# EAGLE schematic mainboard_10_1_Feb_2022,_200341 (EAGLE 9.6.2)
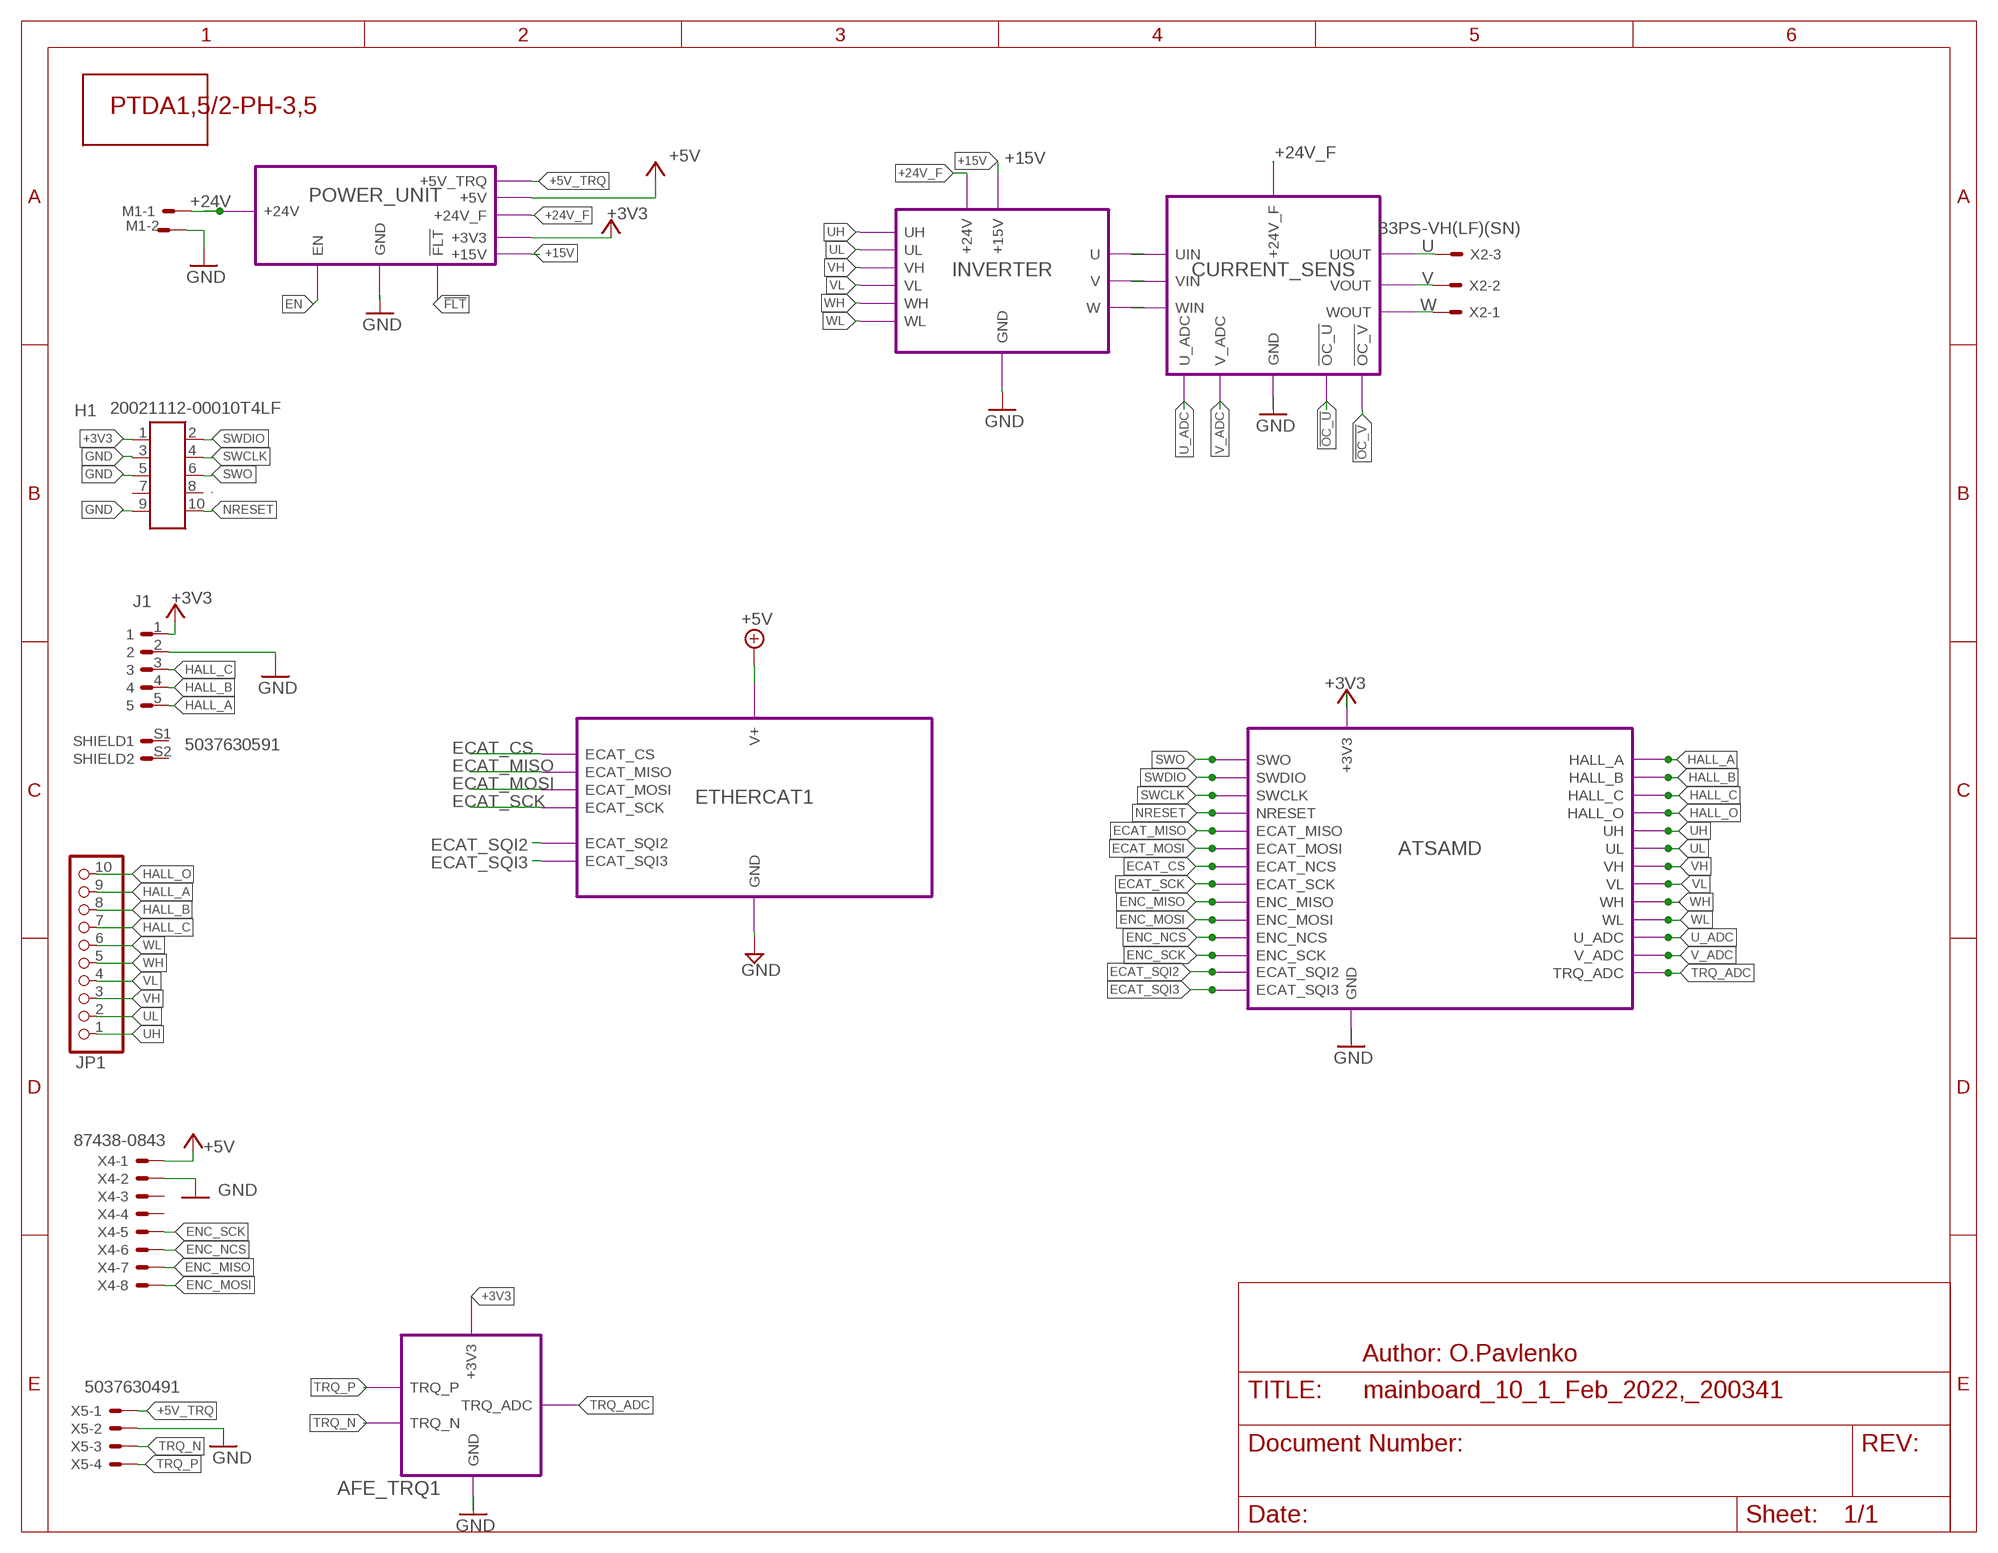
[diagram p0: schematic, sheet 1]

## Parts
H1  20021112-00010T4LF  [20021112-00010]
J1  5037630591  [MOLEX_5037630591]
JP1  PINHD-1X10  [1X10]
M1  PST1,3/2-3,5  [1945096]
U$1  PTDA1,5/2-PH-3,5  [1725107]
X2  B3PS-VH(LF)(SN)  [B3PS-VH(LF)(SN)]
X4  87438-0843  [87438-08]
X5  5037630491  [5037630491]

## Module instances
POWER_UNIT = POWERUNIT
INVERTER = INVERTER
CURRENT_SENS = CURRENT_MEAS
ATSAMD = ATSAME
AFE_TRQ1 = AFE_TRQ
ETHERCAT1 = ETHERCAT

## Nets
!FLT!: port POWER_UNIT.!FLT!
!OC_U!: port CURRENT_SENS.!OC_U!
!OC_V!: port CURRENT_SENS.!OC_V!
+3V3: H1.1 J1.1 ; port POWER_UNIT.+3V3 ATSAMD.+3V3 AFE_TRQ1.+3V3
+5V: X4.1 ; port POWER_UNIT.+5V ETHERCAT1.V+
+5V_TRQ: X5.1 ; port POWER_UNIT.+5V_TRQ
+15V: port INVERTER.+15V POWER_UNIT.+15V
+24V: M1.1 ; port POWER_UNIT.+24V
+24V_F: port POWER_UNIT.+24V_F INVERTER.+24V CURRENT_SENS.+24V_F
ECAT_CS: port ATSAMD.ECAT_NCS ETHERCAT1.ECAT_CS
ECAT_MISO: port ATSAMD.ECAT_MISO ETHERCAT1.ECAT_MISO
ECAT_MOSI: port ATSAMD.ECAT_MOSI ETHERCAT1.ECAT_MOSI
ECAT_SCK: port ATSAMD.ECAT_SCK ETHERCAT1.ECAT_SCK
ECAT_SQI2: port ATSAMD.ECAT_SQI2 ETHERCAT1.ECAT_SQI2
ECAT_SQI3: port ATSAMD.ECAT_SQI3 ETHERCAT1.ECAT_SQI3
EN: port POWER_UNIT.EN
ENC_MISO: X4.7 ; port ATSAMD.ENC_MISO
ENC_MOSI: X4.8 ; port ATSAMD.ENC_MOSI
ENC_NCS: X4.6 ; port ATSAMD.ENC_NCS
ENC_SCK: X4.5 ; port ATSAMD.ENC_SCK
GND: H1.3 H1.5 H1.9 J1.2 M1.2 X4.2 X5.2 ; port POWER_UNIT.GND INVERTER.GND CURRENT_SENS.GND AFE_TRQ1.GND ATSAMD.GND ETHERCAT1.GND
HALL_A: J1.5 JP1.9 ; port ATSAMD.HALL_A
HALL_B: J1.4 JP1.8 ; port ATSAMD.HALL_B
HALL_C: J1.3 JP1.7 ; port ATSAMD.HALL_C
HALL_O: JP1.10 ; port ATSAMD.HALL_O
N$1: port INVERTER.U CURRENT_SENS.UIN
N$2: port INVERTER.V CURRENT_SENS.VIN
N$3: port INVERTER.W CURRENT_SENS.WIN
NRESET: H1.10 ; port ATSAMD.NRESET
SWCLK: H1.4 ; port ATSAMD.SWCLK
SWDIO: H1.2 ; port ATSAMD.SWDIO
SWO: H1.6 ; port ATSAMD.SWO
TRQ_ADC: port AFE_TRQ1.TRQ_ADC ATSAMD.TRQ_ADC
TRQ_N: X5.3 ; port AFE_TRQ1.TRQ_N
TRQ_P: X5.4 ; port AFE_TRQ1.TRQ_P
U: X2.1 ; port CURRENT_SENS.UOUT
U_ADC: port CURRENT_SENS.U_ADC ATSAMD.U_ADC
UH: JP1.1 ; port INVERTER.UH ATSAMD.UH
UL: JP1.2 ; port INVERTER.UL ATSAMD.UL
V: X2.2 ; port CURRENT_SENS.VOUT
V_ADC: port CURRENT_SENS.V_ADC ATSAMD.V_ADC
VH: JP1.3 ; port INVERTER.VH ATSAMD.VH
VL: JP1.4 ; port INVERTER.VL ATSAMD.VL
W: X2.3 ; port CURRENT_SENS.WOUT
WH: JP1.5 ; port INVERTER.WH ATSAMD.WH
WL: JP1.6 ; port INVERTER.WL ATSAMD.WL
Unconnected: H1.7 H1.8 J1.S1(SHIELD1) J1.S2(SHIELD2) X4.3 X4.4

## Notes on the sheet
- Author: O.Pavlenko

## Library data of the parts
H1 = msrm:20021?10*LF: Connector Header Surface Mount 10 position 0.050" (1.27mm) Variant: 111-000 609-5923-ND ___ Source: Digikey <https://www.digikey.de/products/de?keywords=609-5923-ND> ; Datasheet <https://cdn.amphenol-icc.com/media/wysiwyg/files/drawing/20021111.pdf> 609-3712-ND ___ Source: Digikey <https://www.digikey.de/products/de?keywords=609-3712-ND> ; Datasheet <https://media.digikey.com/pdf/Data%20Sheets/FCI%20PDFs/Minitek%20127_Catalog.pdf> Variant: 112-000 609-5926-ND ___ Source: Digikey <https://www.digikey.de/products/de?keywords=609-5926-ND> ; Datasheet <https://cdn.amphenol-icc.com/media/wysiwyg/files/drawing/20021112.pdf> Variant: 121-000 609-3695-1-ND ___ Source: Digikey <https://www.digikey.de/products/de?keywords=609-3695-1-ND> ; Datasheet <https://cdn.amphenol-icc.com/media/wysiwyg/files/drawing/20021121.pdf> 609-6529-ND ___ Source: Digikey <https://www.digikey.de/products/de?keywords=609-6529-ND> ; Datasheet <https://cdn.amphenol-icc.com/media/wysiwyg/files/drawing/20021121.pdf> 609-3729-ND ___ Source: Digikey <https://www.digikey.de/products/de?keywords=609-3729-ND> ; Datasheet <https://cdn.amphenol-icc.com/media/wysiwyg/files/drawing/20021121.pdf> Variant: 311-000 609-3754-ND ___ Source: Digikey <https://www.digikey.de/products/de?keywords=609-3754-ND> ; Datasheet <https://cdn.amphenol-icc.com/media/wysiwyg/files/drawing/20021311.pdf>; DIGIKEY: 609-5926-ND; PINS: 10
J1 = IMDL_lib:5037630591: Check availability <https://pricing.snapeda.com/parts/5037630591/Molex/view-part?ref=eda>; AVAILABILITY: In Stock; DESCRIPTION: Connector Header Surface Mount, Right Angle 5 position 0.039 (1.00mm); MF: Molex; MP: 5037630591; PACKAGE: None; PRICE: None; PURCHASE-URL: https://pricing.snapeda.com/search/part/5037630591/?ref=eda
JP1 = pinhead:PINHD-1X10: PIN HEADER
M1 = msrm:PST*/2-?: 2 Position Terminal Block Header, Male Pins, Unshrouded 0.138" (3.50mm) Vertical Through Hole 277-1749-ND ___ Source: Digikey <https://www.digikey.de/products/en?keywords=277-1749-ND> ; Datasheet <https://media.digikey.com/pdf/Data%20Sheets/Phoenix%20Contact%20PDFs/Combicon%20Compact%20Series.pdf>; DIGIKEY: 277-1749-ND; PITCH: 3,5
U$1 = msrm:PTDA*/2-PH: 2 Position Terminal Block Plug for Unshrouded Header 0.138" (3.50mm) 45° Free Hanging (In-Line) 277-17182-ND ___ Source: Digikey <https://www.digikey.de/products/en?keywords=277-17182-ND> ; Datasheet <https://media.digikey.com/PDF/Data%20Sheets/Phoenix%20Contact%20PDFs/1725107.pdf>; DIGIKEY: 277-17182-ND
X2 = msrm:B3PS-VH(LF)(SN): Connector Header Through Hole, Right Angle 3 position 0.156" (3.96mm) 455-1649 ___ Source: Digikey <https://www.digikey.de/product-detail/en/jst-sales-america-inc/B3PS-VH-LF-SN/455-1649-ND/926556> ; Datasheet <http://www.jst-mfg.com/product/pdf/eng/eVH.pdf>; DIGIKEY: 455-1649-ND
X4 = msrm:8743?-08*3: Wire-to-Board 1.50mm (.059") Pitch Header - SMT, Shrouded Source: http://www.molex.com/product/micro/87437.html; DIGIKEY: WM7652CT-ND
X5 = msrm:5037630491: Pico-Lock 503763 Connector Header Surface Mount, Right Angle 4 position 0.039" (1.00mm); DIGIKEY: WM10655CT-ND

## Module POWERUNIT
Ports: +24V(pwr) GND(pwr) +5V(pwr) +3V3(pwr) EN(out) !FLT!(out) +24V_F(pwr) +15V(pwr) +5V_TRQ(pwr)
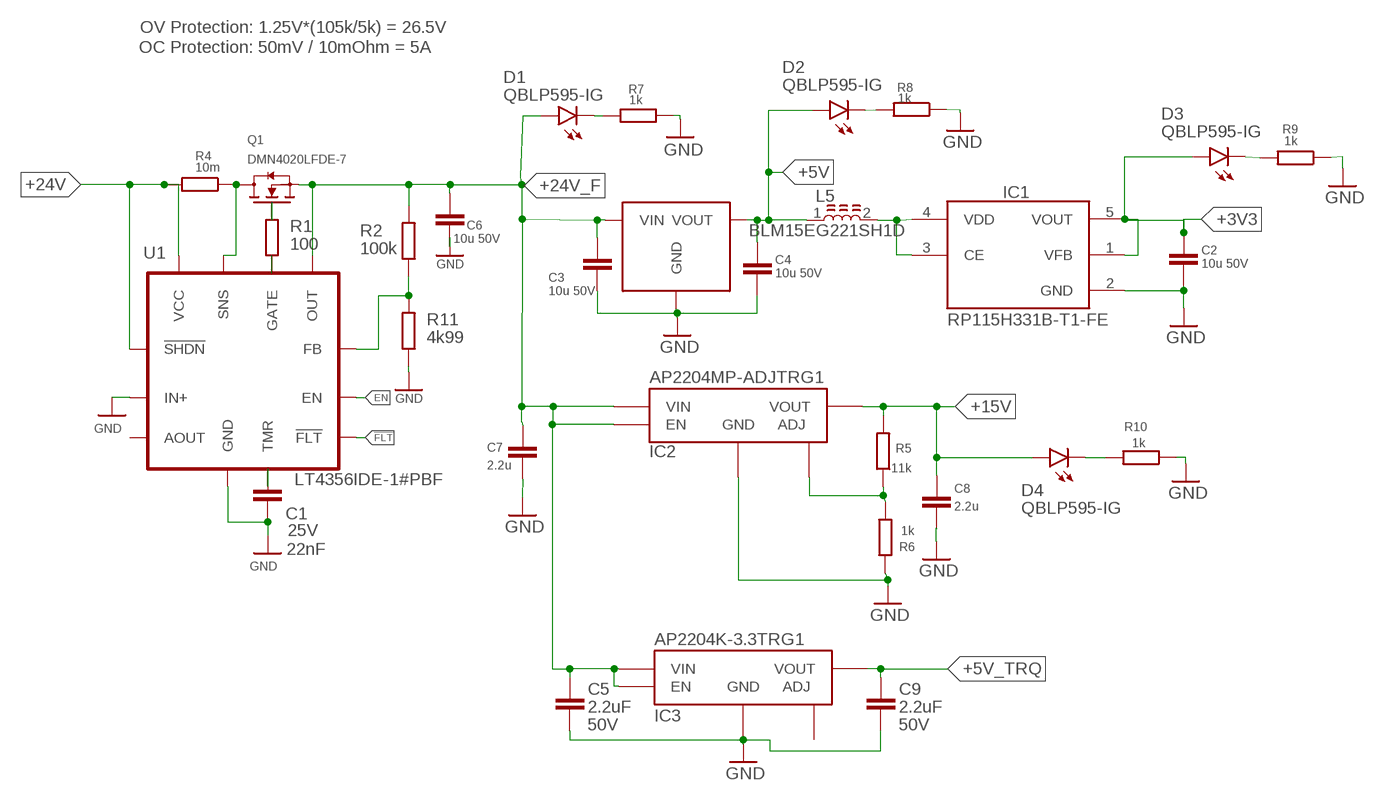
[diagram p1: schematic, module POWERUNIT, sheet 1]

### Parts
C1  GCM155R71E223KA55  [C0402]
C2  10u 50V  C_CHIP-1206(3216-METRIC)  [CAPC3216X135]
C3  10u 50V  C_CHIP-1206(3216-METRIC)  [CAPC3216X135]
C4  10u 50V  C_CHIP-1206(3216-METRIC)  [CAPC3216X135]
C5  GCM31CR71H225KA55  [C1206]
C6  10u 50V  C_CHIP-1206(3216-METRIC)  [CAPC3216X135]
C7  2.2u  C_CHIP-0805(2012-METRIC)  [CAPC2012X110]
C8  2.2u  C_CHIP-0805(2012-METRIC)  [CAPC2012X110]
C9  GCM31CR71H225KA55  [C1206]
D1  QBLP595-IG  [LED0402]
D2  QBLP595-IG  [LED0402]
D3  QBLP595-IG  [LED0402]
D4  QBLP595-IG  [LED0402]
IC1  RP115H331B-T1-FE  [SOT-89-5]
IC2  AP2204MP-ADJTRG1  [SOIC127P600X170-9T271X340N]
IC3  AP2204K-3.3TRG1  [SOT-23-5]
L5  BLM15EG221SH1D  [BEAD0402]
PS2  R78E-1.0-5V  [R78E-1.0]
Q1  DMN4020LFDE-7  [TRANS_DMN4020LFDE-7]
R1  RT0402FRE07100RL  [R0402]
R2  RT0402FRE07100KL  [R0402]
R4  10m  R-EU_R1210  [R1210]
R5  11k  RT0402BRD0712KL  [R0402]
R6  1k  RT0402BRD071KL  [R0402]
R7  1k  RT0402BRD071KL  [R0402]
R8  1k  RT0402BRD071KL  [R0402]
R9  1k  RT0402BRD071KL  [R0402]
R10  1k  RT0402BRD071KL  [R0402]
R11  RT0402BRD074K99L  [R0402]
U1  LT4356-1LINEAR_TECHNOLOGY_LT4356IDE-1#PBF_0_0  [LINEAR_TECHNOLOGY_LT4356IDE-1#PBF_0]

### Nets
!FLT!: U1.8(!FLT!)
+3V3 [power]: C2.1 D3.2(A) IC1.1(VFB) IC1.5(VOUT)
+5V [power]: C4.1 D2.2(A) L5.1 PS2.3(VOUT)
+5V_TRQ: C9.1 IC3.5(VOUT)
+15V: C8.1 D4.2(A) IC2.1(VOUT) R5.2
+24V [power]: R4.2 U1.6(VCC) U1.7(!SHDN!)
+24V_F: C3.1 C5.1 C6.1 C7.1 D1.2(A) IC2.5(EN) IC2.8(VIN) IC3.1(VIN) IC3.3(EN) PS2.1(VIN) Q1.4_1(S) Q1.4_2(S) R2.2 U1.3(OUT)
EN: U1.9(EN)
GND [power]: C1.2 C2.2 C3.2 C4.2 C5.2 C6.2 C7.2 C8.2 C9.2 IC1.2(GND) IC2.7(GND) IC2.9(GND) IC3.2(GND) PS2.2(GND) R6.1 R7.1 R8.1 R9.1 R10.1 R11.1 U1.10(GND) U1.12(IN+)
N$1: Q1.3(G) R1.2
N$2: R1.1 U1.4(GATE)
N$3: Q1.1(D) Q1.2(D) Q1.5(D) Q1.6(D) R4.1 U1.5(SNS)
N$4: R2.1 R11.2 U1.2(FB)
N$6: D1.1(C) R7.2
N$7: IC2.4(ADJ) R5.1 R6.2
N$8: C1.1 U1.1(TMR)
N$9: D2.1(C) R8.2
N$10: D3.1(C) R9.2
N$11: D4.1(C) R10.2
N$12 [power]: IC1.3(CE) IC1.4(VDD) L5.2
Unconnected: IC3.4(ADJ) U1.11(AOUT) U1.13(PA)

### Notes on the sheet
- OV Protection: 1.25V*(105k/5k) = 26.5V
- OC Protection: 50mV / 10mOhm = 5A

### Library data of the parts
C1 = msrm:GCM?R7*: Multilayer Ceramic Capacitors Chip Multilayer Ceramic Capacitors for Automotive –55 to 125°C Sources: Catalogue <https://www.murata.com/~/media/webrenewal/support/library/catalog/products/capacitor/mlcc/c03e.ashx?la=en-us> Part Numbering <https://search.murata.co.jp/Ceramy/image/img/A01X/partnumbering_e_02.pdf> package: C0201 : 470pF ___ Source: Digikey <https://www.digikey.de/products/en?keywords=490-17744-1-ND> ; Datasheet <https://search.murata.co.jp/Ceramy/image/img/A01X/G101/ENG/GCM033R71E471KA03-01.pdf> package: C0402 : 100nF ___ Source: Digikey <https://www.digikey.de/products/en?keywords=490-16433-1-ND> ; Datasheet <https://search.murata.co.jp/Ceramy/image/img/A01X/G101/ENG/GCM155R71C104JA55-01.pdf> 220nF ___ Source: Digikey <https://www.digikey.de/products/en?keywords=490-10671-1-ND> ; Datasheet <https://www.murata.com/-/media/webrenewal/support/library/catalog/products/capacitor/ceramiccapacitor/c03e.ashx?la=en-us&cvid=20200707014404000000> 6.8nF ___ Source: Digikey <https://www.digikey.de/products/en?keywords=490-12655-1-ND> ; Datasheet <https://search.murata.co.jp/Ceramy/image/img/A01X/G101/ENG/GCM155R71C683KA55-01.pdf> 10nF ___ Source: Digikey <https://www.digikey.de/products/en?keywords=490-6043-1-ND> ; Datasheet <https://search.murata.co.jp/Ceramy/image/img/A01X/G101/ENG/GCM155R71E103KA37-01.pdf> 22nF ___ Source: Digikey <https://www.digikey.de/products/en?keywords=490-6044-1-ND> ; Datasheet <https://search.murata.co.jp/Ceramy/image/img/A01X/G101/ENG/GCM155R71E223KA55-01.pdf> 470pF ___ Source: Digikey <https://www.digikey.de/products/en?keywords=490-4913-1-ND> ; Datasheet <https://search.murata.co.jp/Ceramy/image/img/A01X/G101/ENG/GCM155R71H471KA37-01.pdf> package: C0603 : 1µF ___ Source: Digikey <https://www.digikey.de/products/en?keywords=490-5241-1-ND> ; Datasheet <https://www.murata.com/-/media/webrenewal/support/library/catalog/products/capacitor/ceramiccapacitor/c03e.ashx?la=en-us&cvid=20200707014404000000> 470nF ___ Source: Digikey <https://www.digikey.de/products/en?keywords=490-12589-1-ND> ; Datasheet <https://search.murata.co.jp/Ceramy/image/img/A01X/G101/ENG/GCM188R71C474KA55-01.pdf> 10nF ___ Source: Digikey <https://www.digikey.de/products/en?keywords=490-4781-1-ND> ; Datasheet <https://search.murata.co.jp/Ceramy/image/img/A01X/G101/ENG/GCM188R72A103KA37-01.pdf> 22nF ___ Source: Digikey <https://www.digikey.de/products/en?keywords=490-4782-1-ND> ; Datasheet <https://www.murata.com/-/media/webrenewal/support/library/catalog/products/capacitor/ceramiccapacitor/c03e.ashx?la=en-us&cvid=20200707014404000000> package: C0805 : 10µF ___ Source: Digikey <https://www.digikey.de/products/en?keywords=490-14361-1-ND> ; Datasheet <https://search.murata.co.jp/Ceramy/image/img/A01X/G101/ENG/GCM21BR70J106KE22-01.pdf> 2.2µF ___ Source: Digikey <https://www.digikey.de/products/en?keywords=490-4786-1-ND> ; Datasheet <https://search.murata.co.jp/Ceramy/image/img/A01X/G101/ENG/GCM21BR71C225KA64-01.pdf> 470nF ___ Source: Digikey <https://www.digikey.de/products/en?keywords=490-4788-1-ND> ; Datasheet <https://search.murata.co.jp/Ceramy/image/img/A01X/G101/ENG/GCM21BR71H474KA55-01.pdf> 100nF ___ Source: Digikey <https://www.digikey.de/products/en?keywords=490-8051-1-ND> ; Datasheet <https://search.murata.co.jp/Ceramy/image/img/A01X/G101/ENG/GCM21BR72A104KA37-01.pdf> package: C0805K : 220nF ___ Source: Digikey <https://www.digikey.de/products/en?keywords=490-8306-1-ND> ; Datasheet <https://search.murata.co.jp/Ceramy/image/img/A01X/G101/ENG/GRM21AR72A224KAC5-01.pdf> package: C1206 : 10µF ___ Source: Digikey <https://www.digikey.de/products/en?keywords=490-14746-1-ND> ; Datasheet <https://search.murata.co.jp/Ceramy/image/img/A01X/G101/ENG/GCM31CR71C106KA64-01.pdf> 2.2µF ___ Source: Digikey <https://www.digikey.de/products/en?keywords=490-11169-1-ND> ; Datasheet <https://search.murata.co.jp/Ceramy/image/img/A01X/G101/ENG/GCM31CR71H225KA55-01.pdf> package: C1206 : 2220nF ___ Source: Digikey <https://www.digikey.de/products/en?keywords=490-4975-1-ND> ; Datasheet <https://search.murata.co.jp/Ceramy/image/img/A01X/G101/ENG/GCM31MR72A224KA37-01.pdf>; CAPACITANCE: 22nF; DIGIKEY: 490-6044-1-ND; TOLERANCE: ±10%; VOLTAGE: 25V
C2-C4 = IMDL_lib:C: Capacitor - Generic; CATEGORY: Capacitor
C5 C9 = msrm:GCM?R7*: Multilayer Ceramic Capacitors Chip Multilayer Ceramic Capacitors for Automotive –55 to 125°C Sources: Catalogue <https://www.murata.com/~/media/webrenewal/support/library/catalog/products/capacitor/mlcc/c03e.ashx?la=en-us> Part Numbering <https://search.murata.co.jp/Ceramy/image/img/A01X/partnumbering_e_02.pdf> package: C0201 : 470pF ___ Source: Digikey <https://www.digikey.de/products/en?keywords=490-17744-1-ND> ; Datasheet <https://search.murata.co.jp/Ceramy/image/img/A01X/G101/ENG/GCM033R71E471KA03-01.pdf> package: C0402 : 100nF ___ Source: Digikey <https://www.digikey.de/products/en?keywords=490-16433-1-ND> ; Datasheet <https://search.murata.co.jp/Ceramy/image/img/A01X/G101/ENG/GCM155R71C104JA55-01.pdf> 220nF ___ Source: Digikey <https://www.digikey.de/products/en?keywords=490-10671-1-ND> ; Datasheet <https://www.murata.com/-/media/webrenewal/support/library/catalog/products/capacitor/ceramiccapacitor/c03e.ashx?la=en-us&cvid=20200707014404000000> 6.8nF ___ Source: Digikey <https://www.digikey.de/products/en?keywords=490-12655-1-ND> ; Datasheet <https://search.murata.co.jp/Ceramy/image/img/A01X/G101/ENG/GCM155R71C683KA55-01.pdf> 10nF ___ Source: Digikey <https://www.digikey.de/products/en?keywords=490-6043-1-ND> ; Datasheet <https://search.murata.co.jp/Ceramy/image/img/A01X/G101/ENG/GCM155R71E103KA37-01.pdf> 22nF ___ Source: Digikey <https://www.digikey.de/products/en?keywords=490-6044-1-ND> ; Datasheet <https://search.murata.co.jp/Ceramy/image/img/A01X/G101/ENG/GCM155R71E223KA55-01.pdf> 470pF ___ Source: Digikey <https://www.digikey.de/products/en?keywords=490-4913-1-ND> ; Datasheet <https://search.murata.co.jp/Ceramy/image/img/A01X/G101/ENG/GCM155R71H471KA37-01.pdf> package: C0603 : 1µF ___ Source: Digikey <https://www.digikey.de/products/en?keywords=490-5241-1-ND> ; Datasheet <https://www.murata.com/-/media/webrenewal/support/library/catalog/products/capacitor/ceramiccapacitor/c03e.ashx?la=en-us&cvid=20200707014404000000> 470nF ___ Source: Digikey <https://www.digikey.de/products/en?keywords=490-12589-1-ND> ; Datasheet <https://search.murata.co.jp/Ceramy/image/img/A01X/G101/ENG/GCM188R71C474KA55-01.pdf> 10nF ___ Source: Digikey <https://www.digikey.de/products/en?keywords=490-4781-1-ND> ; Datasheet <https://search.murata.co.jp/Ceramy/image/img/A01X/G101/ENG/GCM188R72A103KA37-01.pdf> 22nF ___ Source: Digikey <https://www.digikey.de/products/en?keywords=490-4782-1-ND> ; Datasheet <https://www.murata.com/-/media/webrenewal/support/library/catalog/products/capacitor/ceramiccapacitor/c03e.ashx?la=en-us&cvid=20200707014404000000> package: C0805 : 10µF ___ Source: Digikey <https://www.digikey.de/products/en?keywords=490-14361-1-ND> ; Datasheet <https://search.murata.co.jp/Ceramy/image/img/A01X/G101/ENG/GCM21BR70J106KE22-01.pdf> 2.2µF ___ Source: Digikey <https://www.digikey.de/products/en?keywords=490-4786-1-ND> ; Datasheet <https://search.murata.co.jp/Ceramy/image/img/A01X/G101/ENG/GCM21BR71C225KA64-01.pdf> 470nF ___ Source: Digikey <https://www.digikey.de/products/en?keywords=490-4788-1-ND> ; Datasheet <https://search.murata.co.jp/Ceramy/image/img/A01X/G101/ENG/GCM21BR71H474KA55-01.pdf> 100nF ___ Source: Digikey <https://www.digikey.de/products/en?keywords=490-8051-1-ND> ; Datasheet <https://search.murata.co.jp/Ceramy/image/img/A01X/G101/ENG/GCM21BR72A104KA37-01.pdf> package: C0805K : 220nF ___ Source: Digikey <https://www.digikey.de/products/en?keywords=490-8306-1-ND> ; Datasheet <https://search.murata.co.jp/Ceramy/image/img/A01X/G101/ENG/GRM21AR72A224KAC5-01.pdf> package: C1206 : 10µF ___ Source: Digikey <https://www.digikey.de/products/en?keywords=490-14746-1-ND> ; Datasheet <https://search.murata.co.jp/Ceramy/image/img/A01X/G101/ENG/GCM31CR71C106KA64-01.pdf> 2.2µF ___ Source: Digikey <https://www.digikey.de/products/en?keywords=490-11169-1-ND> ; Datasheet <https://search.murata.co.jp/Ceramy/image/img/A01X/G101/ENG/GCM31CR71H225KA55-01.pdf> package: C1206 : 2220nF ___ Source: Digikey <https://www.digikey.de/products/en?keywords=490-4975-1-ND> ; Datasheet <https://search.murata.co.jp/Ceramy/image/img/A01X/G101/ENG/GCM31MR72A224KA37-01.pdf>; CAPACITANCE: 2.2uF; DIGIKEY: 490-11169-1-ND; TOLERANCE: ±10%; VOLTAGE: 50V
C6-C8 = Capacitor:C: Capacitor - Generic; CATEGORY: Capacitor
D1-D4 = msrm:QBLP595-: LED 0402 SMD, 2V package: 0402 : Yellow-Green ___ Source: Digikey <https://www.digikey.de/product-detail/en/qt-brightek-qtb/QBLP595-AG/1516-1218-1-ND/6201915> ; Datasheet <http://www.qt-brightek.com/datasheet/QBLP595%20Series.pdf> Blue ___ Source: Digikey <https://www.digikey.de/product-detail/en/qt-brightek-qtb/QBLP595-IB/1516-1215-1-ND/6201912> ; Datasheet <http://www.qt-brightek.com/datasheet/QBLP595%20Series.pdf> Green ___ Source: Digikey <https://www.digikey.de/product-detail/en/qt-brightek-qtb/QBLP595-IG/1516-1216-1-ND/6201913> ; Datasheet <http://www.qt-brightek.com/datasheet/QBLP595%20Series.pdf> Orange ___ Source: Digikey <https://www.digikey.de/product-detail/en/qt-brightek-qtb/QBLP595-O/1516-1220-1-ND/6201917> ; Datasheet <http://www.qt-brightek.com/datasheet/QBLP595%20Series.pdf> Red ___ Source: Digikey <https://www.digikey.de/product-detail/en/qt-brightek-qtb/QBLP595-R/1516-1217-1-ND/6201914> ; Datasheet <http://www.qt-brightek.com/datasheet/QBLP595%20Series.pdf> Yellow ___ Source: Digikey <https://www.digikey.de/product-detail/en/qt-brightek-qtb/QBLP595-Y/1516-1219-1-ND/6201916> ; Datasheet <http://www.qt-brightek.com/datasheet/QBLP595%20Series.pdf>; COLOR: Green; DIGIKEY: 1516-1216-1-ND
IC1 = msrm:RP115H*-T1-FE: Linear Voltage Regulator IC 1 Output 1A SOT-89-5 package: SOT-89-5 : H331B ___ Source: Digikey <https://www.digikey.de/products/en?keywords=RP115H331B-T1-FE> ; Datasheet <https://www.n-redc.co.jp/en/pdf/datasheet/rp115-ea.pdf> H331D ___ Source: Digikey <https://www.digikey.de/product-detail/en/ricoh-electronic-devices-co-ltd/RP115H331D-T1-FE/2129-RP115H331D-T1-FECT-ND/11569386> ; Datasheet <https://www.n-redc.co.jp/en/pdf/datasheet/rp115-ea.pdf>; DIGIKEY: RP115H331B-T1-FE-ND; VOLTAGE: 3.3V
IC2 = msrm:AP2204?-*TRG1: Linear Voltage Regulator IC 1 Output 150mA SOT-23-5 package: SOIC : APM2204MP-ADJTRG1DICT-ND ___ Source: Digikey <https://www.digikey.de/products/de?keywords=AP2204MP-ADJTRG1DICT-ND> ; Datasheet <https://media.digikey.com/pdf/Data%20Sheets/Diodes%20PDFs/AP2204_Jan2020.pdf> package: SOT-23-5 : 1.5TRG1 ___ Source: Digikey <https://www.digikey.de/product-detail/en/diodes-incorporated/AP2204K-1-5TRG1/AP2204K-1-5TRG1-ND/5305710?cur=EUR&lang=en> ; Datasheet <https://media.digikey.com/pdf/Data%20Sheets/Diodes%20PDFs/AP2204_Jan2020.pdf> 1.8TRG1 ___ Source: Digikey <https://www.digikey.de/product-detail/en/diodes-incorporated/AP2204K-1-5TRG1/AP2204K-1-5TRG1-ND/5305710?cur=EUR&lang=en> ; Datasheet <https://media.digikey.com/pdf/Data%20Sheets/Diodes%20PDFs/AP2204_Jan2020.pdf> 2.5TRG1 ___ Source: / 2.8TRG1 ___ Source: / 3.0TRG1 ___ Source: Digikey <https://www.digikey.de/products/de?keywords=AP2204K-3.0TRG1DICT-ND> ; Datasheet <https://media.digikey.com/pdf/Data%20Sheets/Diodes%20PDFs/AP2204_Jan2020.pdf> 3.3TRG1 ___ Source: Digikey <https://www.digikey.de/products/de?keywords=AP2204K-3.3TRG1DICT-ND> ; Datasheet <https://media.digikey.com/pdf/Data%20Sheets/Diodes%20PDFs/AP2204_Jan2020.pdf> 5.0RG1 ___ Source: Digikey <https://www.digikey.de/products/de?keywords=AP2204K-5.0TRG1DICT-ND> ; Datasheet <https://media.digikey.com/pdf/Data%20Sheets/Diodes%20PDFs/AP2204_Jan2020.pdf> ADJTRG1 ___ Source: Digikey <https://www.digikey.de/products/de?keywords=AP2204K-ADJTRG1DICT-ND> ; Datasheet <https://media.digikey.com/pdf/Data%20Sheets/Diodes%20PDFs/AP2204_Jan2020.pdf>; DIGIKEY: AP2204MP-ADJTRG1DICT-ND
IC3 = msrm:AP2204?-*TRG1: Linear Voltage Regulator IC 1 Output 150mA SOT-23-5 package: SOIC : APM2204MP-ADJTRG1DICT-ND ___ Source: Digikey <https://www.digikey.de/products/de?keywords=AP2204MP-ADJTRG1DICT-ND> ; Datasheet <https://media.digikey.com/pdf/Data%20Sheets/Diodes%20PDFs/AP2204_Jan2020.pdf> package: SOT-23-5 : 1.5TRG1 ___ Source: Digikey <https://www.digikey.de/product-detail/en/diodes-incorporated/AP2204K-1-5TRG1/AP2204K-1-5TRG1-ND/5305710?cur=EUR&lang=en> ; Datasheet <https://media.digikey.com/pdf/Data%20Sheets/Diodes%20PDFs/AP2204_Jan2020.pdf> 1.8TRG1 ___ Source: Digikey <https://www.digikey.de/product-detail/en/diodes-incorporated/AP2204K-1-5TRG1/AP2204K-1-5TRG1-ND/5305710?cur=EUR&lang=en> ; Datasheet <https://media.digikey.com/pdf/Data%20Sheets/Diodes%20PDFs/AP2204_Jan2020.pdf> 2.5TRG1 ___ Source: / 2.8TRG1 ___ Source: / 3.0TRG1 ___ Source: Digikey <https://www.digikey.de/products/de?keywords=AP2204K-3.0TRG1DICT-ND> ; Datasheet <https://media.digikey.com/pdf/Data%20Sheets/Diodes%20PDFs/AP2204_Jan2020.pdf> 3.3TRG1 ___ Source: Digikey <https://www.digikey.de/products/de?keywords=AP2204K-3.3TRG1DICT-ND> ; Datasheet <https://media.digikey.com/pdf/Data%20Sheets/Diodes%20PDFs/AP2204_Jan2020.pdf> 5.0RG1 ___ Source: Digikey <https://www.digikey.de/products/de?keywords=AP2204K-5.0TRG1DICT-ND> ; Datasheet <https://media.digikey.com/pdf/Data%20Sheets/Diodes%20PDFs/AP2204_Jan2020.pdf> ADJTRG1 ___ Source: Digikey <https://www.digikey.de/products/de?keywords=AP2204K-ADJTRG1DICT-ND> ; Datasheet <https://media.digikey.com/pdf/Data%20Sheets/Diodes%20PDFs/AP2204_Jan2020.pdf>; DIGIKEY: AP2204K-3.3TRG1DICT-ND
L5 = msrm:BLM?EG*1D: Murata's SMD Ferrite Bead BLM18EG Series Productdata: Part Numbering <https://www.murata.com/en-us/products/productdata/8796733767710/S0580E.pdf> package: 0402 : 220 Ohms @ 100MHz ___ Source: Digikey <https://www.digikey.de/products/en?keywords=490-17345-1-ND> ; Datasheet <https://www.murata.com/en-us/products/productdata/8799741607966/QNFA9136.pdf> package: 0603 : 100 Ohms @ 100MHz ___ Source: Digikey <https://www.digikey.de/products/en?keywords=490-5978-1-ND> ; Datasheet <https://www.murata.com/en-us/products/productdata/8796747366430/ENFA0021.pdf> 120 Ohms @ 100MHz___ Source: Digikey <https://www.digikey.de/products/en?keywords=490-3991-1-ND> ; Datasheet <https://www.murata.com/en-us/products/productdata/8796747366430/ENFA0021.pdf> 220 Ohms @ 100MHz ___ Source: Digikey <https://www.digikey.de/products/en?keywords=490-3992-6-ND> ; Datasheet <https://www.murata.com/en-us/products/productdata/8796747366430/ENFA0021.pdf> 220 Ohms @ 100MHz ___ Source: Digikey <https://www.digikey.de/products/en?keywords=490-5979-1-ND> ; Datasheet <https://www.murata.com/en-us/products/productdata/8796747366430/ENFA0021.pdf> 330 Ohms @ 100MHz ___ Source: Digikey <https://www.digikey.de/products/en?keywords=490-5913-1-ND> ; Datasheet <https://www.murata.com/en-us/products/productdata/8796747366430/ENFA0021.pdf> 390 Ohms @ 100MHz ___ Source: Digikey <https://www.digikey.de/products/en?keywords=490-5980-2-ND> ; Datasheet <https://www.murata.com/en-us/products/productdata/8796747366430/ENFA0021.pdf> 470 Ohms @ 100MHz ___ Source: Digikey <https://www.digikey.de/products/en?keywords=490-3993-1-ND> ; Datasheet <https://www.murata.com/en-us/products/productdata/8796747366430/ENFA0021.pdf> 600 Ohms @ 100MHz ___ Source: Digikey <https://www.digikey.de/products/en?keywords=490-3994-1-ND> ; Datasheet <https://www.murata.com/en-us/products/productdata/8796747366430/ENFA0021.pdf>; DC_RES: 280mOhm; DIGIKEY: 490-17345-1-ND; IMPEDANCE-FREQUENCY: 220 Ohms @ 100MHz
PS2 = IMDL_lib:R78E-1.0
Q1 = TRANS_DMN4020LFDE:DMN4020LFDE-7
R1 = msrm:RT?FRE07*L: SMD RESISTOR ± 1% Tol, Paper/PE taping reel, 50 ppm/°C, 7 inch dia. Reel Datasheet <http://www.yageo.com/documents/recent/PYu-RT_1-to-0.01_RoHS_L_11.pdf> package: 0201 : 0R ___ Source: Digikey <https://www.digikey.de/products/en?keywords=311-0.0MCT-ND> 1k ___ Source: Digikey <https://www.digikey.de/products/en?keywords=RT0201FRE071KL-ND> 10k ___ Source: Digikey <https://www.digikey.de/products/en?keywords=RT0201FRE0710KL-ND> 100 ___ Source: Digikey <https://www.digikey.de/products/en?keywords=RT0201FRE07100RL-ND> 330 ___ Source: Digikey <https://www.digikey.de/products/en?keywords=RT0201FRE07330RL-ND> package: 0402 : 0R ___ Source: Digikey <https://www.digikey.de/products/en?keywords=311-0.0LRCT-ND> 1k ___ Source: Digikey <https://www.digikey.de/products/en?keywords=%20YAG1234CT-ND> 2k2 ___ Source: Digikey <https://www.digikey.de/products/en?keywords=RT0402FRE072K2L-ND> 2k ___ Source: Digikey <https://www.digikey.de/products/en?keywords=YAG3345CT-ND> 4k7 ___ Source: Digikey <https://www.digikey.de/products/en?keywords=YAG3347CT-ND%20> 10k ___ Source: Digikey <https://www.digikey.de/products/en?keywords=YAG1233CT-ND> 12k1 ___ Source: Digikey <https://www.digikey.de/products/en?keywords=RT0402FRE0712K1L-ND> 49R9 ___ Source: Digikey <https://www.digikey.de/products/en?keywords=YAG3346CT-ND> 56k ___ Source: Digikey <https://www.digikey.de/products/en?keywords=RT0402FRE0756K2L-ND> 100k ___ Source: Digikey <https://www.digikey.de/products/en?keywords=YAG2307CT-ND> 100 ___ Source: Digikey <https://www.digikey.de/products/en?keywords=YAG3342CT-ND> 150 ___ Source: Digikey <https://www.digikey.de/product-detail/en/yageo/RT0402FRE07150RL/13-RT0402FRE07150RLCT-ND/12705162> 300 ___ Source: Digikey <https://www.digikey.de/products/en?keywords=RT0402FRE07300RL-ND> package: 0603 : 0R ___ Source: Digikey <https://www.digikey.de/products/en?keywords=311-0.0HRCT-ND> 1k ___ Source: Digikey <https://www.digikey.de/products/en?keywords=YAG2323CT-ND> 10k ___ Source: Digikey <https://www.digikey.de/products/en?keywords=YAG2321CT-ND> 100k ___ Source: Digikey <https://www.digikey.de/products/en?keywords=YAG2319CT-ND> 100 ___ Source: Digikey <https://www.digikey.de/products/en?keywords=YAG2320CT-ND> 300 ___ Source: Digikey <https://www.digikey.de/products/en?keywords=RT0603FRE07300RL-ND> 330 ___ Source: Digikey <https://www.digikey.de/products/en?keywords=YAG5957CT-ND>; DIGIKEY: YAG3342CT-ND; RVALUE: 100; SPICEPREFIX: R
R2 = msrm:RT?FRE07*L: SMD RESISTOR ± 1% Tol, Paper/PE taping reel, 50 ppm/°C, 7 inch dia. Reel Datasheet <http://www.yageo.com/documents/recent/PYu-RT_1-to-0.01_RoHS_L_11.pdf> package: 0201 : 0R ___ Source: Digikey <https://www.digikey.de/products/en?keywords=311-0.0MCT-ND> 1k ___ Source: Digikey <https://www.digikey.de/products/en?keywords=RT0201FRE071KL-ND> 10k ___ Source: Digikey <https://www.digikey.de/products/en?keywords=RT0201FRE0710KL-ND> 100 ___ Source: Digikey <https://www.digikey.de/products/en?keywords=RT0201FRE07100RL-ND> 330 ___ Source: Digikey <https://www.digikey.de/products/en?keywords=RT0201FRE07330RL-ND> package: 0402 : 0R ___ Source: Digikey <https://www.digikey.de/products/en?keywords=311-0.0LRCT-ND> 1k ___ Source: Digikey <https://www.digikey.de/products/en?keywords=%20YAG1234CT-ND> 2k2 ___ Source: Digikey <https://www.digikey.de/products/en?keywords=RT0402FRE072K2L-ND> 2k ___ Source: Digikey <https://www.digikey.de/products/en?keywords=YAG3345CT-ND> 4k7 ___ Source: Digikey <https://www.digikey.de/products/en?keywords=YAG3347CT-ND%20> 10k ___ Source: Digikey <https://www.digikey.de/products/en?keywords=YAG1233CT-ND> 12k1 ___ Source: Digikey <https://www.digikey.de/products/en?keywords=RT0402FRE0712K1L-ND> 49R9 ___ Source: Digikey <https://www.digikey.de/products/en?keywords=YAG3346CT-ND> 56k ___ Source: Digikey <https://www.digikey.de/products/en?keywords=RT0402FRE0756K2L-ND> 100k ___ Source: Digikey <https://www.digikey.de/products/en?keywords=YAG2307CT-ND> 100 ___ Source: Digikey <https://www.digikey.de/products/en?keywords=YAG3342CT-ND> 150 ___ Source: Digikey <https://www.digikey.de/product-detail/en/yageo/RT0402FRE07150RL/13-RT0402FRE07150RLCT-ND/12705162> 300 ___ Source: Digikey <https://www.digikey.de/products/en?keywords=RT0402FRE07300RL-ND> package: 0603 : 0R ___ Source: Digikey <https://www.digikey.de/products/en?keywords=311-0.0HRCT-ND> 1k ___ Source: Digikey <https://www.digikey.de/products/en?keywords=YAG2323CT-ND> 10k ___ Source: Digikey <https://www.digikey.de/products/en?keywords=YAG2321CT-ND> 100k ___ Source: Digikey <https://www.digikey.de/products/en?keywords=YAG2319CT-ND> 100 ___ Source: Digikey <https://www.digikey.de/products/en?keywords=YAG2320CT-ND> 300 ___ Source: Digikey <https://www.digikey.de/products/en?keywords=RT0603FRE07300RL-ND> 330 ___ Source: Digikey <https://www.digikey.de/products/en?keywords=YAG5957CT-ND>; DIGIKEY: YAG2307CT-ND; RVALUE: 100k; SPICEPREFIX: R
R4 = resistor:R-EU_: RESISTOR, European symbol
R5 = msrm:RT?BRD07*L: SMD-Resistor ±0.1% 0.063W, 1/16W Chip Resistor 0402 (1005 Metric) Thin Film package: R0402 : 1k ___ Source: Digikey <https://www.digikey.de/products/en?keywords=%20YAG1386CT-ND> ; Datasheet <https://www.yageo.com/upload/media/product/productsearch/datasheet/rchip/PYu-RT_1-to-0.01_RoHS_L_12.pdf> 2k05 ___ Source: Digikey <https://www.digikey.de/products/en?keywords=YAG1400CT-ND> ; Datasheet <https://www.yageo.com/upload/media/product/productsearch/datasheet/rchip/PYu-RT_1-to-0.01_RoHS_L_12.pdf> 3k2 ___ Source: Digikey <YAG4255CT-ND> ; Datasheet <https://www.yageo.com/upload/media/product/productsearch/datasheet/rchip/PYu-RT_1-to-0.01_RoHS_L_12.pdf> 4k99 ___ Source: Digikey <https://www.digikey.de/products/en?keywords=YAG1447CT-ND> ; Datasheet <https://www.yageo.com/upload/media/product/productsearch/datasheet/rchip/PYu-RT_1-to-0.01_RoHS_L_12.pdf> 10k ___ Source: Digikey <https://www.digikey.de/products/en?keywords=%E2%80%8EA119918CT-ND%E2%80%8E> ; Datasheet <https://www.yageo.com/upload/media/product/productsearch/datasheet/rchip/PYu-RT_1-to-0.01_RoHS_L_12.pdf> 12k ___ Source: Digikey <https://www.digikey.de/products/en?keywords=YAG1354CT-ND> ; Datasheet <https://www.yageo.com/upload/media/product/productsearch/datasheet/rchip/PYu-RT_1-to-0.01_RoHS_L_12.pdf> 22k ___ Source: Digikey <https://www.digikey.de/products/en?keywords=YAG4210CT-ND> ; Datasheet <https://www.yageo.com/upload/media/product/productsearch/datasheet/rchip/PYu-RT_1-to-0.01_RoHS_L_12.pdf> 56k ___ Source: Digikey <https://www.digikey.de/products/en?keywords=YAG1454CT-ND%20> ; Datasheet <https://www.yageo.com/upload/media/product/productsearch/datasheet/rchip/PYu-RT_1-to-0.01_RoHS_L_12.pdf> 60k4 ___ Source: Digikey <https://www.digikey.de/products/en?keywords=YAG1461CT-ND> ; Datasheet <https://www.yageo.com/upload/media/product/productsearch/datasheet/rchip/PYu-RT_1-to-0.01_RoHS_L_12.pdf> 270R ___ Source: Digikey <https://www.digikey.de/products/en?keywords=YAG1396CT-ND> ; Datasheet <https://www.yageo.com/upload/media/product/productsearch/datasheet/rchip/PYu-RT_1-to-0.01_RoHS_L_12.pdf>; DIGIKEY: YAG1354CT-ND; RVALUE: 12k; SPICEPREFIX: R
R6-R10 = msrm:RT?BRD07*L: SMD-Resistor ±0.1% 0.063W, 1/16W Chip Resistor 0402 (1005 Metric) Thin Film package: R0402 : 1k ___ Source: Digikey <https://www.digikey.de/products/en?keywords=%20YAG1386CT-ND> ; Datasheet <https://www.yageo.com/upload/media/product/productsearch/datasheet/rchip/PYu-RT_1-to-0.01_RoHS_L_12.pdf> 2k05 ___ Source: Digikey <https://www.digikey.de/products/en?keywords=YAG1400CT-ND> ; Datasheet <https://www.yageo.com/upload/media/product/productsearch/datasheet/rchip/PYu-RT_1-to-0.01_RoHS_L_12.pdf> 3k2 ___ Source: Digikey <YAG4255CT-ND> ; Datasheet <https://www.yageo.com/upload/media/product/productsearch/datasheet/rchip/PYu-RT_1-to-0.01_RoHS_L_12.pdf> 4k99 ___ Source: Digikey <https://www.digikey.de/products/en?keywords=YAG1447CT-ND> ; Datasheet <https://www.yageo.com/upload/media/product/productsearch/datasheet/rchip/PYu-RT_1-to-0.01_RoHS_L_12.pdf> 10k ___ Source: Digikey <https://www.digikey.de/products/en?keywords=%E2%80%8EA119918CT-ND%E2%80%8E> ; Datasheet <https://www.yageo.com/upload/media/product/productsearch/datasheet/rchip/PYu-RT_1-to-0.01_RoHS_L_12.pdf> 12k ___ Source: Digikey <https://www.digikey.de/products/en?keywords=YAG1354CT-ND> ; Datasheet <https://www.yageo.com/upload/media/product/productsearch/datasheet/rchip/PYu-RT_1-to-0.01_RoHS_L_12.pdf> 22k ___ Source: Digikey <https://www.digikey.de/products/en?keywords=YAG4210CT-ND> ; Datasheet <https://www.yageo.com/upload/media/product/productsearch/datasheet/rchip/PYu-RT_1-to-0.01_RoHS_L_12.pdf> 56k ___ Source: Digikey <https://www.digikey.de/products/en?keywords=YAG1454CT-ND%20> ; Datasheet <https://www.yageo.com/upload/media/product/productsearch/datasheet/rchip/PYu-RT_1-to-0.01_RoHS_L_12.pdf> 60k4 ___ Source: Digikey <https://www.digikey.de/products/en?keywords=YAG1461CT-ND> ; Datasheet <https://www.yageo.com/upload/media/product/productsearch/datasheet/rchip/PYu-RT_1-to-0.01_RoHS_L_12.pdf> 270R ___ Source: Digikey <https://www.digikey.de/products/en?keywords=YAG1396CT-ND> ; Datasheet <https://www.yageo.com/upload/media/product/productsearch/datasheet/rchip/PYu-RT_1-to-0.01_RoHS_L_12.pdf>; DIGIKEY: YAG1386CT-ND; RVALUE: 1k; SPICEPREFIX: R
R11 = msrm:RT?BRD07*L: SMD-Resistor ±0.1% 0.063W, 1/16W Chip Resistor 0402 (1005 Metric) Thin Film package: R0402 : 1k ___ Source: Digikey <https://www.digikey.de/products/en?keywords=%20YAG1386CT-ND> ; Datasheet <https://www.yageo.com/upload/media/product/productsearch/datasheet/rchip/PYu-RT_1-to-0.01_RoHS_L_12.pdf> 2k05 ___ Source: Digikey <https://www.digikey.de/products/en?keywords=YAG1400CT-ND> ; Datasheet <https://www.yageo.com/upload/media/product/productsearch/datasheet/rchip/PYu-RT_1-to-0.01_RoHS_L_12.pdf> 3k2 ___ Source: Digikey <YAG4255CT-ND> ; Datasheet <https://www.yageo.com/upload/media/product/productsearch/datasheet/rchip/PYu-RT_1-to-0.01_RoHS_L_12.pdf> 4k99 ___ Source: Digikey <https://www.digikey.de/products/en?keywords=YAG1447CT-ND> ; Datasheet <https://www.yageo.com/upload/media/product/productsearch/datasheet/rchip/PYu-RT_1-to-0.01_RoHS_L_12.pdf> 10k ___ Source: Digikey <https://www.digikey.de/products/en?keywords=%E2%80%8EA119918CT-ND%E2%80%8E> ; Datasheet <https://www.yageo.com/upload/media/product/productsearch/datasheet/rchip/PYu-RT_1-to-0.01_RoHS_L_12.pdf> 12k ___ Source: Digikey <https://www.digikey.de/products/en?keywords=YAG1354CT-ND> ; Datasheet <https://www.yageo.com/upload/media/product/productsearch/datasheet/rchip/PYu-RT_1-to-0.01_RoHS_L_12.pdf> 22k ___ Source: Digikey <https://www.digikey.de/products/en?keywords=YAG4210CT-ND> ; Datasheet <https://www.yageo.com/upload/media/product/productsearch/datasheet/rchip/PYu-RT_1-to-0.01_RoHS_L_12.pdf> 56k ___ Source: Digikey <https://www.digikey.de/products/en?keywords=YAG1454CT-ND%20> ; Datasheet <https://www.yageo.com/upload/media/product/productsearch/datasheet/rchip/PYu-RT_1-to-0.01_RoHS_L_12.pdf> 60k4 ___ Source: Digikey <https://www.digikey.de/products/en?keywords=YAG1461CT-ND> ; Datasheet <https://www.yageo.com/upload/media/product/productsearch/datasheet/rchip/PYu-RT_1-to-0.01_RoHS_L_12.pdf> 270R ___ Source: Digikey <https://www.digikey.de/products/en?keywords=YAG1396CT-ND> ; Datasheet <https://www.yageo.com/upload/media/product/productsearch/datasheet/rchip/PYu-RT_1-to-0.01_RoHS_L_12.pdf>; DIGIKEY: YAG1447CT-ND; RVALUE: 4k99; SPICEPREFIX: R
U1 = IMDL_lib:LT4356-1: LT-LT4356-X-DE-UE-12; ACTIVE_LIMITING: yes; CIIVA_IDS: 280364; CIRCUIT_BREAKERS: 1; CIRCUIT_BREAKER_ACCURACY: 10; CIRCUIT_BREAKER_THRESHOLD: 50 mV; CODE__JEDEC: MO-229; COMPONENT_LINK_1_DESCRIPTION: Manufacturer URL; COMPONENT_LINK_1_URL: http://www.linear.com/; COMPONENT_LINK_3_DESCRIPTION: Package Specification; COMPONENT_LINK_3_URL: http://cds.linear.com/docs/en/packaging/DFN_12_05-08-1695.pdf; DATASHEET: http://cds.linear.com/docs/en/datasheet/4356fa.pdf; DATASHEET_VERSION: Rev. A; EXTENDED_TEMP: C, I, H; FAST_COMPARATOR: no; FAULT: no; FOLDBACK: yes; FOOTPRINT_VARIANT_NAME_0: Manufacturer Recommended; IMPORTED: yes; IMPORTED_FROM: vault; IMPORT_TS: 1521855815; IN_RUSH_CURRENT: Ramp; MF: Linear Technology; MOUNTING_TECHNOLOGY: Surface Mount; MPN: LT4356IDE-1#PBF; PACKAGE: DE-UE-12; PACKAGE_DESCRIPTION: 12-Pin Plastic DFN, Body 4 x 3 mm, Pitch 0.5 mm; PACKAGE_VERSION: Rev. D, 06/2010; POWER_GOOD: no; PREFIX: U; RELEASE_DATE: 1377783053; RESET: no; ROHS: Yes; VAULT_GUID: 8B93637D-5FE0-477F-B341-97109F4E71FC; VAULT_REVISION: E0CC90F7-5B63-48A8-B828-07365940982B; VIN_RANGE: 4 to 80 V

## Module INVERTER
Ports: UH(in) UL(in) VH(in) VL(in) WH(in) WL(in) +15V(pwr) +24V(pwr) GND(pwr) U(out) V(out) W(out)
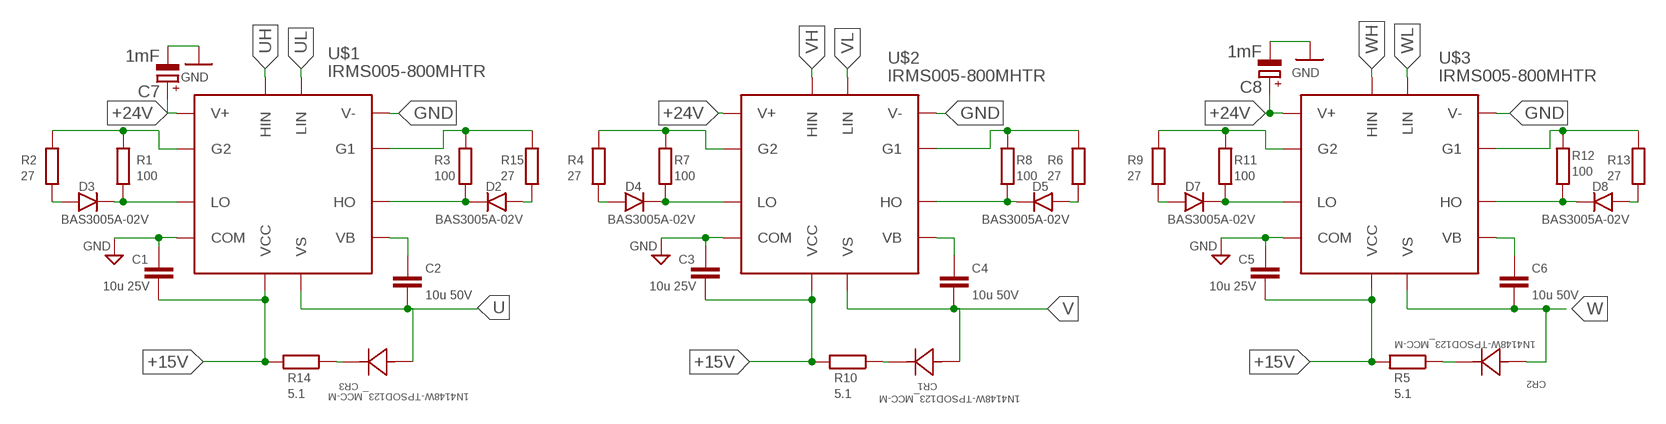
[diagram p2: schematic, module INVERTER, sheet 1]

### Parts
C1  10u 25V  C_CHIP-0805(2012-METRIC)  [CAPC2012X110]
C2  10u 50V  C_CHIP-1206(3216-METRIC)  [CAPC3216X135]
C3  10u 25V  C_CHIP-0805(2012-METRIC)  [CAPC2012X110]
C4  10u 50V  C_CHIP-1206(3216-METRIC)  [CAPC3216X135]
C5  10u 25V  C_CHIP-0805(2012-METRIC)  [CAPC2012X110]
C6  10u 50V  C_CHIP-1206(3216-METRIC)  [CAPC3216X135]
C7  1mF  CPOL-EUE7.5-16  [E7,5-16]
C8  1mF  CPOL-EUE7.5-16  [E7,5-16]
CR1  1N4148W-TPSOD123_MCC-M  [SOD123_MCC-M]
CR2  1N4148W-TPSOD123_MCC-M  [SOD123_MCC-M]
CR3  1N4148W-TPSOD123_MCC-M  [SOD123_MCC-M]
D2  BAS3005A-02V_0  [INFINEON_BAS3005A-02V_0]
D3  BAS3005A-02V_0  [INFINEON_BAS3005A-02V_0]
D4  BAS3005A-02V_0  [INFINEON_BAS3005A-02V_0]
D5  BAS3005A-02V_0  [INFINEON_BAS3005A-02V_0]
D7  BAS3005A-02V_0  [INFINEON_BAS3005A-02V_0]
D8  BAS3005A-02V_0  [INFINEON_BAS3005A-02V_0]
R1  100  RT0402FRE07100RL  [R0402]
R2  27  R-EU_R0402  [R0402]
R3  100  RT0402FRE07100RL  [R0402]
R4  27  R-EU_R0402  [R0402]
R5  5.1  R-EU_R0402  [R0402]
R6  27  R-EU_R0402  [R0402]
R7  100  RT0402FRE07100RL  [R0402]
R8  100  RT0402FRE07100RL  [R0402]
R9  27  R-EU_R0402  [R0402]
R10  5.1  R-EU_R0402  [R0402]
R11  100  RT0402FRE07100RL  [R0402]
R12  100  RT0402FRE07100RL  [R0402]
R13  27  R-EU_R0402  [R0402]
R14  5.1  R-EU_R0402  [R0402]
R15  27  R-EU_R0402  [R0402]
U$1  IRMS005-800MHTR  [INFINEON_IRSM005-800MH_0]
U$2  IRMS005-800MHTR  [INFINEON_IRSM005-800MH_0]
U$3  IRMS005-800MHTR  [INFINEON_IRSM005-800MH_0]

### Nets
+15V: C1.2 C3.2 C5.2 R5.2 R10.2 R14.2 U$1.2(VCC) U$2.2(VCC) U$3.2(VCC)
+24V: C7.+ C8.+ U$1.18-19-20-21-22-23(V+) U$2.18-19-20-21-22-23(V+) U$3.18-19-20-21-22-23(V+)
GND: C1.1 C3.1 C5.1 C7.- C8.- U$1.3(COM) U$1.6(COM) U$1.8(COM) U$1.11-12-13-14-15(V-) U$1.28(COM) U$2.3(COM) U$2.6(COM) U$2.8(COM) U$2.11-12-13-14-15(V-) U$2.28(COM) U$3.3(COM) U$3.6(COM) U$3.8(COM) U$3.11-12-13-14-15(V-) U$3.28(COM)
N$1: R3.2 R15.2 U$1.24(G1)
N$2: CR2.1 R5.1
N$3: D2.2(A) R15.1
N$4: C2.1 U$1.1(VB)
N$5: D3.1(K) R1.1 U$1.7(LO)
N$6: R1.2 R2.2 U$1.9(G2)
N$7: CR1.1 R10.1
N$8: D3.2(A) R2.1
N$9: CR3.1 R14.1
N$11: R6.2 R8.2 U$2.24(G1)
N$13: D2.1(K) R3.1 U$1.25(HO)
N$14: D4.1(K) R7.1 U$2.7(LO)
N$15: R4.2 R7.2 U$2.9(G2)
N$16: D4.2(A) R4.1
N$18: D5.1(K) R8.1 U$2.25(HO)
N$19: C4.1 U$2.1(VB)
N$21: D5.2(A) R6.1
N$25: R12.2 R13.2 U$3.24(G1)
N$26: D7.1(K) R11.1 U$3.7(LO)
N$27: R9.2 R11.2 U$3.9(G2)
N$28: D7.2(A) R9.1
N$30: D8.1(K) R12.1 U$3.25(HO)
N$31: C6.1 U$3.1(VB)
N$33: D8.2(A) R13.1
U: C2.2 CR3.2 U$1.10(VS) U$1.16-17(VS) U$1.26(VS) U$1.27(VS)
UH: U$1.4(HIN)
UL: U$1.5(LIN)
V: C4.2 CR1.2 U$2.10(VS) U$2.16-17(VS) U$2.26(VS) U$2.27(VS)
VH: U$2.4(HIN)
VL: U$2.5(LIN)
W: C6.2 CR2.2 U$3.10(VS) U$3.16-17(VS) U$3.26(VS) U$3.27(VS)
WH: U$3.4(HIN)
WL: U$3.5(LIN)

### Library data of the parts
C1-C6 = Capacitor:C: Capacitor - Generic; CATEGORY: Capacitor
C7 C8 = rcl:CPOL-EU: POLARIZED CAPACITOR, European symbol; SPICEPREFIX: C
CR1-CR3 = msrm:1N4148W-TP: High SpeedSwitching Diode400mW Source: Datasheet <https://www.mccsemi.com/pdf/Products/1N4148W(SOD123).pdf>; CURRENT: 150mA; DIGIKEY: 1N4148WTPMSCT-ND; VOLTAGE: 100V
D2-D5 D7 D8 = IMDL_lib:BAS3005A-02V: INF-D_K1A2-2; CIIVA_IDS: 21182063; COMPONENT_LINK_1_DESCRIPTION: Manufacturer URL; COMPONENT_LINK_1_URL: http://www.infineon.com/; COMPONENT_LINK_3_DESCRIPTION: Package Specification; COMPONENT_LINK_3_URL: http://www.infineon.com/dgdl/SC79-Package_Overview.pdf?folderId=db3a30431936bc4b011951fbddb03b15&fileId=db3a30431936bc4b01195226fe583b41; CONFIGURATION: single; CT_MAX: 15Â pF; DATASHEET: http://www.infineon.com/dgdl/bas3005aseries.pdf?folderId=db3a30431f848401011fcbf2ab4c04c4&fileId=db3a30432d9b3066012db872f12d0bb7; FOOTPRINT_VARIANT_NAME_0: Manufacturer Recommended; GREEN: true; HALOGEN_FREE: true; IF_MAX: 500Â mA; IMPORTED: yes; IMPORTED_FROM: vault; IMPORT_TS: 1521842213; MF: Infineon; MOUNTING_TECHNOLOGY: Surface Mount; MPN: BAS3005A-02V; PACKAGE: SC79; PACKAGE_DESCRIPTION: 2-Pin Semiconductor Package, 0.8 x 1.2 mm Body; PACKING: Reel; PREFIX: D; RELEASE_DATE: 1409237543; VAULT_GUID: EDAD54E0-67A3-4491-B804-28965AC47742; VAULT_REVISION: E1FDBEC9-D20E-4450-8851-E2B6A9887AF8; VF_MAX: 500Â V; VR_MAX: 30Â V
R1 R3 R7 R8 R11 R12 = msrm:RT?FRE07*L: SMD RESISTOR ± 1% Tol, Paper/PE taping reel, 50 ppm/°C, 7 inch dia. Reel Datasheet <http://www.yageo.com/documents/recent/PYu-RT_1-to-0.01_RoHS_L_11.pdf> package: 0201 : 0R ___ Source: Digikey <https://www.digikey.de/products/en?keywords=311-0.0MCT-ND> 1k ___ Source: Digikey <https://www.digikey.de/products/en?keywords=RT0201FRE071KL-ND> 10k ___ Source: Digikey <https://www.digikey.de/products/en?keywords=RT0201FRE0710KL-ND> 100 ___ Source: Digikey <https://www.digikey.de/products/en?keywords=RT0201FRE07100RL-ND> 330 ___ Source: Digikey <https://www.digikey.de/products/en?keywords=RT0201FRE07330RL-ND> package: 0402 : 0R ___ Source: Digikey <https://www.digikey.de/products/en?keywords=311-0.0LRCT-ND> 1k ___ Source: Digikey <https://www.digikey.de/products/en?keywords=%20YAG1234CT-ND> 2k2 ___ Source: Digikey <https://www.digikey.de/products/en?keywords=RT0402FRE072K2L-ND> 2k ___ Source: Digikey <https://www.digikey.de/products/en?keywords=YAG3345CT-ND> 4k7 ___ Source: Digikey <https://www.digikey.de/products/en?keywords=YAG3347CT-ND%20> 10k ___ Source: Digikey <https://www.digikey.de/products/en?keywords=YAG1233CT-ND> 12k1 ___ Source: Digikey <https://www.digikey.de/products/en?keywords=RT0402FRE0712K1L-ND> 49R9 ___ Source: Digikey <https://www.digikey.de/products/en?keywords=YAG3346CT-ND> 56k ___ Source: Digikey <https://www.digikey.de/products/en?keywords=RT0402FRE0756K2L-ND> 100k ___ Source: Digikey <https://www.digikey.de/products/en?keywords=YAG2307CT-ND> 100 ___ Source: Digikey <https://www.digikey.de/products/en?keywords=YAG3342CT-ND> 150 ___ Source: Digikey <https://www.digikey.de/product-detail/en/yageo/RT0402FRE07150RL/13-RT0402FRE07150RLCT-ND/12705162> 300 ___ Source: Digikey <https://www.digikey.de/products/en?keywords=RT0402FRE07300RL-ND> package: 0603 : 0R ___ Source: Digikey <https://www.digikey.de/products/en?keywords=311-0.0HRCT-ND> 1k ___ Source: Digikey <https://www.digikey.de/products/en?keywords=YAG2323CT-ND> 10k ___ Source: Digikey <https://www.digikey.de/products/en?keywords=YAG2321CT-ND> 100k ___ Source: Digikey <https://www.digikey.de/products/en?keywords=YAG2319CT-ND> 100 ___ Source: Digikey <https://www.digikey.de/products/en?keywords=YAG2320CT-ND> 300 ___ Source: Digikey <https://www.digikey.de/products/en?keywords=RT0603FRE07300RL-ND> 330 ___ Source: Digikey <https://www.digikey.de/products/en?keywords=YAG5957CT-ND>; DIGIKEY: YAG3342CT-ND; RVALUE: 100; SPICEPREFIX: R
R2 R4-R6 R9 R10 R13-R15 = resistor:R-EU_: RESISTOR, European symbol
U$1-U$3 = IMDL_lib:IRMS005-800MH

## Module CURRENT_MEAS
Ports: UIN(in) VIN(in) WIN(in) +24V_F(pwr) GND(pwr) UOUT(out) VOUT(out) WOUT(out) U_ADC(out) V_ADC(out) !OC_U!(out) !OC_V!(out)
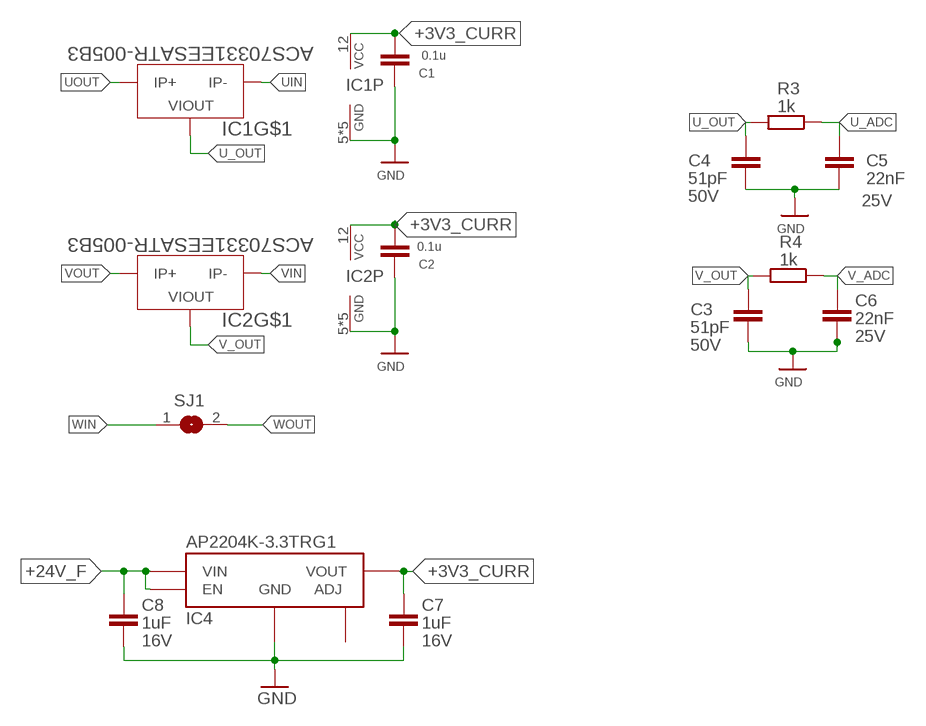
[diagram p3: schematic, module CURRENT_MEAS, sheet 1]

### Parts
C1  0.1u  C_CHIP-0402(1005-METRIC)  [CAPC1005X60]
C2  0.1u  C_CHIP-0402(1005-METRIC)  [CAPC1005X60]
C3  GCM1555C1H510JA01  [C0402]
C4  GCM1555C1H510JA01  [C0402]
C5  GCM155R71E223KA55  [C0402]
C6  GCM155R71E223KA55  [C0402]
C7  GCM188R71C105KA64  [C0603]
C8  GCM188R71C105KA64  [C0603]
IC1  ACS70331EESATR-005B3  [QFN12-ES]
IC2  ACS70331EESATR-005B3  [QFN12-ES]
IC4  AP2204K-3.3TRG1  [SOT-23-5]
R3  RT0402BRD071KL  [R0402]
R4  RT0402BRD071KL  [R0402]
SJ1  SJW  [SJW]

### Nets
+3V3_CURR: C1.2 C2.2 C7.1 IC1.12(P:VCC) IC2.12(P:VCC) IC4.5(VOUT)
+24V_F: C8.1 IC4.1(VIN) IC4.3(EN)
GND: C1.1 C2.1 C3.2 C4.2 C5.2 C6.2 C7.2 C8.2 IC1.5(P:GND) IC1.6(P:GND) IC1.8(P:GND) IC1.9(P:GND) IC1.11(P:GND) IC2.5(P:GND) IC2.6(P:GND) IC2.8(P:GND) IC2.9(P:GND) IC2.11(P:GND) IC4.2(GND)
U_ADC: C5.1 R3.1
U_OUT: C4.1 IC1.10(VIOUT) R3.2
UIN: IC1.3,4(IP-)
UOUT: IC1.1,2(IP+)
V_ADC: C6.1 R4.1
V_OUT: C3.1 IC2.10(VIOUT) R4.2
VIN: IC2.3,4(IP-)
VOUT: IC2.1,2(IP+)
WIN: SJ1.1
WOUT: SJ1.2
Unconnected: IC4.4(ADJ)

### Library data of the parts
C1 C2 = Capacitor:C: Capacitor - Generic; CATEGORY: Capacitor
C3 C4 = msrm:GCM?5C*: Multilayer Ceramic Capacitors Chip Multilayer Ceramic Capacitors for Automotive -55°C to 125°C Part Numbering <https://search.murata.co.jp/Ceramy/image/img/A01X/partnumbering_e_02.pdf> package: C0402 : 8.2pF ___ Source: Digikey <https://www.digikey.de/products/en?keywords=490-14426-6-ND> ; Datasheet <https://search.murata.co.jp/Ceramy/image/img/A01X/G101/ENG/GCM1555C1H8R2BA16-01.pdf> 10pF ___ Source: Digikey <https://www.digikey.de/products/en?keywords=490-10668-1-ND> ; Datasheet <https://www.murata.com/-/media/webrenewal/support/library/catalog/products/capacitor/ceramiccapacitor/c03e.ashx?la=en-us&cvid=20200707014404000000> 100pF___ Source: Digikey <https://www.digikey.de/products/en?keywords=490-10669-1-ND> ; Datasheet <https://www.murata.com/-/media/webrenewal/support/library/catalog/products/capacitor/ceramiccapacitor/c03e.ashx?la=en-us&cvid=20200707014404000000> 1000pF ___ Source: Digikey <https://www.digikey.de/products/en?keywords=490-16461-1-ND> ; Datasheet <https://search.murata.co.jp/Ceramy/image/img/A01X/G101/ENG/GCM1555C1H102FA16-01.pdf> 15pF_1% ___ Source: Digikey <https://www.digikey.de/products/en?keywords=490-14350-1-ND> ; Datasheet <https://search.murata.co.jp/Ceramy/image/img/A01X/G101/ENG/GCM1555C1H150FA16-01.pdf> 15pF_5% ___ Source: Digikey <https://www.digikey.de/products/en?keywords=490-11147-1-ND> ; Datasheet <https://www.murata.com/-/media/webrenewal/support/library/catalog/products/capacitor/ceramiccapacitor/c03e.ashx?la=en-us&cvid=20200707014404000000> 18pF ___ Source: Digikey <https://www.digikey.de/products/en?keywords=490-12650-1-ND> ; Datasheet <https://www.murata.com/-/media/webrenewal/support/library/catalog/products/capacitor/ceramiccapacitor/c03e.ashx?la=en-us&cvid=20200707014404000000> 22pF ___ Source: Digikey <https://www.digikey.de/products/en?keywords=490-9648-1-ND> ; Datasheet <https://search.murata.co.jp/Ceramy/image/img/A01X/G101/ENG/GCM1555C1H220JA16-01.pdf> 51pF ___ Source: Digikey <https://www.digikey.de/products/en?keywords=490-5944-1-ND> ; Datasheet <https://search.murata.co.jp/Ceramy/image/img/A01X/G101/ENG/GRM1555C1H510JA01-01.pdf> 680pF ___ Source: Digikey <https://www.digikey.de/products/en?keywords=490-16439-1-ND> ; Datasheet <https://search.murata.co.jp/Ceramy/image/img/A01X/G101/ENG/GCM1555C1H681FA16-01.pdf>; CAPACITANCE: 51pF; DIGIKEY: 490-5944-1-ND; TOLERANCE: ±5%; VOLTAGE: 50V
C5 C6 = msrm:GCM?R7*: Multilayer Ceramic Capacitors Chip Multilayer Ceramic Capacitors for Automotive –55 to 125°C Sources: Catalogue <https://www.murata.com/~/media/webrenewal/support/library/catalog/products/capacitor/mlcc/c03e.ashx?la=en-us> Part Numbering <https://search.murata.co.jp/Ceramy/image/img/A01X/partnumbering_e_02.pdf> package: C0201 : 470pF ___ Source: Digikey <https://www.digikey.de/products/en?keywords=490-17744-1-ND> ; Datasheet <https://search.murata.co.jp/Ceramy/image/img/A01X/G101/ENG/GCM033R71E471KA03-01.pdf> package: C0402 : 100nF ___ Source: Digikey <https://www.digikey.de/products/en?keywords=490-16433-1-ND> ; Datasheet <https://search.murata.co.jp/Ceramy/image/img/A01X/G101/ENG/GCM155R71C104JA55-01.pdf> 220nF ___ Source: Digikey <https://www.digikey.de/products/en?keywords=490-10671-1-ND> ; Datasheet <https://www.murata.com/-/media/webrenewal/support/library/catalog/products/capacitor/ceramiccapacitor/c03e.ashx?la=en-us&cvid=20200707014404000000> 6.8nF ___ Source: Digikey <https://www.digikey.de/products/en?keywords=490-12655-1-ND> ; Datasheet <https://search.murata.co.jp/Ceramy/image/img/A01X/G101/ENG/GCM155R71C683KA55-01.pdf> 10nF ___ Source: Digikey <https://www.digikey.de/products/en?keywords=490-6043-1-ND> ; Datasheet <https://search.murata.co.jp/Ceramy/image/img/A01X/G101/ENG/GCM155R71E103KA37-01.pdf> 22nF ___ Source: Digikey <https://www.digikey.de/products/en?keywords=490-6044-1-ND> ; Datasheet <https://search.murata.co.jp/Ceramy/image/img/A01X/G101/ENG/GCM155R71E223KA55-01.pdf> 470pF ___ Source: Digikey <https://www.digikey.de/products/en?keywords=490-4913-1-ND> ; Datasheet <https://search.murata.co.jp/Ceramy/image/img/A01X/G101/ENG/GCM155R71H471KA37-01.pdf> package: C0603 : 1µF ___ Source: Digikey <https://www.digikey.de/products/en?keywords=490-5241-1-ND> ; Datasheet <https://www.murata.com/-/media/webrenewal/support/library/catalog/products/capacitor/ceramiccapacitor/c03e.ashx?la=en-us&cvid=20200707014404000000> 470nF ___ Source: Digikey <https://www.digikey.de/products/en?keywords=490-12589-1-ND> ; Datasheet <https://search.murata.co.jp/Ceramy/image/img/A01X/G101/ENG/GCM188R71C474KA55-01.pdf> 10nF ___ Source: Digikey <https://www.digikey.de/products/en?keywords=490-4781-1-ND> ; Datasheet <https://search.murata.co.jp/Ceramy/image/img/A01X/G101/ENG/GCM188R72A103KA37-01.pdf> 22nF ___ Source: Digikey <https://www.digikey.de/products/en?keywords=490-4782-1-ND> ; Datasheet <https://www.murata.com/-/media/webrenewal/support/library/catalog/products/capacitor/ceramiccapacitor/c03e.ashx?la=en-us&cvid=20200707014404000000> package: C0805 : 10µF ___ Source: Digikey <https://www.digikey.de/products/en?keywords=490-14361-1-ND> ; Datasheet <https://search.murata.co.jp/Ceramy/image/img/A01X/G101/ENG/GCM21BR70J106KE22-01.pdf> 2.2µF ___ Source: Digikey <https://www.digikey.de/products/en?keywords=490-4786-1-ND> ; Datasheet <https://search.murata.co.jp/Ceramy/image/img/A01X/G101/ENG/GCM21BR71C225KA64-01.pdf> 470nF ___ Source: Digikey <https://www.digikey.de/products/en?keywords=490-4788-1-ND> ; Datasheet <https://search.murata.co.jp/Ceramy/image/img/A01X/G101/ENG/GCM21BR71H474KA55-01.pdf> 100nF ___ Source: Digikey <https://www.digikey.de/products/en?keywords=490-8051-1-ND> ; Datasheet <https://search.murata.co.jp/Ceramy/image/img/A01X/G101/ENG/GCM21BR72A104KA37-01.pdf> package: C0805K : 220nF ___ Source: Digikey <https://www.digikey.de/products/en?keywords=490-8306-1-ND> ; Datasheet <https://search.murata.co.jp/Ceramy/image/img/A01X/G101/ENG/GRM21AR72A224KAC5-01.pdf> package: C1206 : 10µF ___ Source: Digikey <https://www.digikey.de/products/en?keywords=490-14746-1-ND> ; Datasheet <https://search.murata.co.jp/Ceramy/image/img/A01X/G101/ENG/GCM31CR71C106KA64-01.pdf> 2.2µF ___ Source: Digikey <https://www.digikey.de/products/en?keywords=490-11169-1-ND> ; Datasheet <https://search.murata.co.jp/Ceramy/image/img/A01X/G101/ENG/GCM31CR71H225KA55-01.pdf> package: C1206 : 2220nF ___ Source: Digikey <https://www.digikey.de/products/en?keywords=490-4975-1-ND> ; Datasheet <https://search.murata.co.jp/Ceramy/image/img/A01X/G101/ENG/GCM31MR72A224KA37-01.pdf>; CAPACITANCE: 22nF; DIGIKEY: 490-6044-1-ND; TOLERANCE: ±10%; VOLTAGE: 25V
C7 C8 = msrm:GCM?R7*: Multilayer Ceramic Capacitors Chip Multilayer Ceramic Capacitors for Automotive –55 to 125°C Sources: Catalogue <https://www.murata.com/~/media/webrenewal/support/library/catalog/products/capacitor/mlcc/c03e.ashx?la=en-us> Part Numbering <https://search.murata.co.jp/Ceramy/image/img/A01X/partnumbering_e_02.pdf> package: C0201 : 470pF ___ Source: Digikey <https://www.digikey.de/products/en?keywords=490-17744-1-ND> ; Datasheet <https://search.murata.co.jp/Ceramy/image/img/A01X/G101/ENG/GCM033R71E471KA03-01.pdf> package: C0402 : 100nF ___ Source: Digikey <https://www.digikey.de/products/en?keywords=490-16433-1-ND> ; Datasheet <https://search.murata.co.jp/Ceramy/image/img/A01X/G101/ENG/GCM155R71C104JA55-01.pdf> 220nF ___ Source: Digikey <https://www.digikey.de/products/en?keywords=490-10671-1-ND> ; Datasheet <https://www.murata.com/-/media/webrenewal/support/library/catalog/products/capacitor/ceramiccapacitor/c03e.ashx?la=en-us&cvid=20200707014404000000> 6.8nF ___ Source: Digikey <https://www.digikey.de/products/en?keywords=490-12655-1-ND> ; Datasheet <https://search.murata.co.jp/Ceramy/image/img/A01X/G101/ENG/GCM155R71C683KA55-01.pdf> 10nF ___ Source: Digikey <https://www.digikey.de/products/en?keywords=490-6043-1-ND> ; Datasheet <https://search.murata.co.jp/Ceramy/image/img/A01X/G101/ENG/GCM155R71E103KA37-01.pdf> 22nF ___ Source: Digikey <https://www.digikey.de/products/en?keywords=490-6044-1-ND> ; Datasheet <https://search.murata.co.jp/Ceramy/image/img/A01X/G101/ENG/GCM155R71E223KA55-01.pdf> 470pF ___ Source: Digikey <https://www.digikey.de/products/en?keywords=490-4913-1-ND> ; Datasheet <https://search.murata.co.jp/Ceramy/image/img/A01X/G101/ENG/GCM155R71H471KA37-01.pdf> package: C0603 : 1µF ___ Source: Digikey <https://www.digikey.de/products/en?keywords=490-5241-1-ND> ; Datasheet <https://www.murata.com/-/media/webrenewal/support/library/catalog/products/capacitor/ceramiccapacitor/c03e.ashx?la=en-us&cvid=20200707014404000000> 470nF ___ Source: Digikey <https://www.digikey.de/products/en?keywords=490-12589-1-ND> ; Datasheet <https://search.murata.co.jp/Ceramy/image/img/A01X/G101/ENG/GCM188R71C474KA55-01.pdf> 10nF ___ Source: Digikey <https://www.digikey.de/products/en?keywords=490-4781-1-ND> ; Datasheet <https://search.murata.co.jp/Ceramy/image/img/A01X/G101/ENG/GCM188R72A103KA37-01.pdf> 22nF ___ Source: Digikey <https://www.digikey.de/products/en?keywords=490-4782-1-ND> ; Datasheet <https://www.murata.com/-/media/webrenewal/support/library/catalog/products/capacitor/ceramiccapacitor/c03e.ashx?la=en-us&cvid=20200707014404000000> package: C0805 : 10µF ___ Source: Digikey <https://www.digikey.de/products/en?keywords=490-14361-1-ND> ; Datasheet <https://search.murata.co.jp/Ceramy/image/img/A01X/G101/ENG/GCM21BR70J106KE22-01.pdf> 2.2µF ___ Source: Digikey <https://www.digikey.de/products/en?keywords=490-4786-1-ND> ; Datasheet <https://search.murata.co.jp/Ceramy/image/img/A01X/G101/ENG/GCM21BR71C225KA64-01.pdf> 470nF ___ Source: Digikey <https://www.digikey.de/products/en?keywords=490-4788-1-ND> ; Datasheet <https://search.murata.co.jp/Ceramy/image/img/A01X/G101/ENG/GCM21BR71H474KA55-01.pdf> 100nF ___ Source: Digikey <https://www.digikey.de/products/en?keywords=490-8051-1-ND> ; Datasheet <https://search.murata.co.jp/Ceramy/image/img/A01X/G101/ENG/GCM21BR72A104KA37-01.pdf> package: C0805K : 220nF ___ Source: Digikey <https://www.digikey.de/products/en?keywords=490-8306-1-ND> ; Datasheet <https://search.murata.co.jp/Ceramy/image/img/A01X/G101/ENG/GRM21AR72A224KAC5-01.pdf> package: C1206 : 10µF ___ Source: Digikey <https://www.digikey.de/products/en?keywords=490-14746-1-ND> ; Datasheet <https://search.murata.co.jp/Ceramy/image/img/A01X/G101/ENG/GCM31CR71C106KA64-01.pdf> 2.2µF ___ Source: Digikey <https://www.digikey.de/products/en?keywords=490-11169-1-ND> ; Datasheet <https://search.murata.co.jp/Ceramy/image/img/A01X/G101/ENG/GCM31CR71H225KA55-01.pdf> package: C1206 : 2220nF ___ Source: Digikey <https://www.digikey.de/products/en?keywords=490-4975-1-ND> ; Datasheet <https://search.murata.co.jp/Ceramy/image/img/A01X/G101/ENG/GCM31MR72A224KA37-01.pdf>; CAPACITANCE: 1uF; DIGIKEY: 490-5241-1-ND; TOLERANCE: ±10%; VOLTAGE: 16V
IC1 IC2 = msrm:ACS70331E?: ACS70331 current sensor small package, Package:12-contact QFN with fused current loop. Temperature(°C): –40 to 85. Packing: 1500 pieces per reel. package: QFN12-ES 620-1889-1-ND___Source: Digikey <https://www.digikey.de/products/en?keywords=620-1889-1-ND> ; Datasheet <https://www.allegromicro.com/~/media/Files/Datasheets/ACS70331-Datasheet.ashx> 620-1890-1-ND___Source: Digikey <https://www.digikey.de/products/en?keywords=620-1890-1-ND> ; Datasheet <https://www.allegromicro.com/~/media/Files/Datasheets/ACS70331-Datasheet.ashx> 620-1887-1-ND___Source: Digikey <https://www.digikey.de/products/en?keywords=620-1887-1-ND> ; Datasheet <https://www.allegromicro.com/~/media/Files/Datasheets/ACS70331-Datasheet.ashx> 620-1888-1-ND___Source: Digikey <https://www.digikey.de/products/en?keywords=620-1888-1-ND> ; Datasheet <https://www.allegromicro.com/~/media/Files/Datasheets/ACS70331-Datasheet.ashx> package: SOIC8 ACS70331EOLCTR-2P5B3-ND___Source: Digikey <https://www.digikey.de/products/en?keywords=ACS70331EOLCTR-2P5B3> ; Datasheet <https://www.allegromicro.com/~/media/Files/Datasheets/ACS70331-Datasheet.ashx> ACS70331EOLCTR-2P5U3-ND ___Source: Digikey <https://www.digikey.de/products/en?keywords=ACS70331EOLCTR-2P5U3> ; Datasheet <https://www.allegromicro.com/~/media/Files/Datasheets/ACS70331-Datasheet.ashx> ACS70331EOLCTR-005B3-ND___Source: Digikey <https://www.digikey.de/products/en?keywords=ACS70331EOLCTR-005B3> ; Datasheet <https://www.allegromicro.com/~/media/Files/Datasheets/ACS70331-Datasheet.ashx> ACS70331EOLCTR-005U3-ND___Source: Digikey <https://www.digikey.de/products/en?keywords=ACS70331EOLCTR-005U3> ; Datasheet <https://www.allegromicro.com/~/media/Files/Datasheets/ACS70331-Datasheet.ashx>; CURRENT_RANGE: -5~5A; DIGIKEY: 620-1887-1-ND; DISPLAY: ACS70331; SENSITIVITY: 200mV/A
IC4 = msrm:AP2204?-*TRG1: Linear Voltage Regulator IC 1 Output 150mA SOT-23-5 package: SOIC : APM2204MP-ADJTRG1DICT-ND ___ Source: Digikey <https://www.digikey.de/products/de?keywords=AP2204MP-ADJTRG1DICT-ND> ; Datasheet <https://media.digikey.com/pdf/Data%20Sheets/Diodes%20PDFs/AP2204_Jan2020.pdf> package: SOT-23-5 : 1.5TRG1 ___ Source: Digikey <https://www.digikey.de/product-detail/en/diodes-incorporated/AP2204K-1-5TRG1/AP2204K-1-5TRG1-ND/5305710?cur=EUR&lang=en> ; Datasheet <https://media.digikey.com/pdf/Data%20Sheets/Diodes%20PDFs/AP2204_Jan2020.pdf> 1.8TRG1 ___ Source: Digikey <https://www.digikey.de/product-detail/en/diodes-incorporated/AP2204K-1-5TRG1/AP2204K-1-5TRG1-ND/5305710?cur=EUR&lang=en> ; Datasheet <https://media.digikey.com/pdf/Data%20Sheets/Diodes%20PDFs/AP2204_Jan2020.pdf> 2.5TRG1 ___ Source: / 2.8TRG1 ___ Source: / 3.0TRG1 ___ Source: Digikey <https://www.digikey.de/products/de?keywords=AP2204K-3.0TRG1DICT-ND> ; Datasheet <https://media.digikey.com/pdf/Data%20Sheets/Diodes%20PDFs/AP2204_Jan2020.pdf> 3.3TRG1 ___ Source: Digikey <https://www.digikey.de/products/de?keywords=AP2204K-3.3TRG1DICT-ND> ; Datasheet <https://media.digikey.com/pdf/Data%20Sheets/Diodes%20PDFs/AP2204_Jan2020.pdf> 5.0RG1 ___ Source: Digikey <https://www.digikey.de/products/de?keywords=AP2204K-5.0TRG1DICT-ND> ; Datasheet <https://media.digikey.com/pdf/Data%20Sheets/Diodes%20PDFs/AP2204_Jan2020.pdf> ADJTRG1 ___ Source: Digikey <https://www.digikey.de/products/de?keywords=AP2204K-ADJTRG1DICT-ND> ; Datasheet <https://media.digikey.com/pdf/Data%20Sheets/Diodes%20PDFs/AP2204_Jan2020.pdf>; DIGIKEY: AP2204K-3.3TRG1DICT-ND
R3 R4 = msrm:RT?BRD07*L: SMD-Resistor ±0.1% 0.063W, 1/16W Chip Resistor 0402 (1005 Metric) Thin Film package: R0402 : 1k ___ Source: Digikey <https://www.digikey.de/products/en?keywords=%20YAG1386CT-ND> ; Datasheet <https://www.yageo.com/upload/media/product/productsearch/datasheet/rchip/PYu-RT_1-to-0.01_RoHS_L_12.pdf> 2k05 ___ Source: Digikey <https://www.digikey.de/products/en?keywords=YAG1400CT-ND> ; Datasheet <https://www.yageo.com/upload/media/product/productsearch/datasheet/rchip/PYu-RT_1-to-0.01_RoHS_L_12.pdf> 3k2 ___ Source: Digikey <YAG4255CT-ND> ; Datasheet <https://www.yageo.com/upload/media/product/productsearch/datasheet/rchip/PYu-RT_1-to-0.01_RoHS_L_12.pdf> 4k99 ___ Source: Digikey <https://www.digikey.de/products/en?keywords=YAG1447CT-ND> ; Datasheet <https://www.yageo.com/upload/media/product/productsearch/datasheet/rchip/PYu-RT_1-to-0.01_RoHS_L_12.pdf> 10k ___ Source: Digikey <https://www.digikey.de/products/en?keywords=%E2%80%8EA119918CT-ND%E2%80%8E> ; Datasheet <https://www.yageo.com/upload/media/product/productsearch/datasheet/rchip/PYu-RT_1-to-0.01_RoHS_L_12.pdf> 12k ___ Source: Digikey <https://www.digikey.de/products/en?keywords=YAG1354CT-ND> ; Datasheet <https://www.yageo.com/upload/media/product/productsearch/datasheet/rchip/PYu-RT_1-to-0.01_RoHS_L_12.pdf> 22k ___ Source: Digikey <https://www.digikey.de/products/en?keywords=YAG4210CT-ND> ; Datasheet <https://www.yageo.com/upload/media/product/productsearch/datasheet/rchip/PYu-RT_1-to-0.01_RoHS_L_12.pdf> 56k ___ Source: Digikey <https://www.digikey.de/products/en?keywords=YAG1454CT-ND%20> ; Datasheet <https://www.yageo.com/upload/media/product/productsearch/datasheet/rchip/PYu-RT_1-to-0.01_RoHS_L_12.pdf> 60k4 ___ Source: Digikey <https://www.digikey.de/products/en?keywords=YAG1461CT-ND> ; Datasheet <https://www.yageo.com/upload/media/product/productsearch/datasheet/rchip/PYu-RT_1-to-0.01_RoHS_L_12.pdf> 270R ___ Source: Digikey <https://www.digikey.de/products/en?keywords=YAG1396CT-ND> ; Datasheet <https://www.yageo.com/upload/media/product/productsearch/datasheet/rchip/PYu-RT_1-to-0.01_RoHS_L_12.pdf>; DIGIKEY: YAG1386CT-ND; RVALUE: 1k; SPICEPREFIX: R
SJ1 = jumper:SJ: SMD solder JUMPER

## Module ATSAME
Ports: +3V3(pwr) GND(pwr) SWO(io) SWDIO(io) SWCLK(io) NRESET(io) ECAT_MISO(io) ECAT_MOSI(io) ECAT_NCS(io) ECAT_SCK(io) ENC_MISO(io) ENC_MOSI(io) ENC_NCS(io) ENC_SCK(io) HALL_A(io) HALL_B(io) HALL_C(io) HALL_O(io) UH(io) UL(io) VH(io) VL(io) WH(io) WL(io) U_ADC(io) V_ADC(io) TRQ_ADC(io) ECAT_SQI2(io) ECAT_SQI3(io)
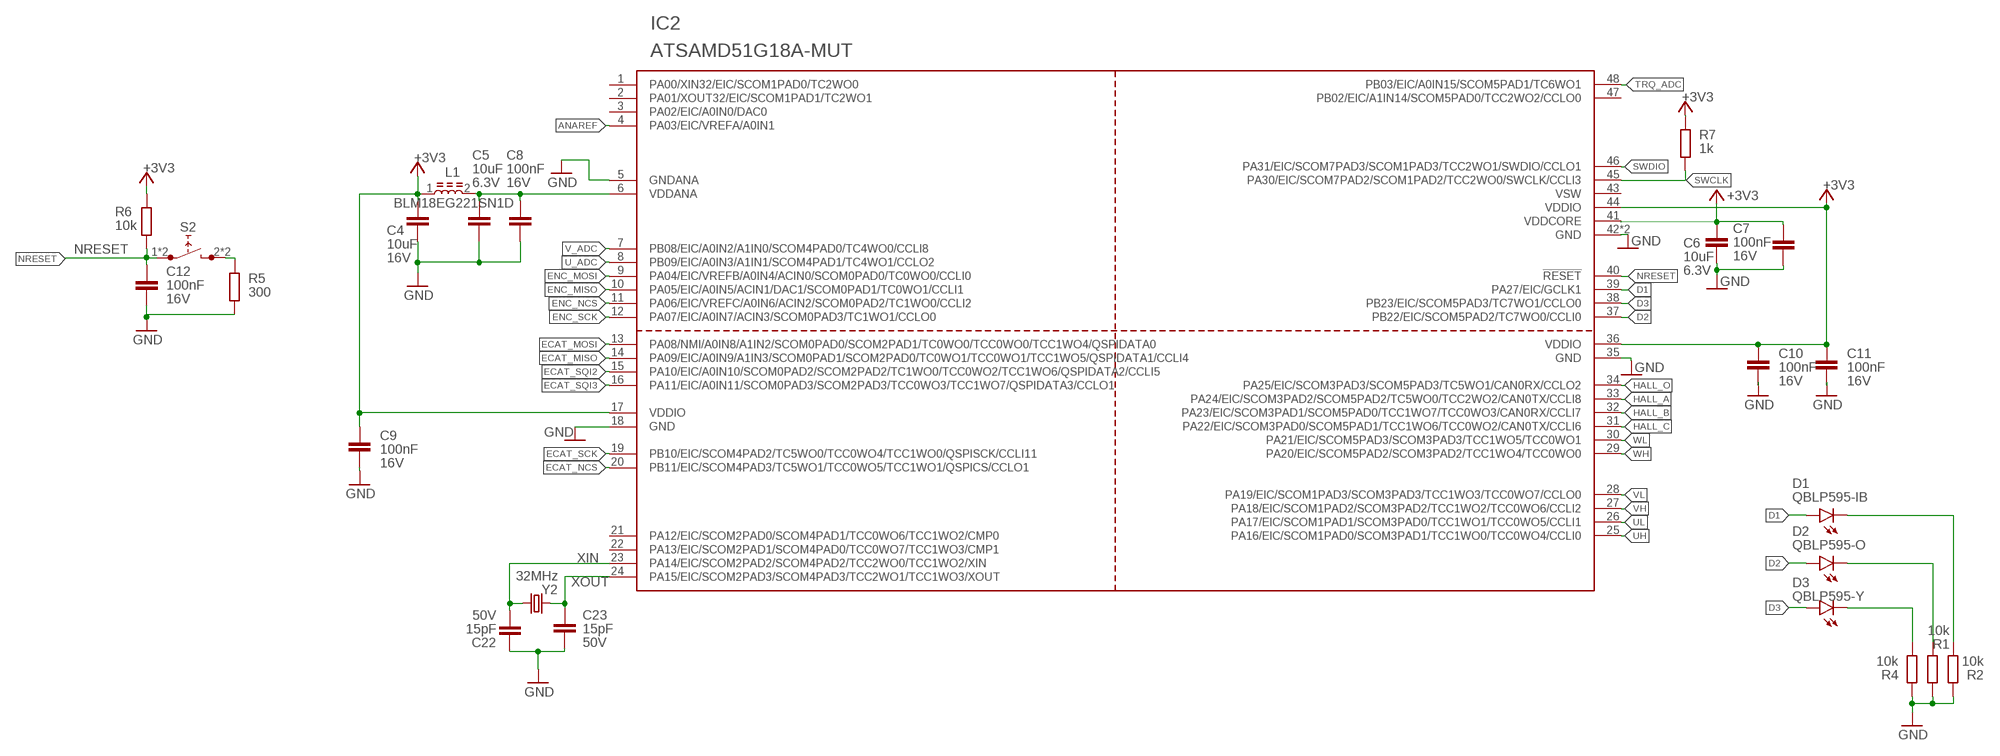
[diagram p4: schematic, module ATSAME, sheet 1]

### Parts
C4  GCM31CR71C106KA64  [C1206]
C5  GCM21BR70J106KE22K  [C0805]
C6  GCM21BR70J106KE22K  [C0805]
C7  GCM155R71C104JA55  [C0402]
C8  GCM155R71C104JA55  [C0402]
C9  GCM155R71C104JA55  [C0402]
C10  GCM155R71C104JA55  [C0402]
C11  GCM155R71C104JA55  [C0402]
C12  GCM155R71C104JA55  [C0402]
C22  GCM1555C1H150FA16  [C0402]
C23  GCM1555C1H150FA16  [C0402]
D1  QBLP595-IB  [LED0402]
D2  QBLP595-O  [LED0402]
D3  QBLP595-Y  [LED0402]
IC2  ATSAMD51G18A-MUT  [QFN48]
L1  BLM18EG221SN1D  [BEADC1608X80]
R1  RT0402BRD0710KL  [R0402]
R2  RT0402BRD0710KL  [R0402]
R4  RT0402BRD0710KL  [R0402]
R5  RT0402FRE07300RL  [R0402]
R6  RT0402FRE0710KL  [R0402]
R7  RT0402FRE071KL  [R0402]
S2  USLPT2616CT2TR  [USLPT2616CT]
Y2  ECS-320-12-36B-CKY-TR  [ECX-2236]

### Nets
+3V3: C4.1 C6.1 C7.1 C9.1 C10.1 C11.1 IC2.17(VDDIO) IC2.36(VDDIO) IC2.41(VDDCORE) IC2.44(VDDIO) L1.1 R6.2 R7.2
ANAREF: IC2.4(PA03/EIC/VREFA/A0IN1)
D1: D1.2(A) IC2.39(PA27/EIC/GCLK1)
D2: D2.2(A) IC2.37(PB22/EIC/SCOM5PAD2/TC7WO0/CCLI0)
D3: D3.2(A) IC2.38(PB23/EIC/SCOM5PAD3/TC7WO1/CCLO0)
ECAT_MISO: IC2.14(PA09/EIC/A0IN9/A1IN3/SCOM0PAD1/SCOM2PAD0/TC0WO1/TCC0WO1/TCC1WO5/QSPIDATA1/CCLI4)
ECAT_MOSI: IC2.13(PA08/NMI/A0IN8/A1IN2/SCOM0PAD0/SCOM2PAD1/TC0WO0/TCC0WO0/TCC1WO4/QSPIDATA0)
ECAT_NCS: IC2.20(PB11/EIC/SCOM4PAD3/TC5WO1/TCC0WO5/TCC1WO1/QSPICS/CCLO1)
ECAT_SCK: IC2.19(PB10/EIC/SCOM4PAD2/TC5WO0/TCC0WO4/TCC1WO0/QSPISCK/CCLI11)
ECAT_SQI2: IC2.15(PA10/EIC/A0IN10/SCOM0PAD2/SCOM2PAD2/TC1WO0/TCC0WO2/TCC1WO6/QSPIDATA2/CCLI5)
ECAT_SQI3: IC2.16(PA11/EIC/A0IN11/SCOM0PAD3/SCOM2PAD3/TCC0WO3/TCC1WO7/QSPIDATA3/CCLO1)
ENC_MISO: IC2.10(PA05/EIC/A0IN5/ACIN1/DAC1/SCOM0PAD1/TC0WO1/CCLI1)
ENC_MOSI: IC2.9(PA04/EIC/VREFB/A0IN4/ACIN0/SCOM0PAD0/TC0WO0/CCLI0)
ENC_NCS: IC2.11(PA06/EIC/VREFC/A0IN6/ACIN2/SCOM0PAD2/TC1WO0/CCLI2)
ENC_SCK: IC2.12(PA07/EIC/A0IN7/ACIN3/SCOM0PAD3/TC1WO1/CCLO0)
GND: C4.2 C5.2 C6.2 C7.2 C8.2 C9.2 C10.2 C11.2 C12.2 C22.1 C23.1 IC2.5(GNDANA) IC2.18(GND) IC2.35(GND) IC2.42(GND) IC2.EXP(GND) R1.2 R2.2 R4.2 R5.1
HALL_A: IC2.33(PA24/EIC/SCOM3PAD2/SCOM5PAD2/TC5WO0/TCC2WO2/CAN0TX/CCLI8)
HALL_B: IC2.32(PA23/EIC/SCOM3PAD1/SCOM5PAD0/TCC1WO7/TCC0WO3/CAN0RX/CCLI7)
HALL_C: IC2.31(PA22/EIC/SCOM3PAD0/SCOM5PAD1/TCC1WO6/TCC0WO2/CAN0TX/CCLI6)
HALL_O: IC2.34(PA25/EIC/SCOM3PAD3/SCOM5PAD3/TC5WO1/CAN0RX/CCLO2)
N$1: D3.1(C) R4.1
N$2: D2.1(C) R1.1
N$12: C5.1 C8.1 IC2.6(VDDANA) L1.2
N$13: R5.2 S2.2 S2.4
N$16: D1.1(C) R2.1
NRESET: C12.1 IC2.40(!RESET) R6.1 S2.1 S2.3
SWCLK: IC2.45(PA30/EIC/SCOM7PAD2/SCOM1PAD2/TCC2WO0/SWCLK/CCLI3) R7.1
SWDIO: IC2.46(PA31/EIC/SCOM7PAD3/SCOM1PAD3/TCC2WO1/SWDIO/CCLO1)
TRQ_ADC: IC2.48(PB03/EIC/A0IN15/SCOM5PAD1/TC6WO1)
U_ADC: IC2.8(PB09/EIC/A0IN3/A1IN1/SCOM4PAD1/TC4WO1/CCLO2)
UH: IC2.25(PA16/EIC/SCOM1PAD0/SCOM3PAD1/TCC1WO0/TCC0WO4/CCLI0)
UL: IC2.26(PA17/EIC/SCOM1PAD1/SCOM3PAD0/TCC1WO1/TCC0WO5/CCLI1)
V_ADC: IC2.7(PB08/EIC/A0IN2/A1IN0/SCOM4PAD0/TC4WO0/CCLI8)
VH: IC2.27(PA18/EIC/SCOM1PAD2/SCOM3PAD2/TCC1WO2/TCC0WO6/CCLI2)
VL: IC2.28(PA19/EIC/SCOM1PAD3/SCOM3PAD3/TCC1WO3/TCC0WO7/CCLO0)
WH: IC2.29(PA20/EIC/SCOM5PAD2/SCOM3PAD2/TCC1WO4/TCC0WO0)
WL: IC2.30(PA21/EIC/SCOM5PAD3/SCOM3PAD3/TCC1WO5/TCC0WO1)
XIN: C22.2 IC2.23(PA14/EIC/SCOM2PAD2/SCOM4PAD2/TCC2WO0/TCC1WO2/XIN) Y2.3
XOUT: C23.2 IC2.24(PA15/EIC/SCOM2PAD3/SCOM4PAD3/TCC2WO1/TCC1WO3/XOUT) Y2.1
Unconnected: IC2.1(PA00/XIN32/EIC/SCOM1PAD0/TC2WO0) IC2.2(PA01/XOUT32/EIC/SCOM1PAD1/TC2WO1) IC2.3(PA02/EIC/A0IN0/DAC0) IC2.21(PA12/EIC/SCOM2PAD0/SCOM4PAD1/TCC0WO6/TCC1WO2/CMP0) IC2.22(PA13/EIC/SCOM2PAD1/SCOM4PAD0/TCC0WO7/TCC1WO3/CMP1) IC2.43(VSW) IC2.47(PB02/EIC/A1IN14/SCOM5PAD0/TCC2WO2/CCLO0) Y2.2(S) Y2.4(S)

### Library data of the parts
C4 = msrm:GCM?R7*: Multilayer Ceramic Capacitors Chip Multilayer Ceramic Capacitors for Automotive –55 to 125°C Sources: Catalogue <https://www.murata.com/~/media/webrenewal/support/library/catalog/products/capacitor/mlcc/c03e.ashx?la=en-us> Part Numbering <https://search.murata.co.jp/Ceramy/image/img/A01X/partnumbering_e_02.pdf> package: C0201 : 470pF ___ Source: Digikey <https://www.digikey.de/products/en?keywords=490-17744-1-ND> ; Datasheet <https://search.murata.co.jp/Ceramy/image/img/A01X/G101/ENG/GCM033R71E471KA03-01.pdf> package: C0402 : 100nF ___ Source: Digikey <https://www.digikey.de/products/en?keywords=490-16433-1-ND> ; Datasheet <https://search.murata.co.jp/Ceramy/image/img/A01X/G101/ENG/GCM155R71C104JA55-01.pdf> 220nF ___ Source: Digikey <https://www.digikey.de/products/en?keywords=490-10671-1-ND> ; Datasheet <https://www.murata.com/-/media/webrenewal/support/library/catalog/products/capacitor/ceramiccapacitor/c03e.ashx?la=en-us&cvid=20200707014404000000> 6.8nF ___ Source: Digikey <https://www.digikey.de/products/en?keywords=490-12655-1-ND> ; Datasheet <https://search.murata.co.jp/Ceramy/image/img/A01X/G101/ENG/GCM155R71C683KA55-01.pdf> 10nF ___ Source: Digikey <https://www.digikey.de/products/en?keywords=490-6043-1-ND> ; Datasheet <https://search.murata.co.jp/Ceramy/image/img/A01X/G101/ENG/GCM155R71E103KA37-01.pdf> 22nF ___ Source: Digikey <https://www.digikey.de/products/en?keywords=490-6044-1-ND> ; Datasheet <https://search.murata.co.jp/Ceramy/image/img/A01X/G101/ENG/GCM155R71E223KA55-01.pdf> 470pF ___ Source: Digikey <https://www.digikey.de/products/en?keywords=490-4913-1-ND> ; Datasheet <https://search.murata.co.jp/Ceramy/image/img/A01X/G101/ENG/GCM155R71H471KA37-01.pdf> package: C0603 : 1µF ___ Source: Digikey <https://www.digikey.de/products/en?keywords=490-5241-1-ND> ; Datasheet <https://www.murata.com/-/media/webrenewal/support/library/catalog/products/capacitor/ceramiccapacitor/c03e.ashx?la=en-us&cvid=20200707014404000000> 470nF ___ Source: Digikey <https://www.digikey.de/products/en?keywords=490-12589-1-ND> ; Datasheet <https://search.murata.co.jp/Ceramy/image/img/A01X/G101/ENG/GCM188R71C474KA55-01.pdf> 10nF ___ Source: Digikey <https://www.digikey.de/products/en?keywords=490-4781-1-ND> ; Datasheet <https://search.murata.co.jp/Ceramy/image/img/A01X/G101/ENG/GCM188R72A103KA37-01.pdf> 22nF ___ Source: Digikey <https://www.digikey.de/products/en?keywords=490-4782-1-ND> ; Datasheet <https://www.murata.com/-/media/webrenewal/support/library/catalog/products/capacitor/ceramiccapacitor/c03e.ashx?la=en-us&cvid=20200707014404000000> package: C0805 : 10µF ___ Source: Digikey <https://www.digikey.de/products/en?keywords=490-14361-1-ND> ; Datasheet <https://search.murata.co.jp/Ceramy/image/img/A01X/G101/ENG/GCM21BR70J106KE22-01.pdf> 2.2µF ___ Source: Digikey <https://www.digikey.de/products/en?keywords=490-4786-1-ND> ; Datasheet <https://search.murata.co.jp/Ceramy/image/img/A01X/G101/ENG/GCM21BR71C225KA64-01.pdf> 470nF ___ Source: Digikey <https://www.digikey.de/products/en?keywords=490-4788-1-ND> ; Datasheet <https://search.murata.co.jp/Ceramy/image/img/A01X/G101/ENG/GCM21BR71H474KA55-01.pdf> 100nF ___ Source: Digikey <https://www.digikey.de/products/en?keywords=490-8051-1-ND> ; Datasheet <https://search.murata.co.jp/Ceramy/image/img/A01X/G101/ENG/GCM21BR72A104KA37-01.pdf> package: C0805K : 220nF ___ Source: Digikey <https://www.digikey.de/products/en?keywords=490-8306-1-ND> ; Datasheet <https://search.murata.co.jp/Ceramy/image/img/A01X/G101/ENG/GRM21AR72A224KAC5-01.pdf> package: C1206 : 10µF ___ Source: Digikey <https://www.digikey.de/products/en?keywords=490-14746-1-ND> ; Datasheet <https://search.murata.co.jp/Ceramy/image/img/A01X/G101/ENG/GCM31CR71C106KA64-01.pdf> 2.2µF ___ Source: Digikey <https://www.digikey.de/products/en?keywords=490-11169-1-ND> ; Datasheet <https://search.murata.co.jp/Ceramy/image/img/A01X/G101/ENG/GCM31CR71H225KA55-01.pdf> package: C1206 : 2220nF ___ Source: Digikey <https://www.digikey.de/products/en?keywords=490-4975-1-ND> ; Datasheet <https://search.murata.co.jp/Ceramy/image/img/A01X/G101/ENG/GCM31MR72A224KA37-01.pdf>; CAPACITANCE: 10uF; DIGIKEY: 490-14746-1-ND; TOLERANCE: ±10%; VOLTAGE: 16V
C5 C6 = msrm:GCM?R7*: Multilayer Ceramic Capacitors Chip Multilayer Ceramic Capacitors for Automotive –55 to 125°C Sources: Catalogue <https://www.murata.com/~/media/webrenewal/support/library/catalog/products/capacitor/mlcc/c03e.ashx?la=en-us> Part Numbering <https://search.murata.co.jp/Ceramy/image/img/A01X/partnumbering_e_02.pdf> package: C0201 : 470pF ___ Source: Digikey <https://www.digikey.de/products/en?keywords=490-17744-1-ND> ; Datasheet <https://search.murata.co.jp/Ceramy/image/img/A01X/G101/ENG/GCM033R71E471KA03-01.pdf> package: C0402 : 100nF ___ Source: Digikey <https://www.digikey.de/products/en?keywords=490-16433-1-ND> ; Datasheet <https://search.murata.co.jp/Ceramy/image/img/A01X/G101/ENG/GCM155R71C104JA55-01.pdf> 220nF ___ Source: Digikey <https://www.digikey.de/products/en?keywords=490-10671-1-ND> ; Datasheet <https://www.murata.com/-/media/webrenewal/support/library/catalog/products/capacitor/ceramiccapacitor/c03e.ashx?la=en-us&cvid=20200707014404000000> 6.8nF ___ Source: Digikey <https://www.digikey.de/products/en?keywords=490-12655-1-ND> ; Datasheet <https://search.murata.co.jp/Ceramy/image/img/A01X/G101/ENG/GCM155R71C683KA55-01.pdf> 10nF ___ Source: Digikey <https://www.digikey.de/products/en?keywords=490-6043-1-ND> ; Datasheet <https://search.murata.co.jp/Ceramy/image/img/A01X/G101/ENG/GCM155R71E103KA37-01.pdf> 22nF ___ Source: Digikey <https://www.digikey.de/products/en?keywords=490-6044-1-ND> ; Datasheet <https://search.murata.co.jp/Ceramy/image/img/A01X/G101/ENG/GCM155R71E223KA55-01.pdf> 470pF ___ Source: Digikey <https://www.digikey.de/products/en?keywords=490-4913-1-ND> ; Datasheet <https://search.murata.co.jp/Ceramy/image/img/A01X/G101/ENG/GCM155R71H471KA37-01.pdf> package: C0603 : 1µF ___ Source: Digikey <https://www.digikey.de/products/en?keywords=490-5241-1-ND> ; Datasheet <https://www.murata.com/-/media/webrenewal/support/library/catalog/products/capacitor/ceramiccapacitor/c03e.ashx?la=en-us&cvid=20200707014404000000> 470nF ___ Source: Digikey <https://www.digikey.de/products/en?keywords=490-12589-1-ND> ; Datasheet <https://search.murata.co.jp/Ceramy/image/img/A01X/G101/ENG/GCM188R71C474KA55-01.pdf> 10nF ___ Source: Digikey <https://www.digikey.de/products/en?keywords=490-4781-1-ND> ; Datasheet <https://search.murata.co.jp/Ceramy/image/img/A01X/G101/ENG/GCM188R72A103KA37-01.pdf> 22nF ___ Source: Digikey <https://www.digikey.de/products/en?keywords=490-4782-1-ND> ; Datasheet <https://www.murata.com/-/media/webrenewal/support/library/catalog/products/capacitor/ceramiccapacitor/c03e.ashx?la=en-us&cvid=20200707014404000000> package: C0805 : 10µF ___ Source: Digikey <https://www.digikey.de/products/en?keywords=490-14361-1-ND> ; Datasheet <https://search.murata.co.jp/Ceramy/image/img/A01X/G101/ENG/GCM21BR70J106KE22-01.pdf> 2.2µF ___ Source: Digikey <https://www.digikey.de/products/en?keywords=490-4786-1-ND> ; Datasheet <https://search.murata.co.jp/Ceramy/image/img/A01X/G101/ENG/GCM21BR71C225KA64-01.pdf> 470nF ___ Source: Digikey <https://www.digikey.de/products/en?keywords=490-4788-1-ND> ; Datasheet <https://search.murata.co.jp/Ceramy/image/img/A01X/G101/ENG/GCM21BR71H474KA55-01.pdf> 100nF ___ Source: Digikey <https://www.digikey.de/products/en?keywords=490-8051-1-ND> ; Datasheet <https://search.murata.co.jp/Ceramy/image/img/A01X/G101/ENG/GCM21BR72A104KA37-01.pdf> package: C0805K : 220nF ___ Source: Digikey <https://www.digikey.de/products/en?keywords=490-8306-1-ND> ; Datasheet <https://search.murata.co.jp/Ceramy/image/img/A01X/G101/ENG/GRM21AR72A224KAC5-01.pdf> package: C1206 : 10µF ___ Source: Digikey <https://www.digikey.de/products/en?keywords=490-14746-1-ND> ; Datasheet <https://search.murata.co.jp/Ceramy/image/img/A01X/G101/ENG/GCM31CR71C106KA64-01.pdf> 2.2µF ___ Source: Digikey <https://www.digikey.de/products/en?keywords=490-11169-1-ND> ; Datasheet <https://search.murata.co.jp/Ceramy/image/img/A01X/G101/ENG/GCM31CR71H225KA55-01.pdf> package: C1206 : 2220nF ___ Source: Digikey <https://www.digikey.de/products/en?keywords=490-4975-1-ND> ; Datasheet <https://search.murata.co.jp/Ceramy/image/img/A01X/G101/ENG/GCM31MR72A224KA37-01.pdf>; CAPACITANCE: 10uF; DIGIKEY: 490-14361-1-ND; TOLERANCE: ±10%; VOLTAGE: 6.3V
C7-C12 = msrm:GCM?R7*: Multilayer Ceramic Capacitors Chip Multilayer Ceramic Capacitors for Automotive –55 to 125°C Sources: Catalogue <https://www.murata.com/~/media/webrenewal/support/library/catalog/products/capacitor/mlcc/c03e.ashx?la=en-us> Part Numbering <https://search.murata.co.jp/Ceramy/image/img/A01X/partnumbering_e_02.pdf> package: C0201 : 470pF ___ Source: Digikey <https://www.digikey.de/products/en?keywords=490-17744-1-ND> ; Datasheet <https://search.murata.co.jp/Ceramy/image/img/A01X/G101/ENG/GCM033R71E471KA03-01.pdf> package: C0402 : 100nF ___ Source: Digikey <https://www.digikey.de/products/en?keywords=490-16433-1-ND> ; Datasheet <https://search.murata.co.jp/Ceramy/image/img/A01X/G101/ENG/GCM155R71C104JA55-01.pdf> 220nF ___ Source: Digikey <https://www.digikey.de/products/en?keywords=490-10671-1-ND> ; Datasheet <https://www.murata.com/-/media/webrenewal/support/library/catalog/products/capacitor/ceramiccapacitor/c03e.ashx?la=en-us&cvid=20200707014404000000> 6.8nF ___ Source: Digikey <https://www.digikey.de/products/en?keywords=490-12655-1-ND> ; Datasheet <https://search.murata.co.jp/Ceramy/image/img/A01X/G101/ENG/GCM155R71C683KA55-01.pdf> 10nF ___ Source: Digikey <https://www.digikey.de/products/en?keywords=490-6043-1-ND> ; Datasheet <https://search.murata.co.jp/Ceramy/image/img/A01X/G101/ENG/GCM155R71E103KA37-01.pdf> 22nF ___ Source: Digikey <https://www.digikey.de/products/en?keywords=490-6044-1-ND> ; Datasheet <https://search.murata.co.jp/Ceramy/image/img/A01X/G101/ENG/GCM155R71E223KA55-01.pdf> 470pF ___ Source: Digikey <https://www.digikey.de/products/en?keywords=490-4913-1-ND> ; Datasheet <https://search.murata.co.jp/Ceramy/image/img/A01X/G101/ENG/GCM155R71H471KA37-01.pdf> package: C0603 : 1µF ___ Source: Digikey <https://www.digikey.de/products/en?keywords=490-5241-1-ND> ; Datasheet <https://www.murata.com/-/media/webrenewal/support/library/catalog/products/capacitor/ceramiccapacitor/c03e.ashx?la=en-us&cvid=20200707014404000000> 470nF ___ Source: Digikey <https://www.digikey.de/products/en?keywords=490-12589-1-ND> ; Datasheet <https://search.murata.co.jp/Ceramy/image/img/A01X/G101/ENG/GCM188R71C474KA55-01.pdf> 10nF ___ Source: Digikey <https://www.digikey.de/products/en?keywords=490-4781-1-ND> ; Datasheet <https://search.murata.co.jp/Ceramy/image/img/A01X/G101/ENG/GCM188R72A103KA37-01.pdf> 22nF ___ Source: Digikey <https://www.digikey.de/products/en?keywords=490-4782-1-ND> ; Datasheet <https://www.murata.com/-/media/webrenewal/support/library/catalog/products/capacitor/ceramiccapacitor/c03e.ashx?la=en-us&cvid=20200707014404000000> package: C0805 : 10µF ___ Source: Digikey <https://www.digikey.de/products/en?keywords=490-14361-1-ND> ; Datasheet <https://search.murata.co.jp/Ceramy/image/img/A01X/G101/ENG/GCM21BR70J106KE22-01.pdf> 2.2µF ___ Source: Digikey <https://www.digikey.de/products/en?keywords=490-4786-1-ND> ; Datasheet <https://search.murata.co.jp/Ceramy/image/img/A01X/G101/ENG/GCM21BR71C225KA64-01.pdf> 470nF ___ Source: Digikey <https://www.digikey.de/products/en?keywords=490-4788-1-ND> ; Datasheet <https://search.murata.co.jp/Ceramy/image/img/A01X/G101/ENG/GCM21BR71H474KA55-01.pdf> 100nF ___ Source: Digikey <https://www.digikey.de/products/en?keywords=490-8051-1-ND> ; Datasheet <https://search.murata.co.jp/Ceramy/image/img/A01X/G101/ENG/GCM21BR72A104KA37-01.pdf> package: C0805K : 220nF ___ Source: Digikey <https://www.digikey.de/products/en?keywords=490-8306-1-ND> ; Datasheet <https://search.murata.co.jp/Ceramy/image/img/A01X/G101/ENG/GRM21AR72A224KAC5-01.pdf> package: C1206 : 10µF ___ Source: Digikey <https://www.digikey.de/products/en?keywords=490-14746-1-ND> ; Datasheet <https://search.murata.co.jp/Ceramy/image/img/A01X/G101/ENG/GCM31CR71C106KA64-01.pdf> 2.2µF ___ Source: Digikey <https://www.digikey.de/products/en?keywords=490-11169-1-ND> ; Datasheet <https://search.murata.co.jp/Ceramy/image/img/A01X/G101/ENG/GCM31CR71H225KA55-01.pdf> package: C1206 : 2220nF ___ Source: Digikey <https://www.digikey.de/products/en?keywords=490-4975-1-ND> ; Datasheet <https://search.murata.co.jp/Ceramy/image/img/A01X/G101/ENG/GCM31MR72A224KA37-01.pdf>; CAPACITANCE: 100nF; DIGIKEY: 490-16433-1-ND; TOLERANCE: ±5%; VOLTAGE: 16V
C22 C23 = msrm:GCM?5C*: Multilayer Ceramic Capacitors Chip Multilayer Ceramic Capacitors for Automotive -55°C to 125°C Part Numbering <https://search.murata.co.jp/Ceramy/image/img/A01X/partnumbering_e_02.pdf> package: C0402 : 8.2pF ___ Source: Digikey <https://www.digikey.de/products/en?keywords=490-14426-6-ND> ; Datasheet <https://search.murata.co.jp/Ceramy/image/img/A01X/G101/ENG/GCM1555C1H8R2BA16-01.pdf> 10pF ___ Source: Digikey <https://www.digikey.de/products/en?keywords=490-10668-1-ND> ; Datasheet <https://www.murata.com/-/media/webrenewal/support/library/catalog/products/capacitor/ceramiccapacitor/c03e.ashx?la=en-us&cvid=20200707014404000000> 100pF___ Source: Digikey <https://www.digikey.de/products/en?keywords=490-10669-1-ND> ; Datasheet <https://www.murata.com/-/media/webrenewal/support/library/catalog/products/capacitor/ceramiccapacitor/c03e.ashx?la=en-us&cvid=20200707014404000000> 1000pF ___ Source: Digikey <https://www.digikey.de/products/en?keywords=490-16461-1-ND> ; Datasheet <https://search.murata.co.jp/Ceramy/image/img/A01X/G101/ENG/GCM1555C1H102FA16-01.pdf> 15pF_1% ___ Source: Digikey <https://www.digikey.de/products/en?keywords=490-14350-1-ND> ; Datasheet <https://search.murata.co.jp/Ceramy/image/img/A01X/G101/ENG/GCM1555C1H150FA16-01.pdf> 15pF_5% ___ Source: Digikey <https://www.digikey.de/products/en?keywords=490-11147-1-ND> ; Datasheet <https://www.murata.com/-/media/webrenewal/support/library/catalog/products/capacitor/ceramiccapacitor/c03e.ashx?la=en-us&cvid=20200707014404000000> 18pF ___ Source: Digikey <https://www.digikey.de/products/en?keywords=490-12650-1-ND> ; Datasheet <https://www.murata.com/-/media/webrenewal/support/library/catalog/products/capacitor/ceramiccapacitor/c03e.ashx?la=en-us&cvid=20200707014404000000> 22pF ___ Source: Digikey <https://www.digikey.de/products/en?keywords=490-9648-1-ND> ; Datasheet <https://search.murata.co.jp/Ceramy/image/img/A01X/G101/ENG/GCM1555C1H220JA16-01.pdf> 51pF ___ Source: Digikey <https://www.digikey.de/products/en?keywords=490-5944-1-ND> ; Datasheet <https://search.murata.co.jp/Ceramy/image/img/A01X/G101/ENG/GRM1555C1H510JA01-01.pdf> 680pF ___ Source: Digikey <https://www.digikey.de/products/en?keywords=490-16439-1-ND> ; Datasheet <https://search.murata.co.jp/Ceramy/image/img/A01X/G101/ENG/GCM1555C1H681FA16-01.pdf>; CAPACITANCE: 15pF; DIGIKEY: 490-14350-1-ND; TOLERANCE: ±1%; VOLTAGE: 50V
D1 = msrm:QBLP595-: LED 0402 SMD, 2V package: 0402 : Yellow-Green ___ Source: Digikey <https://www.digikey.de/product-detail/en/qt-brightek-qtb/QBLP595-AG/1516-1218-1-ND/6201915> ; Datasheet <http://www.qt-brightek.com/datasheet/QBLP595%20Series.pdf> Blue ___ Source: Digikey <https://www.digikey.de/product-detail/en/qt-brightek-qtb/QBLP595-IB/1516-1215-1-ND/6201912> ; Datasheet <http://www.qt-brightek.com/datasheet/QBLP595%20Series.pdf> Green ___ Source: Digikey <https://www.digikey.de/product-detail/en/qt-brightek-qtb/QBLP595-IG/1516-1216-1-ND/6201913> ; Datasheet <http://www.qt-brightek.com/datasheet/QBLP595%20Series.pdf> Orange ___ Source: Digikey <https://www.digikey.de/product-detail/en/qt-brightek-qtb/QBLP595-O/1516-1220-1-ND/6201917> ; Datasheet <http://www.qt-brightek.com/datasheet/QBLP595%20Series.pdf> Red ___ Source: Digikey <https://www.digikey.de/product-detail/en/qt-brightek-qtb/QBLP595-R/1516-1217-1-ND/6201914> ; Datasheet <http://www.qt-brightek.com/datasheet/QBLP595%20Series.pdf> Yellow ___ Source: Digikey <https://www.digikey.de/product-detail/en/qt-brightek-qtb/QBLP595-Y/1516-1219-1-ND/6201916> ; Datasheet <http://www.qt-brightek.com/datasheet/QBLP595%20Series.pdf>; COLOR: Blue; DIGIKEY: 1516-1215-1-ND
D2 = msrm:QBLP595-: LED 0402 SMD, 2V package: 0402 : Yellow-Green ___ Source: Digikey <https://www.digikey.de/product-detail/en/qt-brightek-qtb/QBLP595-AG/1516-1218-1-ND/6201915> ; Datasheet <http://www.qt-brightek.com/datasheet/QBLP595%20Series.pdf> Blue ___ Source: Digikey <https://www.digikey.de/product-detail/en/qt-brightek-qtb/QBLP595-IB/1516-1215-1-ND/6201912> ; Datasheet <http://www.qt-brightek.com/datasheet/QBLP595%20Series.pdf> Green ___ Source: Digikey <https://www.digikey.de/product-detail/en/qt-brightek-qtb/QBLP595-IG/1516-1216-1-ND/6201913> ; Datasheet <http://www.qt-brightek.com/datasheet/QBLP595%20Series.pdf> Orange ___ Source: Digikey <https://www.digikey.de/product-detail/en/qt-brightek-qtb/QBLP595-O/1516-1220-1-ND/6201917> ; Datasheet <http://www.qt-brightek.com/datasheet/QBLP595%20Series.pdf> Red ___ Source: Digikey <https://www.digikey.de/product-detail/en/qt-brightek-qtb/QBLP595-R/1516-1217-1-ND/6201914> ; Datasheet <http://www.qt-brightek.com/datasheet/QBLP595%20Series.pdf> Yellow ___ Source: Digikey <https://www.digikey.de/product-detail/en/qt-brightek-qtb/QBLP595-Y/1516-1219-1-ND/6201916> ; Datasheet <http://www.qt-brightek.com/datasheet/QBLP595%20Series.pdf>; COLOR: Orange; DIGIKEY: 1516-1220-1-ND
D3 = msrm:QBLP595-: LED 0402 SMD, 2V package: 0402 : Yellow-Green ___ Source: Digikey <https://www.digikey.de/product-detail/en/qt-brightek-qtb/QBLP595-AG/1516-1218-1-ND/6201915> ; Datasheet <http://www.qt-brightek.com/datasheet/QBLP595%20Series.pdf> Blue ___ Source: Digikey <https://www.digikey.de/product-detail/en/qt-brightek-qtb/QBLP595-IB/1516-1215-1-ND/6201912> ; Datasheet <http://www.qt-brightek.com/datasheet/QBLP595%20Series.pdf> Green ___ Source: Digikey <https://www.digikey.de/product-detail/en/qt-brightek-qtb/QBLP595-IG/1516-1216-1-ND/6201913> ; Datasheet <http://www.qt-brightek.com/datasheet/QBLP595%20Series.pdf> Orange ___ Source: Digikey <https://www.digikey.de/product-detail/en/qt-brightek-qtb/QBLP595-O/1516-1220-1-ND/6201917> ; Datasheet <http://www.qt-brightek.com/datasheet/QBLP595%20Series.pdf> Red ___ Source: Digikey <https://www.digikey.de/product-detail/en/qt-brightek-qtb/QBLP595-R/1516-1217-1-ND/6201914> ; Datasheet <http://www.qt-brightek.com/datasheet/QBLP595%20Series.pdf> Yellow ___ Source: Digikey <https://www.digikey.de/product-detail/en/qt-brightek-qtb/QBLP595-Y/1516-1219-1-ND/6201916> ; Datasheet <http://www.qt-brightek.com/datasheet/QBLP595%20Series.pdf>; COLOR: Yellow; DIGIKEY: 1516-1219-1-ND
IC2 = msrm:ATSAMD51G: Atmel C21 32bit ARM Cortex-M0 microcontroller. Pins 64 GPIO 52 TC 5 TCC 3 DMA 12 USB No CAN 2 CCL 4 SERCOM 6 I2S 0 DIVAS Yes ADCch 20 ADC 2 ADCSDch 3 AC 4 DAC 1 TSENS 1 RTC 1 EIC 16 PTC 32 FREQM Yes MAX_F 48MHz EVENTS 12 WDT Yes SWDI Yes package: QFN48 : D51G18A-MUTCT ___ Source: Digikey <https://www.digikey.de/products/de?keywords=ATSAMD51G18A-MUTCT-ND> ; Datasheet <http://www.microchip.com/mymicrochip/filehandler.aspx?ddocname=en599585> D51G19A-MU ______ Source: Digikey <https://www.digikey.de/products/de?keywords=ATSAMD51G19A-MU-ND> ; Datasheet <http://www.microchip.com/mymicrochip/filehandler.aspx?ddocname=en599585>; DIGIKEY: ATSAMD51G18A-MUTCT-ND; FLASH: 256KB; SRAM: 128KB
L1 = msrm:BLM?EG*1D: Murata's SMD Ferrite Bead BLM18EG Series Productdata: Part Numbering <https://www.murata.com/en-us/products/productdata/8796733767710/S0580E.pdf> package: 0402 : 220 Ohms @ 100MHz ___ Source: Digikey <https://www.digikey.de/products/en?keywords=490-17345-1-ND> ; Datasheet <https://www.murata.com/en-us/products/productdata/8799741607966/QNFA9136.pdf> package: 0603 : 100 Ohms @ 100MHz ___ Source: Digikey <https://www.digikey.de/products/en?keywords=490-5978-1-ND> ; Datasheet <https://www.murata.com/en-us/products/productdata/8796747366430/ENFA0021.pdf> 120 Ohms @ 100MHz___ Source: Digikey <https://www.digikey.de/products/en?keywords=490-3991-1-ND> ; Datasheet <https://www.murata.com/en-us/products/productdata/8796747366430/ENFA0021.pdf> 220 Ohms @ 100MHz ___ Source: Digikey <https://www.digikey.de/products/en?keywords=490-3992-6-ND> ; Datasheet <https://www.murata.com/en-us/products/productdata/8796747366430/ENFA0021.pdf> 220 Ohms @ 100MHz ___ Source: Digikey <https://www.digikey.de/products/en?keywords=490-5979-1-ND> ; Datasheet <https://www.murata.com/en-us/products/productdata/8796747366430/ENFA0021.pdf> 330 Ohms @ 100MHz ___ Source: Digikey <https://www.digikey.de/products/en?keywords=490-5913-1-ND> ; Datasheet <https://www.murata.com/en-us/products/productdata/8796747366430/ENFA0021.pdf> 390 Ohms @ 100MHz ___ Source: Digikey <https://www.digikey.de/products/en?keywords=490-5980-2-ND> ; Datasheet <https://www.murata.com/en-us/products/productdata/8796747366430/ENFA0021.pdf> 470 Ohms @ 100MHz ___ Source: Digikey <https://www.digikey.de/products/en?keywords=490-3993-1-ND> ; Datasheet <https://www.murata.com/en-us/products/productdata/8796747366430/ENFA0021.pdf> 600 Ohms @ 100MHz ___ Source: Digikey <https://www.digikey.de/products/en?keywords=490-3994-1-ND> ; Datasheet <https://www.murata.com/en-us/products/productdata/8796747366430/ENFA0021.pdf>; DC_RES: 50mOhm; DIGIKEY: 490-3992-6-ND; IMPEDANCE-FREQUENCY: 220 Ohms @ 100MHz
R1 R2 R4 = msrm:RT?BRD07*L: SMD-Resistor ±0.1% 0.063W, 1/16W Chip Resistor 0402 (1005 Metric) Thin Film package: R0402 : 1k ___ Source: Digikey <https://www.digikey.de/products/en?keywords=%20YAG1386CT-ND> ; Datasheet <https://www.yageo.com/upload/media/product/productsearch/datasheet/rchip/PYu-RT_1-to-0.01_RoHS_L_12.pdf> 2k05 ___ Source: Digikey <https://www.digikey.de/products/en?keywords=YAG1400CT-ND> ; Datasheet <https://www.yageo.com/upload/media/product/productsearch/datasheet/rchip/PYu-RT_1-to-0.01_RoHS_L_12.pdf> 3k2 ___ Source: Digikey <YAG4255CT-ND> ; Datasheet <https://www.yageo.com/upload/media/product/productsearch/datasheet/rchip/PYu-RT_1-to-0.01_RoHS_L_12.pdf> 4k99 ___ Source: Digikey <https://www.digikey.de/products/en?keywords=YAG1447CT-ND> ; Datasheet <https://www.yageo.com/upload/media/product/productsearch/datasheet/rchip/PYu-RT_1-to-0.01_RoHS_L_12.pdf> 10k ___ Source: Digikey <https://www.digikey.de/products/en?keywords=%E2%80%8EA119918CT-ND%E2%80%8E> ; Datasheet <https://www.yageo.com/upload/media/product/productsearch/datasheet/rchip/PYu-RT_1-to-0.01_RoHS_L_12.pdf> 12k ___ Source: Digikey <https://www.digikey.de/products/en?keywords=YAG1354CT-ND> ; Datasheet <https://www.yageo.com/upload/media/product/productsearch/datasheet/rchip/PYu-RT_1-to-0.01_RoHS_L_12.pdf> 22k ___ Source: Digikey <https://www.digikey.de/products/en?keywords=YAG4210CT-ND> ; Datasheet <https://www.yageo.com/upload/media/product/productsearch/datasheet/rchip/PYu-RT_1-to-0.01_RoHS_L_12.pdf> 56k ___ Source: Digikey <https://www.digikey.de/products/en?keywords=YAG1454CT-ND%20> ; Datasheet <https://www.yageo.com/upload/media/product/productsearch/datasheet/rchip/PYu-RT_1-to-0.01_RoHS_L_12.pdf> 60k4 ___ Source: Digikey <https://www.digikey.de/products/en?keywords=YAG1461CT-ND> ; Datasheet <https://www.yageo.com/upload/media/product/productsearch/datasheet/rchip/PYu-RT_1-to-0.01_RoHS_L_12.pdf> 270R ___ Source: Digikey <https://www.digikey.de/products/en?keywords=YAG1396CT-ND> ; Datasheet <https://www.yageo.com/upload/media/product/productsearch/datasheet/rchip/PYu-RT_1-to-0.01_RoHS_L_12.pdf>; DIGIKEY: ‎A119918CT-ND‎; RVALUE: 10k; SPICEPREFIX: R
R5 = msrm:RT?FRE07*L: SMD RESISTOR ± 1% Tol, Paper/PE taping reel, 50 ppm/°C, 7 inch dia. Reel Datasheet <http://www.yageo.com/documents/recent/PYu-RT_1-to-0.01_RoHS_L_11.pdf> package: 0201 : 0R ___ Source: Digikey <https://www.digikey.de/products/en?keywords=311-0.0MCT-ND> 1k ___ Source: Digikey <https://www.digikey.de/products/en?keywords=RT0201FRE071KL-ND> 10k ___ Source: Digikey <https://www.digikey.de/products/en?keywords=RT0201FRE0710KL-ND> 100 ___ Source: Digikey <https://www.digikey.de/products/en?keywords=RT0201FRE07100RL-ND> 330 ___ Source: Digikey <https://www.digikey.de/products/en?keywords=RT0201FRE07330RL-ND> package: 0402 : 0R ___ Source: Digikey <https://www.digikey.de/products/en?keywords=311-0.0LRCT-ND> 1k ___ Source: Digikey <https://www.digikey.de/products/en?keywords=%20YAG1234CT-ND> 2k2 ___ Source: Digikey <https://www.digikey.de/products/en?keywords=RT0402FRE072K2L-ND> 2k ___ Source: Digikey <https://www.digikey.de/products/en?keywords=YAG3345CT-ND> 4k7 ___ Source: Digikey <https://www.digikey.de/products/en?keywords=YAG3347CT-ND%20> 10k ___ Source: Digikey <https://www.digikey.de/products/en?keywords=YAG1233CT-ND> 12k1 ___ Source: Digikey <https://www.digikey.de/products/en?keywords=RT0402FRE0712K1L-ND> 49R9 ___ Source: Digikey <https://www.digikey.de/products/en?keywords=YAG3346CT-ND> 56k ___ Source: Digikey <https://www.digikey.de/products/en?keywords=RT0402FRE0756K2L-ND> 100k ___ Source: Digikey <https://www.digikey.de/products/en?keywords=YAG2307CT-ND> 100 ___ Source: Digikey <https://www.digikey.de/products/en?keywords=YAG3342CT-ND> 150 ___ Source: Digikey <https://www.digikey.de/product-detail/en/yageo/RT0402FRE07150RL/13-RT0402FRE07150RLCT-ND/12705162> 300 ___ Source: Digikey <https://www.digikey.de/products/en?keywords=RT0402FRE07300RL-ND> package: 0603 : 0R ___ Source: Digikey <https://www.digikey.de/products/en?keywords=311-0.0HRCT-ND> 1k ___ Source: Digikey <https://www.digikey.de/products/en?keywords=YAG2323CT-ND> 10k ___ Source: Digikey <https://www.digikey.de/products/en?keywords=YAG2321CT-ND> 100k ___ Source: Digikey <https://www.digikey.de/products/en?keywords=YAG2319CT-ND> 100 ___ Source: Digikey <https://www.digikey.de/products/en?keywords=YAG2320CT-ND> 300 ___ Source: Digikey <https://www.digikey.de/products/en?keywords=RT0603FRE07300RL-ND> 330 ___ Source: Digikey <https://www.digikey.de/products/en?keywords=YAG5957CT-ND>; DIGIKEY: RT0402FRE07300RL-ND; RVALUE: 300; SPICEPREFIX: R
R6 = msrm:RT?FRE07*L: SMD RESISTOR ± 1% Tol, Paper/PE taping reel, 50 ppm/°C, 7 inch dia. Reel Datasheet <http://www.yageo.com/documents/recent/PYu-RT_1-to-0.01_RoHS_L_11.pdf> package: 0201 : 0R ___ Source: Digikey <https://www.digikey.de/products/en?keywords=311-0.0MCT-ND> 1k ___ Source: Digikey <https://www.digikey.de/products/en?keywords=RT0201FRE071KL-ND> 10k ___ Source: Digikey <https://www.digikey.de/products/en?keywords=RT0201FRE0710KL-ND> 100 ___ Source: Digikey <https://www.digikey.de/products/en?keywords=RT0201FRE07100RL-ND> 330 ___ Source: Digikey <https://www.digikey.de/products/en?keywords=RT0201FRE07330RL-ND> package: 0402 : 0R ___ Source: Digikey <https://www.digikey.de/products/en?keywords=311-0.0LRCT-ND> 1k ___ Source: Digikey <https://www.digikey.de/products/en?keywords=%20YAG1234CT-ND> 2k2 ___ Source: Digikey <https://www.digikey.de/products/en?keywords=RT0402FRE072K2L-ND> 2k ___ Source: Digikey <https://www.digikey.de/products/en?keywords=YAG3345CT-ND> 4k7 ___ Source: Digikey <https://www.digikey.de/products/en?keywords=YAG3347CT-ND%20> 10k ___ Source: Digikey <https://www.digikey.de/products/en?keywords=YAG1233CT-ND> 12k1 ___ Source: Digikey <https://www.digikey.de/products/en?keywords=RT0402FRE0712K1L-ND> 49R9 ___ Source: Digikey <https://www.digikey.de/products/en?keywords=YAG3346CT-ND> 56k ___ Source: Digikey <https://www.digikey.de/products/en?keywords=RT0402FRE0756K2L-ND> 100k ___ Source: Digikey <https://www.digikey.de/products/en?keywords=YAG2307CT-ND> 100 ___ Source: Digikey <https://www.digikey.de/products/en?keywords=YAG3342CT-ND> 150 ___ Source: Digikey <https://www.digikey.de/product-detail/en/yageo/RT0402FRE07150RL/13-RT0402FRE07150RLCT-ND/12705162> 300 ___ Source: Digikey <https://www.digikey.de/products/en?keywords=RT0402FRE07300RL-ND> package: 0603 : 0R ___ Source: Digikey <https://www.digikey.de/products/en?keywords=311-0.0HRCT-ND> 1k ___ Source: Digikey <https://www.digikey.de/products/en?keywords=YAG2323CT-ND> 10k ___ Source: Digikey <https://www.digikey.de/products/en?keywords=YAG2321CT-ND> 100k ___ Source: Digikey <https://www.digikey.de/products/en?keywords=YAG2319CT-ND> 100 ___ Source: Digikey <https://www.digikey.de/products/en?keywords=YAG2320CT-ND> 300 ___ Source: Digikey <https://www.digikey.de/products/en?keywords=RT0603FRE07300RL-ND> 330 ___ Source: Digikey <https://www.digikey.de/products/en?keywords=YAG5957CT-ND>; DIGIKEY: YAG1233CT-ND; RVALUE: 10k; SPICEPREFIX: R
R7 = msrm:RT?FRE07*L: SMD RESISTOR ± 1% Tol, Paper/PE taping reel, 50 ppm/°C, 7 inch dia. Reel Datasheet <http://www.yageo.com/documents/recent/PYu-RT_1-to-0.01_RoHS_L_11.pdf> package: 0201 : 0R ___ Source: Digikey <https://www.digikey.de/products/en?keywords=311-0.0MCT-ND> 1k ___ Source: Digikey <https://www.digikey.de/products/en?keywords=RT0201FRE071KL-ND> 10k ___ Source: Digikey <https://www.digikey.de/products/en?keywords=RT0201FRE0710KL-ND> 100 ___ Source: Digikey <https://www.digikey.de/products/en?keywords=RT0201FRE07100RL-ND> 330 ___ Source: Digikey <https://www.digikey.de/products/en?keywords=RT0201FRE07330RL-ND> package: 0402 : 0R ___ Source: Digikey <https://www.digikey.de/products/en?keywords=311-0.0LRCT-ND> 1k ___ Source: Digikey <https://www.digikey.de/products/en?keywords=%20YAG1234CT-ND> 2k2 ___ Source: Digikey <https://www.digikey.de/products/en?keywords=RT0402FRE072K2L-ND> 2k ___ Source: Digikey <https://www.digikey.de/products/en?keywords=YAG3345CT-ND> 4k7 ___ Source: Digikey <https://www.digikey.de/products/en?keywords=YAG3347CT-ND%20> 10k ___ Source: Digikey <https://www.digikey.de/products/en?keywords=YAG1233CT-ND> 12k1 ___ Source: Digikey <https://www.digikey.de/products/en?keywords=RT0402FRE0712K1L-ND> 49R9 ___ Source: Digikey <https://www.digikey.de/products/en?keywords=YAG3346CT-ND> 56k ___ Source: Digikey <https://www.digikey.de/products/en?keywords=RT0402FRE0756K2L-ND> 100k ___ Source: Digikey <https://www.digikey.de/products/en?keywords=YAG2307CT-ND> 100 ___ Source: Digikey <https://www.digikey.de/products/en?keywords=YAG3342CT-ND> 150 ___ Source: Digikey <https://www.digikey.de/product-detail/en/yageo/RT0402FRE07150RL/13-RT0402FRE07150RLCT-ND/12705162> 300 ___ Source: Digikey <https://www.digikey.de/products/en?keywords=RT0402FRE07300RL-ND> package: 0603 : 0R ___ Source: Digikey <https://www.digikey.de/products/en?keywords=311-0.0HRCT-ND> 1k ___ Source: Digikey <https://www.digikey.de/products/en?keywords=YAG2323CT-ND> 10k ___ Source: Digikey <https://www.digikey.de/products/en?keywords=YAG2321CT-ND> 100k ___ Source: Digikey <https://www.digikey.de/products/en?keywords=YAG2319CT-ND> 100 ___ Source: Digikey <https://www.digikey.de/products/en?keywords=YAG2320CT-ND> 300 ___ Source: Digikey <https://www.digikey.de/products/en?keywords=RT0603FRE07300RL-ND> 330 ___ Source: Digikey <https://www.digikey.de/products/en?keywords=YAG5957CT-ND>; DIGIKEY: YAG1234CT-ND; RVALUE: 1k; SPICEPREFIX: R
S2 = msrm:USLPT?*TR: Tactile Switch SPST-NO Top Actuated Surface Mount 450-3357-1 ___ Source: Digikey <https://www.digikey.de/products/en?keywords=450-3357-1-ND> ; Datasheet <https://media.digikey.com/pdf/Data%20Sheets/Tyco%20Electronics%20Alcoswitch%20PDFs/USLPT2616_DS.pdf>; DIGIKEY: 450-3357-1-ND; FORCE: 160gf; HEIGHT: 0.55mm; MANUFACTURER_NAME: TE Connectivity; MANUFACTURER_PART_NUMBER: USLPT2616CT2TR; MOUSER_PART_NUMBER: 506-USLPT2616CT2TR
Y2 = msrm:ECS-*?-TR: SMD CRYSTAL Various frequencies, with GND pins Part Numbering <http://www.ecsxtal.com/store/pdf/partnumber4.pdf> package: ECS-33B : XC2845 ___ Source: Digikey <https://www.digikey.de/products/en?keywords=%20XC2845CT-ND> ; Datasheet <https://ecsxtal.com/store/pdf/ECS-33B.pdf> XC2439 ___ Source: Digikey <https://www.digikey.de/products/en?keywords=XC2439CT-ND> ; Datasheet <https://ecsxtal.com/store/pdf/ECS-33B.pdf> XC2458 ___ Source: Digikey <https://www.digikey.de/products/en?keywords=XC2458CT-ND> ; Datasheet <https://ecsxtal.com/store/pdf/ECS-33B.pdf> XC2479 ___ Source: Digikey <https://www.digikey.de/products/en?keywords=XC2479CT-ND> ; Datasheet <https://ecsxtal.com/store/pdf/ECS-33B.pdf> XC2547 ___ Source: Digikey <https://www.digikey.de/products/en?keywords=XC2547CT-ND> ; Datasheet <https://ecsxtal.com/store/pdf/ECS-33B.pdf> package: ECX2236 : XC3046 ___ Source: Digikey <https://www.digikey.de/products/en?keywords=XC3046CT-ND> ; Datasheet <https://ecsxtal.com/store/pdf/ECX-2236B.pdf> XC3048 ___ Source: Digikey <https://www.digikey.de/products/en?keywords=XC3048CT-ND> ; Datasheet <https://ecsxtal.com/store/pdf/ECX-2236B.pdf> XC3051 ___ Source: Digikey <https://www.digikey.de/products/en?keywords=XC3051CT-ND> ; Datasheet <https://ecsxtal.com/store/pdf/ECX-2236B.pdf> XC3093 ___ Source: Digikey <https://www.digikey.de/products/en?keywords=XC3093CT-ND> ; Datasheet <https://ecsxtal.com/store/pdf/ECX-2236B.pdf> XC3053 ___ Source: Digikey <https://www.digikey.de/products/en?keywords=XC3053CT-ND> ; Datasheet <https://ecsxtal.com/store/pdf/ECX-2236B.pdf> XC3052 ___ Source: Digikey <https://www.digikey.de/products/en?keywords=XC3052CT-ND> ; Datasheet <https://ecsxtal.com/store/pdf/ECX-2236B.pdf> XC3054 ___ Source: Digikey <https://www.digikey.de/products/en?keywords=XC3054CT-ND> ; Datasheet <https://ecsxtal.com/store/pdf/ECX-2236B.pdf> XC3057 ___ Source: Digikey <https://www.digikey.de/products/en?keywords=XC3057CT-ND> ; Datasheet <https://ecsxtal.com/store/pdf/ECX-2236B.pdf> XC3058 ___ Source: Digikey <https://www.digikey.de/products/en?keywords=XC3058CT-ND> ; Datasheet <https://ecsxtal.com/store/pdf/ECX-2236B.pdf> XC3060 ___ Source: Digikey <https://www.digikey.de/products/en?keywords=XC3060CT-ND> ; Datasheet <https://ecsxtal.com/store/pdf/ECX-2236B.pdf> XC3059 ___ Source: Digikey <https://www.digikey.de/products/en?keywords=XC3059CT-ND> ; Datasheet <https://ecsxtal.com/store/pdf/ECX-2236B.pdf>; DIGIKEY: XC3057CT-ND; ESR: 40 Ohm; F: 32MHz; F_TOLERANCE: ±10ppm; L_CAPACITANCE: 12pF

## Module AFE_TRQ
Ports: TRQ_P(io) TRQ_N(io) TRQ_ADC(io) +3V3(pwr) GND(pwr)
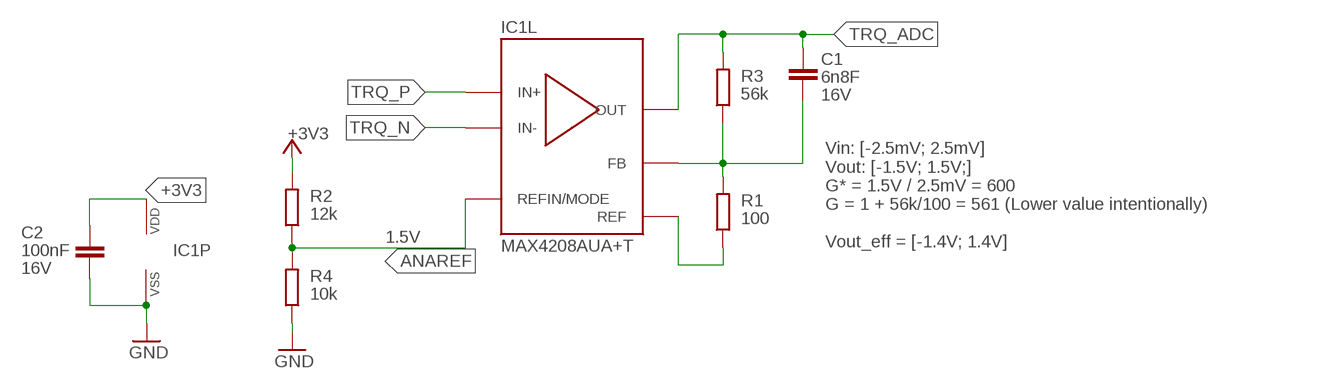
[diagram p5: schematic, module AFE_TRQ, sheet 1]

### Parts
C1  GCM155R71C683KA55  [C0402]
C2  GCM155R71C104JA55  [C0402]
IC1  MAX4208AUA+T  [USOP8]
R1  RT0402FRE07100RL  [R0402]
R2  RT0402BRD0712KL  [R0402]
R3  RT0402FRE0756KL  [R0402]
R4  RT0402BRD0710KL  [R0402]

### Nets
+3V3: C2.1 IC1.8(P:VDD) R2.2
ANAREF: IC1.1(L:REFIN/MODE) R2.1 R4.2
GND: C2.2 IC1.4(P:VSS) R4.1
N$1: IC1.5(L:REF) R1.1
N$4: C1.2 IC1.6(L:FB) R1.2 R3.1
TRQ_ADC: C1.1 IC1.7(L:OUT) R3.2
TRQ_N: IC1.2(L:IN-)
TRQ_P: IC1.3(L:IN+)

### Notes on the sheet
- 1.5V
- Vin: [-2.5mV; 2.5mV]
  Vout: [-1.5V; 1.5V;]
  G* = 1.5V / 2.5mV = 600 
  G = 1 + 56k/100 = 561 (Lower value intentionally)
  
  Vout_eff = [-1.4V; 1.4V]

### Library data of the parts
C1 = msrm:GCM?R7*: Multilayer Ceramic Capacitors Chip Multilayer Ceramic Capacitors for Automotive –55 to 125°C Sources: Catalogue <https://www.murata.com/~/media/webrenewal/support/library/catalog/products/capacitor/mlcc/c03e.ashx?la=en-us> Part Numbering <https://search.murata.co.jp/Ceramy/image/img/A01X/partnumbering_e_02.pdf> package: C0201 : 470pF ___ Source: Digikey <https://www.digikey.de/products/en?keywords=490-17744-1-ND> ; Datasheet <https://search.murata.co.jp/Ceramy/image/img/A01X/G101/ENG/GCM033R71E471KA03-01.pdf> package: C0402 : 100nF ___ Source: Digikey <https://www.digikey.de/products/en?keywords=490-16433-1-ND> ; Datasheet <https://search.murata.co.jp/Ceramy/image/img/A01X/G101/ENG/GCM155R71C104JA55-01.pdf> 220nF ___ Source: Digikey <https://www.digikey.de/products/en?keywords=490-10671-1-ND> ; Datasheet <https://www.murata.com/-/media/webrenewal/support/library/catalog/products/capacitor/ceramiccapacitor/c03e.ashx?la=en-us&cvid=20200707014404000000> 6.8nF ___ Source: Digikey <https://www.digikey.de/products/en?keywords=490-12655-1-ND> ; Datasheet <https://search.murata.co.jp/Ceramy/image/img/A01X/G101/ENG/GCM155R71C683KA55-01.pdf> 10nF ___ Source: Digikey <https://www.digikey.de/products/en?keywords=490-6043-1-ND> ; Datasheet <https://search.murata.co.jp/Ceramy/image/img/A01X/G101/ENG/GCM155R71E103KA37-01.pdf> 22nF ___ Source: Digikey <https://www.digikey.de/products/en?keywords=490-6044-1-ND> ; Datasheet <https://search.murata.co.jp/Ceramy/image/img/A01X/G101/ENG/GCM155R71E223KA55-01.pdf> 470pF ___ Source: Digikey <https://www.digikey.de/products/en?keywords=490-4913-1-ND> ; Datasheet <https://search.murata.co.jp/Ceramy/image/img/A01X/G101/ENG/GCM155R71H471KA37-01.pdf> package: C0603 : 1µF ___ Source: Digikey <https://www.digikey.de/products/en?keywords=490-5241-1-ND> ; Datasheet <https://www.murata.com/-/media/webrenewal/support/library/catalog/products/capacitor/ceramiccapacitor/c03e.ashx?la=en-us&cvid=20200707014404000000> 470nF ___ Source: Digikey <https://www.digikey.de/products/en?keywords=490-12589-1-ND> ; Datasheet <https://search.murata.co.jp/Ceramy/image/img/A01X/G101/ENG/GCM188R71C474KA55-01.pdf> 10nF ___ Source: Digikey <https://www.digikey.de/products/en?keywords=490-4781-1-ND> ; Datasheet <https://search.murata.co.jp/Ceramy/image/img/A01X/G101/ENG/GCM188R72A103KA37-01.pdf> 22nF ___ Source: Digikey <https://www.digikey.de/products/en?keywords=490-4782-1-ND> ; Datasheet <https://www.murata.com/-/media/webrenewal/support/library/catalog/products/capacitor/ceramiccapacitor/c03e.ashx?la=en-us&cvid=20200707014404000000> package: C0805 : 10µF ___ Source: Digikey <https://www.digikey.de/products/en?keywords=490-14361-1-ND> ; Datasheet <https://search.murata.co.jp/Ceramy/image/img/A01X/G101/ENG/GCM21BR70J106KE22-01.pdf> 2.2µF ___ Source: Digikey <https://www.digikey.de/products/en?keywords=490-4786-1-ND> ; Datasheet <https://search.murata.co.jp/Ceramy/image/img/A01X/G101/ENG/GCM21BR71C225KA64-01.pdf> 470nF ___ Source: Digikey <https://www.digikey.de/products/en?keywords=490-4788-1-ND> ; Datasheet <https://search.murata.co.jp/Ceramy/image/img/A01X/G101/ENG/GCM21BR71H474KA55-01.pdf> 100nF ___ Source: Digikey <https://www.digikey.de/products/en?keywords=490-8051-1-ND> ; Datasheet <https://search.murata.co.jp/Ceramy/image/img/A01X/G101/ENG/GCM21BR72A104KA37-01.pdf> package: C0805K : 220nF ___ Source: Digikey <https://www.digikey.de/products/en?keywords=490-8306-1-ND> ; Datasheet <https://search.murata.co.jp/Ceramy/image/img/A01X/G101/ENG/GRM21AR72A224KAC5-01.pdf> package: C1206 : 10µF ___ Source: Digikey <https://www.digikey.de/products/en?keywords=490-14746-1-ND> ; Datasheet <https://search.murata.co.jp/Ceramy/image/img/A01X/G101/ENG/GCM31CR71C106KA64-01.pdf> 2.2µF ___ Source: Digikey <https://www.digikey.de/products/en?keywords=490-11169-1-ND> ; Datasheet <https://search.murata.co.jp/Ceramy/image/img/A01X/G101/ENG/GCM31CR71H225KA55-01.pdf> package: C1206 : 2220nF ___ Source: Digikey <https://www.digikey.de/products/en?keywords=490-4975-1-ND> ; Datasheet <https://search.murata.co.jp/Ceramy/image/img/A01X/G101/ENG/GCM31MR72A224KA37-01.pdf>; CAPACITANCE: 6n8F; DIGIKEY: 490-12655-1-ND; TOLERANCE: ±10%; VOLTAGE: 16V
C2 = msrm:GCM?R7*: Multilayer Ceramic Capacitors Chip Multilayer Ceramic Capacitors for Automotive –55 to 125°C Sources: Catalogue <https://www.murata.com/~/media/webrenewal/support/library/catalog/products/capacitor/mlcc/c03e.ashx?la=en-us> Part Numbering <https://search.murata.co.jp/Ceramy/image/img/A01X/partnumbering_e_02.pdf> package: C0201 : 470pF ___ Source: Digikey <https://www.digikey.de/products/en?keywords=490-17744-1-ND> ; Datasheet <https://search.murata.co.jp/Ceramy/image/img/A01X/G101/ENG/GCM033R71E471KA03-01.pdf> package: C0402 : 100nF ___ Source: Digikey <https://www.digikey.de/products/en?keywords=490-16433-1-ND> ; Datasheet <https://search.murata.co.jp/Ceramy/image/img/A01X/G101/ENG/GCM155R71C104JA55-01.pdf> 220nF ___ Source: Digikey <https://www.digikey.de/products/en?keywords=490-10671-1-ND> ; Datasheet <https://www.murata.com/-/media/webrenewal/support/library/catalog/products/capacitor/ceramiccapacitor/c03e.ashx?la=en-us&cvid=20200707014404000000> 6.8nF ___ Source: Digikey <https://www.digikey.de/products/en?keywords=490-12655-1-ND> ; Datasheet <https://search.murata.co.jp/Ceramy/image/img/A01X/G101/ENG/GCM155R71C683KA55-01.pdf> 10nF ___ Source: Digikey <https://www.digikey.de/products/en?keywords=490-6043-1-ND> ; Datasheet <https://search.murata.co.jp/Ceramy/image/img/A01X/G101/ENG/GCM155R71E103KA37-01.pdf> 22nF ___ Source: Digikey <https://www.digikey.de/products/en?keywords=490-6044-1-ND> ; Datasheet <https://search.murata.co.jp/Ceramy/image/img/A01X/G101/ENG/GCM155R71E223KA55-01.pdf> 470pF ___ Source: Digikey <https://www.digikey.de/products/en?keywords=490-4913-1-ND> ; Datasheet <https://search.murata.co.jp/Ceramy/image/img/A01X/G101/ENG/GCM155R71H471KA37-01.pdf> package: C0603 : 1µF ___ Source: Digikey <https://www.digikey.de/products/en?keywords=490-5241-1-ND> ; Datasheet <https://www.murata.com/-/media/webrenewal/support/library/catalog/products/capacitor/ceramiccapacitor/c03e.ashx?la=en-us&cvid=20200707014404000000> 470nF ___ Source: Digikey <https://www.digikey.de/products/en?keywords=490-12589-1-ND> ; Datasheet <https://search.murata.co.jp/Ceramy/image/img/A01X/G101/ENG/GCM188R71C474KA55-01.pdf> 10nF ___ Source: Digikey <https://www.digikey.de/products/en?keywords=490-4781-1-ND> ; Datasheet <https://search.murata.co.jp/Ceramy/image/img/A01X/G101/ENG/GCM188R72A103KA37-01.pdf> 22nF ___ Source: Digikey <https://www.digikey.de/products/en?keywords=490-4782-1-ND> ; Datasheet <https://www.murata.com/-/media/webrenewal/support/library/catalog/products/capacitor/ceramiccapacitor/c03e.ashx?la=en-us&cvid=20200707014404000000> package: C0805 : 10µF ___ Source: Digikey <https://www.digikey.de/products/en?keywords=490-14361-1-ND> ; Datasheet <https://search.murata.co.jp/Ceramy/image/img/A01X/G101/ENG/GCM21BR70J106KE22-01.pdf> 2.2µF ___ Source: Digikey <https://www.digikey.de/products/en?keywords=490-4786-1-ND> ; Datasheet <https://search.murata.co.jp/Ceramy/image/img/A01X/G101/ENG/GCM21BR71C225KA64-01.pdf> 470nF ___ Source: Digikey <https://www.digikey.de/products/en?keywords=490-4788-1-ND> ; Datasheet <https://search.murata.co.jp/Ceramy/image/img/A01X/G101/ENG/GCM21BR71H474KA55-01.pdf> 100nF ___ Source: Digikey <https://www.digikey.de/products/en?keywords=490-8051-1-ND> ; Datasheet <https://search.murata.co.jp/Ceramy/image/img/A01X/G101/ENG/GCM21BR72A104KA37-01.pdf> package: C0805K : 220nF ___ Source: Digikey <https://www.digikey.de/products/en?keywords=490-8306-1-ND> ; Datasheet <https://search.murata.co.jp/Ceramy/image/img/A01X/G101/ENG/GRM21AR72A224KAC5-01.pdf> package: C1206 : 10µF ___ Source: Digikey <https://www.digikey.de/products/en?keywords=490-14746-1-ND> ; Datasheet <https://search.murata.co.jp/Ceramy/image/img/A01X/G101/ENG/GCM31CR71C106KA64-01.pdf> 2.2µF ___ Source: Digikey <https://www.digikey.de/products/en?keywords=490-11169-1-ND> ; Datasheet <https://search.murata.co.jp/Ceramy/image/img/A01X/G101/ENG/GCM31CR71H225KA55-01.pdf> package: C1206 : 2220nF ___ Source: Digikey <https://www.digikey.de/products/en?keywords=490-4975-1-ND> ; Datasheet <https://search.murata.co.jp/Ceramy/image/img/A01X/G101/ENG/GCM31MR72A224KA37-01.pdf>; CAPACITANCE: 100nF; DIGIKEY: 490-16433-1-ND; TOLERANCE: ±5%; VOLTAGE: 16V
IC1 = msrm:MAX42*: Instrument Amp Single R-R O/P 2.75/5.5V package: USOP8 : MAX4289 ___ Source: Digikey <https://www.digikey.de/product-detail/en/maxim-integrated/MAX4208AUA-T/MAX4208AUA-TCT-ND/9760057> ; Datasheet <http://datasheets.maximintegrated.com/en/ds/MAX4208-MAX4209.pdf> MAX4209 ___ Source: Digikey <https://www.digikey.de/product-detail/en/maxim-integrated/MAX4209HAUA/MAX4209HAUA-ND/1780104> ; Datasheet <http://datasheets.maximintegrated.com/en/ds/MAX4208-MAX4209.pdf>; DESCRIPTION: Instrument Amp Single R-R O/P 2.75/5.5V; DIGIKEY: MAX4208AUA+-ND; HEIGHT: 1.1mm; INPUT_RESISTANCE: 2G; MANUFACTURER_NAME: Maxim Integrated; MANUFACTURER_PART_NUMBER: MAX4208AUA+; MOUSER_PART_NUMBER: 700-MAX4208AUA; MOUSER_PRICE-STOCK: https://www.mouser.com/Search/Refine.aspx?Keyword=700-MAX4208AUA; RS_PART_NUMBER: 7328406P; RS_PRICE-STOCK: http://uk.rs-online.com/web/p/products/7328406P; SUPPLY_CURRENT: Buffer OFF: 0.75 - 1.3 mA Buffer ON: 1.4 - 2.3 mA; SUPPLY_VOLTAGE: Single: 2.85 - 5.5 Dual: ±1.425 - ±2.75; VOLTAGE_GAIN: 1 - (1 + R2/R1)
R1 = msrm:RT?FRE07*L: SMD RESISTOR ± 1% Tol, Paper/PE taping reel, 50 ppm/°C, 7 inch dia. Reel Datasheet <http://www.yageo.com/documents/recent/PYu-RT_1-to-0.01_RoHS_L_11.pdf> package: 0201 : 0R ___ Source: Digikey <https://www.digikey.de/products/en?keywords=311-0.0MCT-ND> 1k ___ Source: Digikey <https://www.digikey.de/products/en?keywords=RT0201FRE071KL-ND> 10k ___ Source: Digikey <https://www.digikey.de/products/en?keywords=RT0201FRE0710KL-ND> 100 ___ Source: Digikey <https://www.digikey.de/products/en?keywords=RT0201FRE07100RL-ND> 330 ___ Source: Digikey <https://www.digikey.de/products/en?keywords=RT0201FRE07330RL-ND> package: 0402 : 0R ___ Source: Digikey <https://www.digikey.de/products/en?keywords=311-0.0LRCT-ND> 1k ___ Source: Digikey <https://www.digikey.de/products/en?keywords=%20YAG1234CT-ND> 2k2 ___ Source: Digikey <https://www.digikey.de/products/en?keywords=RT0402FRE072K2L-ND> 2k ___ Source: Digikey <https://www.digikey.de/products/en?keywords=YAG3345CT-ND> 4k7 ___ Source: Digikey <https://www.digikey.de/products/en?keywords=YAG3347CT-ND%20> 10k ___ Source: Digikey <https://www.digikey.de/products/en?keywords=YAG1233CT-ND> 12k1 ___ Source: Digikey <https://www.digikey.de/products/en?keywords=RT0402FRE0712K1L-ND> 49R9 ___ Source: Digikey <https://www.digikey.de/products/en?keywords=YAG3346CT-ND> 56k ___ Source: Digikey <https://www.digikey.de/products/en?keywords=RT0402FRE0756K2L-ND> 100k ___ Source: Digikey <https://www.digikey.de/products/en?keywords=YAG2307CT-ND> 100 ___ Source: Digikey <https://www.digikey.de/products/en?keywords=YAG3342CT-ND> 150 ___ Source: Digikey <https://www.digikey.de/product-detail/en/yageo/RT0402FRE07150RL/13-RT0402FRE07150RLCT-ND/12705162> 300 ___ Source: Digikey <https://www.digikey.de/products/en?keywords=RT0402FRE07300RL-ND> package: 0603 : 0R ___ Source: Digikey <https://www.digikey.de/products/en?keywords=311-0.0HRCT-ND> 1k ___ Source: Digikey <https://www.digikey.de/products/en?keywords=YAG2323CT-ND> 10k ___ Source: Digikey <https://www.digikey.de/products/en?keywords=YAG2321CT-ND> 100k ___ Source: Digikey <https://www.digikey.de/products/en?keywords=YAG2319CT-ND> 100 ___ Source: Digikey <https://www.digikey.de/products/en?keywords=YAG2320CT-ND> 300 ___ Source: Digikey <https://www.digikey.de/products/en?keywords=RT0603FRE07300RL-ND> 330 ___ Source: Digikey <https://www.digikey.de/products/en?keywords=YAG5957CT-ND>; DIGIKEY: YAG3342CT-ND; RVALUE: 100; SPICEPREFIX: R
R2 = msrm:RT?BRD07*L: SMD-Resistor ±0.1% 0.063W, 1/16W Chip Resistor 0402 (1005 Metric) Thin Film package: R0402 : 1k ___ Source: Digikey <https://www.digikey.de/products/en?keywords=%20YAG1386CT-ND> ; Datasheet <https://www.yageo.com/upload/media/product/productsearch/datasheet/rchip/PYu-RT_1-to-0.01_RoHS_L_12.pdf> 2k05 ___ Source: Digikey <https://www.digikey.de/products/en?keywords=YAG1400CT-ND> ; Datasheet <https://www.yageo.com/upload/media/product/productsearch/datasheet/rchip/PYu-RT_1-to-0.01_RoHS_L_12.pdf> 3k2 ___ Source: Digikey <YAG4255CT-ND> ; Datasheet <https://www.yageo.com/upload/media/product/productsearch/datasheet/rchip/PYu-RT_1-to-0.01_RoHS_L_12.pdf> 4k99 ___ Source: Digikey <https://www.digikey.de/products/en?keywords=YAG1447CT-ND> ; Datasheet <https://www.yageo.com/upload/media/product/productsearch/datasheet/rchip/PYu-RT_1-to-0.01_RoHS_L_12.pdf> 10k ___ Source: Digikey <https://www.digikey.de/products/en?keywords=%E2%80%8EA119918CT-ND%E2%80%8E> ; Datasheet <https://www.yageo.com/upload/media/product/productsearch/datasheet/rchip/PYu-RT_1-to-0.01_RoHS_L_12.pdf> 12k ___ Source: Digikey <https://www.digikey.de/products/en?keywords=YAG1354CT-ND> ; Datasheet <https://www.yageo.com/upload/media/product/productsearch/datasheet/rchip/PYu-RT_1-to-0.01_RoHS_L_12.pdf> 22k ___ Source: Digikey <https://www.digikey.de/products/en?keywords=YAG4210CT-ND> ; Datasheet <https://www.yageo.com/upload/media/product/productsearch/datasheet/rchip/PYu-RT_1-to-0.01_RoHS_L_12.pdf> 56k ___ Source: Digikey <https://www.digikey.de/products/en?keywords=YAG1454CT-ND%20> ; Datasheet <https://www.yageo.com/upload/media/product/productsearch/datasheet/rchip/PYu-RT_1-to-0.01_RoHS_L_12.pdf> 60k4 ___ Source: Digikey <https://www.digikey.de/products/en?keywords=YAG1461CT-ND> ; Datasheet <https://www.yageo.com/upload/media/product/productsearch/datasheet/rchip/PYu-RT_1-to-0.01_RoHS_L_12.pdf> 270R ___ Source: Digikey <https://www.digikey.de/products/en?keywords=YAG1396CT-ND> ; Datasheet <https://www.yageo.com/upload/media/product/productsearch/datasheet/rchip/PYu-RT_1-to-0.01_RoHS_L_12.pdf>; DIGIKEY: YAG1354CT-ND; RVALUE: 12k; SPICEPREFIX: R
R3 = msrm:RT?FRE07*L: SMD RESISTOR ± 1% Tol, Paper/PE taping reel, 50 ppm/°C, 7 inch dia. Reel Datasheet <http://www.yageo.com/documents/recent/PYu-RT_1-to-0.01_RoHS_L_11.pdf> package: 0201 : 0R ___ Source: Digikey <https://www.digikey.de/products/en?keywords=311-0.0MCT-ND> 1k ___ Source: Digikey <https://www.digikey.de/products/en?keywords=RT0201FRE071KL-ND> 10k ___ Source: Digikey <https://www.digikey.de/products/en?keywords=RT0201FRE0710KL-ND> 100 ___ Source: Digikey <https://www.digikey.de/products/en?keywords=RT0201FRE07100RL-ND> 330 ___ Source: Digikey <https://www.digikey.de/products/en?keywords=RT0201FRE07330RL-ND> package: 0402 : 0R ___ Source: Digikey <https://www.digikey.de/products/en?keywords=311-0.0LRCT-ND> 1k ___ Source: Digikey <https://www.digikey.de/products/en?keywords=%20YAG1234CT-ND> 2k2 ___ Source: Digikey <https://www.digikey.de/products/en?keywords=RT0402FRE072K2L-ND> 2k ___ Source: Digikey <https://www.digikey.de/products/en?keywords=YAG3345CT-ND> 4k7 ___ Source: Digikey <https://www.digikey.de/products/en?keywords=YAG3347CT-ND%20> 10k ___ Source: Digikey <https://www.digikey.de/products/en?keywords=YAG1233CT-ND> 12k1 ___ Source: Digikey <https://www.digikey.de/products/en?keywords=RT0402FRE0712K1L-ND> 49R9 ___ Source: Digikey <https://www.digikey.de/products/en?keywords=YAG3346CT-ND> 56k ___ Source: Digikey <https://www.digikey.de/products/en?keywords=RT0402FRE0756K2L-ND> 100k ___ Source: Digikey <https://www.digikey.de/products/en?keywords=YAG2307CT-ND> 100 ___ Source: Digikey <https://www.digikey.de/products/en?keywords=YAG3342CT-ND> 150 ___ Source: Digikey <https://www.digikey.de/product-detail/en/yageo/RT0402FRE07150RL/13-RT0402FRE07150RLCT-ND/12705162> 300 ___ Source: Digikey <https://www.digikey.de/products/en?keywords=RT0402FRE07300RL-ND> package: 0603 : 0R ___ Source: Digikey <https://www.digikey.de/products/en?keywords=311-0.0HRCT-ND> 1k ___ Source: Digikey <https://www.digikey.de/products/en?keywords=YAG2323CT-ND> 10k ___ Source: Digikey <https://www.digikey.de/products/en?keywords=YAG2321CT-ND> 100k ___ Source: Digikey <https://www.digikey.de/products/en?keywords=YAG2319CT-ND> 100 ___ Source: Digikey <https://www.digikey.de/products/en?keywords=YAG2320CT-ND> 300 ___ Source: Digikey <https://www.digikey.de/products/en?keywords=RT0603FRE07300RL-ND> 330 ___ Source: Digikey <https://www.digikey.de/products/en?keywords=YAG5957CT-ND>; DIGIKEY: RT0402FRE0756K2L-ND; RVALUE: 56k; SPICEPREFIX: R
R4 = msrm:RT?BRD07*L: SMD-Resistor ±0.1% 0.063W, 1/16W Chip Resistor 0402 (1005 Metric) Thin Film package: R0402 : 1k ___ Source: Digikey <https://www.digikey.de/products/en?keywords=%20YAG1386CT-ND> ; Datasheet <https://www.yageo.com/upload/media/product/productsearch/datasheet/rchip/PYu-RT_1-to-0.01_RoHS_L_12.pdf> 2k05 ___ Source: Digikey <https://www.digikey.de/products/en?keywords=YAG1400CT-ND> ; Datasheet <https://www.yageo.com/upload/media/product/productsearch/datasheet/rchip/PYu-RT_1-to-0.01_RoHS_L_12.pdf> 3k2 ___ Source: Digikey <YAG4255CT-ND> ; Datasheet <https://www.yageo.com/upload/media/product/productsearch/datasheet/rchip/PYu-RT_1-to-0.01_RoHS_L_12.pdf> 4k99 ___ Source: Digikey <https://www.digikey.de/products/en?keywords=YAG1447CT-ND> ; Datasheet <https://www.yageo.com/upload/media/product/productsearch/datasheet/rchip/PYu-RT_1-to-0.01_RoHS_L_12.pdf> 10k ___ Source: Digikey <https://www.digikey.de/products/en?keywords=%E2%80%8EA119918CT-ND%E2%80%8E> ; Datasheet <https://www.yageo.com/upload/media/product/productsearch/datasheet/rchip/PYu-RT_1-to-0.01_RoHS_L_12.pdf> 12k ___ Source: Digikey <https://www.digikey.de/products/en?keywords=YAG1354CT-ND> ; Datasheet <https://www.yageo.com/upload/media/product/productsearch/datasheet/rchip/PYu-RT_1-to-0.01_RoHS_L_12.pdf> 22k ___ Source: Digikey <https://www.digikey.de/products/en?keywords=YAG4210CT-ND> ; Datasheet <https://www.yageo.com/upload/media/product/productsearch/datasheet/rchip/PYu-RT_1-to-0.01_RoHS_L_12.pdf> 56k ___ Source: Digikey <https://www.digikey.de/products/en?keywords=YAG1454CT-ND%20> ; Datasheet <https://www.yageo.com/upload/media/product/productsearch/datasheet/rchip/PYu-RT_1-to-0.01_RoHS_L_12.pdf> 60k4 ___ Source: Digikey <https://www.digikey.de/products/en?keywords=YAG1461CT-ND> ; Datasheet <https://www.yageo.com/upload/media/product/productsearch/datasheet/rchip/PYu-RT_1-to-0.01_RoHS_L_12.pdf> 270R ___ Source: Digikey <https://www.digikey.de/products/en?keywords=YAG1396CT-ND> ; Datasheet <https://www.yageo.com/upload/media/product/productsearch/datasheet/rchip/PYu-RT_1-to-0.01_RoHS_L_12.pdf>; DIGIKEY: ‎A119918CT-ND‎; RVALUE: 10k; SPICEPREFIX: R

## Module ETHERCAT
Ports: ECAT_CS(in) ECAT_MISO(out) ECAT_MOSI(io) ECAT_SCK(in) ECAT_SQI2(io) ECAT_SQI3(io) V+(pwr) GND(pwr)
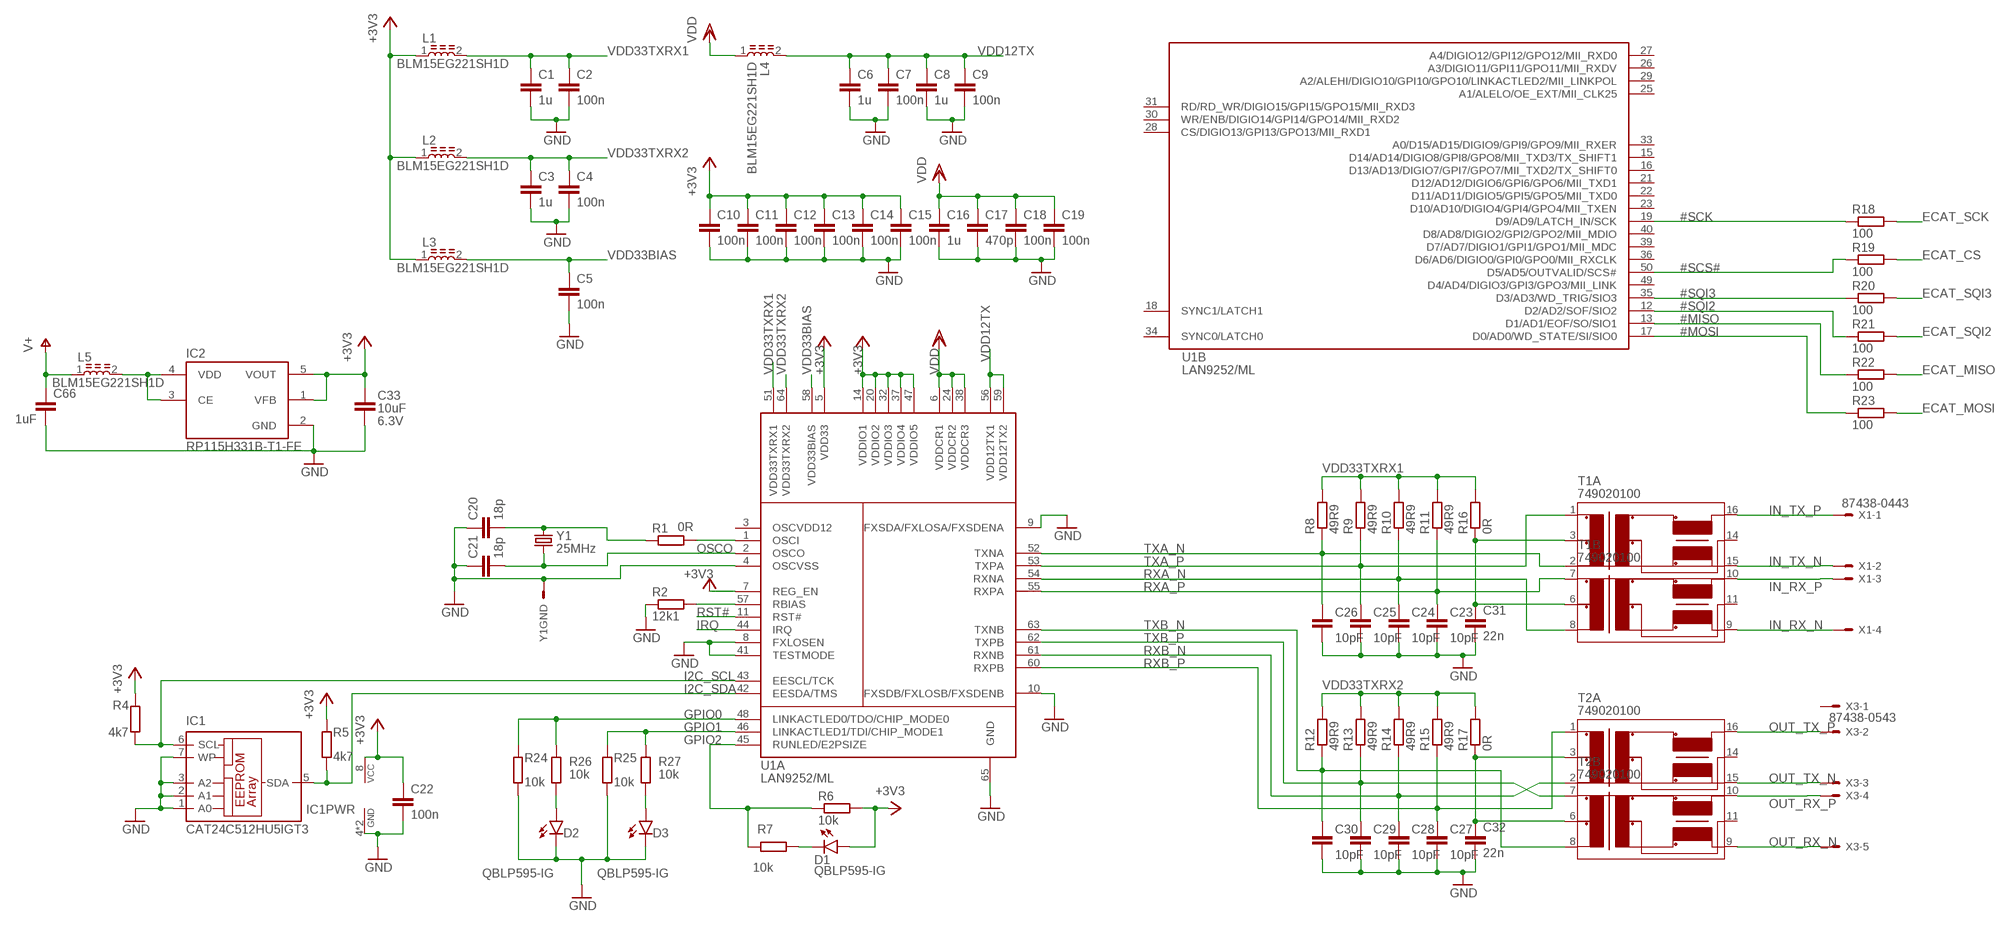
[diagram p6: schematic, module ETHERCAT, sheet 1]

### Parts
C1  1u  GCM155C71A105KE38D  [C0402]
C2  100n  GCM155R71C104JA55  [C0402]
C3  1u  GCM155C71A105KE38D  [C0402]
C4  100n  GCM155R71C104JA55  [C0402]
C5  100n  GCM155R71C104JA55  [C0402]
C6  1u  GCM155C71A105KE38D  [C0402]
C7  100n  GCM155R71C104JA55  [C0402]
C8  1u  GCM155C71A105KE38D  [C0402]
C9  100n  GCM155R71C104JA55  [C0402]
C10  100n  GCM155R71C104JA55  [C0402]
C11  100n  GCM155R71C104JA55  [C0402]
C12  100n  GCM155R71C104JA55  [C0402]
C13  100n  GCM155R71C104JA55  [C0402]
C14  100n  GCM155R71C104JA55  [C0402]
C15  100n  GCM155R71C104JA55  [C0402]
C16  1u  GCM155C71A105KE38D  [C0402]
C17  470p  GCM155R71H471KA37  [C0402]
C18  100n  GCM155R71C104JA55  [C0402]
C19  100n  GCM155R71C104JA55  [C0402]
C20  18p  GCM1555C1H180JA16  [C0402]
C21  18p  GCM1555C1H180JA16  [C0402]
C22  100n  GCM155R71C104JA55  [C0402]
C23  GCM1555C1H100JA16  [C0402]
C24  GCM1555C1H100JA16  [C0402]
C25  GCM1555C1H100JA16  [C0402]
C26  GCM1555C1H100JA16  [C0402]
C27  GCM1555C1H100JA16  [C0402]
C28  GCM1555C1H100JA16  [C0402]
C29  GCM1555C1H100JA16  [C0402]
C30  GCM1555C1H100JA16  [C0402]
C31  22n  GCM155R71E223KA55  [C0402]
C32  22n  GCM155R71E223KA55  [C0402]
C33  GRM155C80J106ME11D  [C0402]
C66  1uF  GCM155C71A105KE38D  [C0402]  (not fitted in variant +3V3)
D1  QBLP595-IG  [LED0402]
D2  QBLP595-IG  [LED0402]
D3  QBLP595-IG  [LED0402]
IC1  CAT24C512HU5IGT3  [UDFN8]
IC2  RP115H331B-T1-FE  [SOT-89-5]
L1  BLM15EG221SH1D  [BEAD0402]
L2  BLM15EG221SH1D  [BEAD0402]
L3  BLM15EG221SH1D  [BEAD0402]
L4  BLM15EG221SH1D  [BEAD0402]
L5  BLM15EG221SH1D  [BEAD0402]
R1  0R  RT0402FRE070RL  [R0402]
R2  12k1  RT0402FRE0712K1L  [R0402]
R4  4k7  RT0402FRE074K7L  [R0402]
R5  4k7  RT0402FRE074K7L  [R0402]
R6  10k  RT0402FRE0710KL  [R0402]
R7  RL1206FR-7WL  RT0402FRE0710KL  [R0402]
R8  49R9  RT0402FRE0749R9L  [R0402]
R9  49R9  RT0402FRE0749R9L  [R0402]
R10  49R9  RT0402FRE0749R9L  [R0402]
R11  49R9  RT0402FRE0749R9L  [R0402]
R12  49R9  RT0402FRE0749R9L  [R0402]
R13  49R9  RT0402FRE0749R9L  [R0402]
R14  49R9  RT0402FRE0749R9L  [R0402]
R15  49R9  RT0402FRE0749R9L  [R0402]
R16  0R  RT0402FRE070RL  [R0402]
R17  0R  RT0402FRE070RL  [R0402]
R18  100  RT0402FRE07100RL  [R0402]
R19  100  RT0402FRE07100RL  [R0402]
R20  100  RT0402FRE07100RL  [R0402]
R21  100  RT0402FRE07100RL  [R0402]
R22  100  RT0402FRE07100RL  [R0402]
R23  100  RT0402FRE07100RL  [R0402]
R24  10k  RT0402FRE0710KL  [R0402]
R25  10k  RT0402FRE0710KL  [R0402]
R26  RL1206FR-7WL  RT0402FRE0710KL  [R0402]
R27  RL1206FR-7WL  RT0402FRE0710KL  [R0402]
T1  749020100  [SOIC127P965X533-16-TRAFO]
T2  749020100  [SOIC127P965X533-16-TRAFO]
U1  LAN9252/ML  [QFN64-T600]
X1  87438-0443  [87438-04]
X3  87438-0543  [87438-05]
Y1  ECS-250-18-36B-CKY-TR  [ECX-2236]

### Nets
#MISO: R22.1 U1.13(B:D1/AD1/EOF/SO/SIO1)
#MOSI: R23.1 U1.17(B:D0/AD0/WD_STATE/SI/SIO0)
#SCK: R18.1 U1.19(B:D9/AD9/LATCH_IN/SCK)
#SCS#: R19.1 U1.50(B:D5/AD5/OUTVALID/SCS#)
#SQI2: R21.1 U1.12(B:D2/AD2/SOF/SIO2)
#SQI3: R20.1 U1.35(B:D3/AD3/WD_TRIG/SIO3)
+3V3 [power]: C10.1 C11.1 C12.1 C13.1 C14.1 C15.1 C22.1 C33.1 D1.2(A) IC1.8(VCC) IC2.1(VFB) IC2.5(VOUT) L1.1 L2.1 L3.1 R4.2 R5.2 R6.2 U1.5(A:VDD33) U1.7(A:REG_EN) U1.14(A:VDDIO1) U1.20(A:VDDIO2) U1.32(A:VDDIO3) U1.37(A:VDDIO4) U1.47(A:VDDIO5)
CT1: C31.1 R16.1 T1.3(A:CT) T1.6(B:CT)
CT2: C32.1 R17.1 T2.3(A:CT) T2.6(B:CT)
ECAT_CS: R19.2
ECAT_MISO: R22.2
ECAT_MOSI: R23.2
ECAT_SCK: R18.2
ECAT_SQI2: R21.2
ECAT_SQI3: R20.2
GND [power]: C1.2 C2.2 C3.2 C4.2 C5.2 C6.2 C7.2 C8.2 C9.2 C10.2 C11.2 C12.2 C13.2 C14.2 C15.2 C16.2 C17.2 C18.2 C19.2 C20.1 C21.1 C22.2 C23.2 C24.2 C25.2 C26.2 C27.2 C28.2 C29.2 C30.2 C31.2 C32.2 C33.2 C66.2 D2.1(C) D3.1(C) IC1.1(A0) IC1.2(A1) IC1.3(A2) IC1.4(GND) IC1.7(WP) IC1.9(GND) IC2.2(GND) R2.1 R24.1 R25.1 U1.4(A:OSCVSS) U1.8(A:FXLOSEN) U1.9(A:FXSDA/FXLOSA/FXSDENA) U1.10(A:FXSDB/FXLOSB/FXSDENB) U1.41(A:TESTMODE) U1.65(A:GND) Y1.2(S) Y1.4(S)
GPIO0: R24.2 R26.1 U1.48(A:LINKACTLED0/TDO/CHIP_MODE0)
GPIO1: R25.2 R27.1 U1.46(A:LINKACTLED1/TDI/CHIP_MODE1)
GPIO2: R6.1 R7.2 U1.45(A:RUNLED/E2PSIZE)
I2C_SCL: IC1.6(SCL) R4.1 U1.43(A:EESCL/TCK)
I2C_SDA: IC1.5(SDA) R5.1 U1.42(A:EESDA/TMS)
IN_RX_N: T1.9(B:X-) X1.4
IN_RX_P: T1.10(B:X+) X1.3
IN_TX_N: T1.15(A:X-) X1.2
IN_TX_P: T1.16(A:X+) X1.1
IRQ: U1.44(A:IRQ)
N$1: D2.2(A) R26.2
N$2: D3.2(A) R27.2
N$3: IC2.3(CE) IC2.4(VDD) L5.2
N$15: D1.1(C) R7.1
OSCI: R1.2 U1.1(A:OSCI)
OSCI1: C20.2 R1.1 Y1.3
OSCO: C21.2 U1.2(A:OSCO) Y1.1
OUT_RX_N: T2.9(B:X-) X3.5
OUT_RX_P: T2.10(B:X+) X3.4
OUT_TX_N: T2.15(A:X-) X3.3
OUT_TX_P: T2.16(A:X+) X3.2
RBIAS: R2.2 U1.57(A:RBIAS)
RST#: U1.11(A:RST#)
RXA_N: C24.1 R10.1 T1.8(B:D-) U1.54(A:RXNA)
RXA_P: C23.1 R11.1 T1.7(B:D+) U1.55(A:RXPA)
RXB_N: C28.1 R14.1 T2.2(A:D-) U1.61(A:RXNB)
RXB_P: C27.1 R15.1 T2.1(A:D+) U1.60(A:RXPB)
TXA_N: C26.1 R8.1 T1.2(A:D-) U1.52(A:TXNA)
TXA_P: C25.1 R9.1 T1.1(A:D+) U1.53(A:TXPA)
TXB_N: C30.1 R12.1 T2.8(B:D-) U1.63(A:TXNB)
TXB_P: C29.1 R13.1 T2.7(B:D+) U1.62(A:TXPB)
V+: C66.1 L5.1
VDD [power]: C16.1 C17.1 C18.1 C19.1 L4.1 U1.6(A:VDDCR1) U1.24(A:VDDCR2) U1.38(A:VDDCR3)
VDD12TX [power]: C6.1 C7.1 C8.1 C9.1 L4.2 U1.56(A:VDD12TX1) U1.59(A:VDD12TX2)
VDD33BIAS [power]: C5.1 L3.2 U1.58(A:VDD33BIAS)
VDD33TXRX1 [power]: C1.1 C2.1 L1.2 R8.2 R9.2 R10.2 R11.2 R16.2 U1.51(A:VDD33TXRX1)
VDD33TXRX2 [power]: C3.1 C4.1 L2.2 R12.2 R13.2 R14.2 R15.2 R17.2 U1.64(A:VDD33TXRX2)
Unconnected: T1.11(B:XCT) T1.14(A:XCT) T2.11(B:XCT) T2.14(A:XCT) U1.15(B:D14/AD14/DIGIO8/GPI8/GPO8/MII_TXD3/TX_SHIFT1) U1.16(B:D13/AD13/DIGIO7/GPI7/GPO7/MII_TXD2/TX_SHIFT0) U1.18(B:SYNC1/LATCH1) U1.21(B:D12/AD12/DIGIO6/GPI6/GPO6/MII_TXD1) U1.22(B:D11/AD11/DIGIO5/GPI5/GPO5/MII_TXD0) U1.23(B:D10/AD10/DIGIO4/GPI4/GPO4/MII_TXEN) U1.25(B:A1/ALELO/OE_EXT/MII_CLK25) U1.26(B:A3/DIGIO11/GPI11/GPO11/MII_RXDV) U1.27(B:A4/DIGIO12/GPI12/GPO12/MII_RXD0) U1.28(B:CS/DIGIO13/GPI13/GPO13/MII_RXD1) U1.29(B:A2/ALEHI/DIGIO10/GPI10/GPO10/LINKACTLED2/MII_LINKPOL) U1.30(B:WR/ENB/DIGIO14/GPI14/GPO14/MII_RXD2) U1.31(B:RD/RD_WR/DIGIO15/GPI15/GPO15/MII_RXD3) U1.33(B:A0/D15/AD15/DIGIO9/GPI9/GPO9/MII_RXER) U1.34(B:SYNC0/LATCH0) U1.36(B:D6/AD6/DIGIO0/GPI0/GPO0/MII_RXCLK) U1.39(B:D7/AD7/DIGIO1/GPI1/GPO1/MII_MDC) U1.40(B:D8/AD8/DIGIO2/GPI2/GPO2/MII_MDIO) U1.49(B:D4/AD4/DIGIO3/GPI3/GPO3/MII_LINK) X3.1

### Power pins joined to a net without a drawn wire
OSCVDD12: U1.3(A:OSCVDD12)

### Library data of the parts
C1 C3 C6 C8 C16 C66 = msrm:GCM?C7*: Multilayer Ceramic Capacitors Chip Multilayer Ceramic Capacitors for Automotive Sources: Catalogue <https://www.murata.com/~/media/webrenewal/support/library/catalog/products/capacitor/mlcc/c03e.ashx?la=en-us> Part Numbering <https://search.murata.co.jp/Ceramy/image/img/A01X/partnumbering_e_02.pdf> package: C0402 : 490-13409-1 ___ Source: Digikey <https://www.digikey.de/products/en?keywords=490-13409-1-ND> ; Datasheet <https://www.murata.com/-/media/webrenewal/support/library/catalog/products/capacitor/ceramiccapacitor/c03e.ashx?la=en-us&cvid=20200707014404000000> 490-14427-1 ___ Source: Digikey <https://www.digikey.de/products/en?keywords=490-14427-1-ND> ; Datasheet <https://search.murata.co.jp/Ceramy/image/img/A01X/G101/ENG/GCM155C71A474KE36-01.pdf>; CAPACITANCE: 1uF; DIGIKEY: 490-13409-1-ND; TOLERANCE: ±10%; VOLTAGE: 10V
C2 C4 C5 C7 C9-C15 C18 C19 C22 = msrm:GCM?R7*: Multilayer Ceramic Capacitors Chip Multilayer Ceramic Capacitors for Automotive –55 to 125°C Sources: Catalogue <https://www.murata.com/~/media/webrenewal/support/library/catalog/products/capacitor/mlcc/c03e.ashx?la=en-us> Part Numbering <https://search.murata.co.jp/Ceramy/image/img/A01X/partnumbering_e_02.pdf> package: C0201 : 470pF ___ Source: Digikey <https://www.digikey.de/products/en?keywords=490-17744-1-ND> ; Datasheet <https://search.murata.co.jp/Ceramy/image/img/A01X/G101/ENG/GCM033R71E471KA03-01.pdf> package: C0402 : 100nF ___ Source: Digikey <https://www.digikey.de/products/en?keywords=490-16433-1-ND> ; Datasheet <https://search.murata.co.jp/Ceramy/image/img/A01X/G101/ENG/GCM155R71C104JA55-01.pdf> 220nF ___ Source: Digikey <https://www.digikey.de/products/en?keywords=490-10671-1-ND> ; Datasheet <https://www.murata.com/-/media/webrenewal/support/library/catalog/products/capacitor/ceramiccapacitor/c03e.ashx?la=en-us&cvid=20200707014404000000> 6.8nF ___ Source: Digikey <https://www.digikey.de/products/en?keywords=490-12655-1-ND> ; Datasheet <https://search.murata.co.jp/Ceramy/image/img/A01X/G101/ENG/GCM155R71C683KA55-01.pdf> 10nF ___ Source: Digikey <https://www.digikey.de/products/en?keywords=490-6043-1-ND> ; Datasheet <https://search.murata.co.jp/Ceramy/image/img/A01X/G101/ENG/GCM155R71E103KA37-01.pdf> 22nF ___ Source: Digikey <https://www.digikey.de/products/en?keywords=490-6044-1-ND> ; Datasheet <https://search.murata.co.jp/Ceramy/image/img/A01X/G101/ENG/GCM155R71E223KA55-01.pdf> 470pF ___ Source: Digikey <https://www.digikey.de/products/en?keywords=490-4913-1-ND> ; Datasheet <https://search.murata.co.jp/Ceramy/image/img/A01X/G101/ENG/GCM155R71H471KA37-01.pdf> package: C0603 : 1µF ___ Source: Digikey <https://www.digikey.de/products/en?keywords=490-5241-1-ND> ; Datasheet <https://www.murata.com/-/media/webrenewal/support/library/catalog/products/capacitor/ceramiccapacitor/c03e.ashx?la=en-us&cvid=20200707014404000000> 470nF ___ Source: Digikey <https://www.digikey.de/products/en?keywords=490-12589-1-ND> ; Datasheet <https://search.murata.co.jp/Ceramy/image/img/A01X/G101/ENG/GCM188R71C474KA55-01.pdf> 10nF ___ Source: Digikey <https://www.digikey.de/products/en?keywords=490-4781-1-ND> ; Datasheet <https://search.murata.co.jp/Ceramy/image/img/A01X/G101/ENG/GCM188R72A103KA37-01.pdf> 22nF ___ Source: Digikey <https://www.digikey.de/products/en?keywords=490-4782-1-ND> ; Datasheet <https://www.murata.com/-/media/webrenewal/support/library/catalog/products/capacitor/ceramiccapacitor/c03e.ashx?la=en-us&cvid=20200707014404000000> package: C0805 : 10µF ___ Source: Digikey <https://www.digikey.de/products/en?keywords=490-14361-1-ND> ; Datasheet <https://search.murata.co.jp/Ceramy/image/img/A01X/G101/ENG/GCM21BR70J106KE22-01.pdf> 2.2µF ___ Source: Digikey <https://www.digikey.de/products/en?keywords=490-4786-1-ND> ; Datasheet <https://search.murata.co.jp/Ceramy/image/img/A01X/G101/ENG/GCM21BR71C225KA64-01.pdf> 470nF ___ Source: Digikey <https://www.digikey.de/products/en?keywords=490-4788-1-ND> ; Datasheet <https://search.murata.co.jp/Ceramy/image/img/A01X/G101/ENG/GCM21BR71H474KA55-01.pdf> 100nF ___ Source: Digikey <https://www.digikey.de/products/en?keywords=490-8051-1-ND> ; Datasheet <https://search.murata.co.jp/Ceramy/image/img/A01X/G101/ENG/GCM21BR72A104KA37-01.pdf> package: C0805K : 220nF ___ Source: Digikey <https://www.digikey.de/products/en?keywords=490-8306-1-ND> ; Datasheet <https://search.murata.co.jp/Ceramy/image/img/A01X/G101/ENG/GRM21AR72A224KAC5-01.pdf> package: C1206 : 10µF ___ Source: Digikey <https://www.digikey.de/products/en?keywords=490-14746-1-ND> ; Datasheet <https://search.murata.co.jp/Ceramy/image/img/A01X/G101/ENG/GCM31CR71C106KA64-01.pdf> 2.2µF ___ Source: Digikey <https://www.digikey.de/products/en?keywords=490-11169-1-ND> ; Datasheet <https://search.murata.co.jp/Ceramy/image/img/A01X/G101/ENG/GCM31CR71H225KA55-01.pdf> package: C1206 : 2220nF ___ Source: Digikey <https://www.digikey.de/products/en?keywords=490-4975-1-ND> ; Datasheet <https://search.murata.co.jp/Ceramy/image/img/A01X/G101/ENG/GCM31MR72A224KA37-01.pdf>; CAPACITANCE: 100nF; DIGIKEY: 490-16433-1-ND; TOLERANCE: ±5%; VOLTAGE: 16V
C17 = msrm:GCM?R7*: Multilayer Ceramic Capacitors Chip Multilayer Ceramic Capacitors for Automotive –55 to 125°C Sources: Catalogue <https://www.murata.com/~/media/webrenewal/support/library/catalog/products/capacitor/mlcc/c03e.ashx?la=en-us> Part Numbering <https://search.murata.co.jp/Ceramy/image/img/A01X/partnumbering_e_02.pdf> package: C0201 : 470pF ___ Source: Digikey <https://www.digikey.de/products/en?keywords=490-17744-1-ND> ; Datasheet <https://search.murata.co.jp/Ceramy/image/img/A01X/G101/ENG/GCM033R71E471KA03-01.pdf> package: C0402 : 100nF ___ Source: Digikey <https://www.digikey.de/products/en?keywords=490-16433-1-ND> ; Datasheet <https://search.murata.co.jp/Ceramy/image/img/A01X/G101/ENG/GCM155R71C104JA55-01.pdf> 220nF ___ Source: Digikey <https://www.digikey.de/products/en?keywords=490-10671-1-ND> ; Datasheet <https://www.murata.com/-/media/webrenewal/support/library/catalog/products/capacitor/ceramiccapacitor/c03e.ashx?la=en-us&cvid=20200707014404000000> 6.8nF ___ Source: Digikey <https://www.digikey.de/products/en?keywords=490-12655-1-ND> ; Datasheet <https://search.murata.co.jp/Ceramy/image/img/A01X/G101/ENG/GCM155R71C683KA55-01.pdf> 10nF ___ Source: Digikey <https://www.digikey.de/products/en?keywords=490-6043-1-ND> ; Datasheet <https://search.murata.co.jp/Ceramy/image/img/A01X/G101/ENG/GCM155R71E103KA37-01.pdf> 22nF ___ Source: Digikey <https://www.digikey.de/products/en?keywords=490-6044-1-ND> ; Datasheet <https://search.murata.co.jp/Ceramy/image/img/A01X/G101/ENG/GCM155R71E223KA55-01.pdf> 470pF ___ Source: Digikey <https://www.digikey.de/products/en?keywords=490-4913-1-ND> ; Datasheet <https://search.murata.co.jp/Ceramy/image/img/A01X/G101/ENG/GCM155R71H471KA37-01.pdf> package: C0603 : 1µF ___ Source: Digikey <https://www.digikey.de/products/en?keywords=490-5241-1-ND> ; Datasheet <https://www.murata.com/-/media/webrenewal/support/library/catalog/products/capacitor/ceramiccapacitor/c03e.ashx?la=en-us&cvid=20200707014404000000> 470nF ___ Source: Digikey <https://www.digikey.de/products/en?keywords=490-12589-1-ND> ; Datasheet <https://search.murata.co.jp/Ceramy/image/img/A01X/G101/ENG/GCM188R71C474KA55-01.pdf> 10nF ___ Source: Digikey <https://www.digikey.de/products/en?keywords=490-4781-1-ND> ; Datasheet <https://search.murata.co.jp/Ceramy/image/img/A01X/G101/ENG/GCM188R72A103KA37-01.pdf> 22nF ___ Source: Digikey <https://www.digikey.de/products/en?keywords=490-4782-1-ND> ; Datasheet <https://www.murata.com/-/media/webrenewal/support/library/catalog/products/capacitor/ceramiccapacitor/c03e.ashx?la=en-us&cvid=20200707014404000000> package: C0805 : 10µF ___ Source: Digikey <https://www.digikey.de/products/en?keywords=490-14361-1-ND> ; Datasheet <https://search.murata.co.jp/Ceramy/image/img/A01X/G101/ENG/GCM21BR70J106KE22-01.pdf> 2.2µF ___ Source: Digikey <https://www.digikey.de/products/en?keywords=490-4786-1-ND> ; Datasheet <https://search.murata.co.jp/Ceramy/image/img/A01X/G101/ENG/GCM21BR71C225KA64-01.pdf> 470nF ___ Source: Digikey <https://www.digikey.de/products/en?keywords=490-4788-1-ND> ; Datasheet <https://search.murata.co.jp/Ceramy/image/img/A01X/G101/ENG/GCM21BR71H474KA55-01.pdf> 100nF ___ Source: Digikey <https://www.digikey.de/products/en?keywords=490-8051-1-ND> ; Datasheet <https://search.murata.co.jp/Ceramy/image/img/A01X/G101/ENG/GCM21BR72A104KA37-01.pdf> package: C0805K : 220nF ___ Source: Digikey <https://www.digikey.de/products/en?keywords=490-8306-1-ND> ; Datasheet <https://search.murata.co.jp/Ceramy/image/img/A01X/G101/ENG/GRM21AR72A224KAC5-01.pdf> package: C1206 : 10µF ___ Source: Digikey <https://www.digikey.de/products/en?keywords=490-14746-1-ND> ; Datasheet <https://search.murata.co.jp/Ceramy/image/img/A01X/G101/ENG/GCM31CR71C106KA64-01.pdf> 2.2µF ___ Source: Digikey <https://www.digikey.de/products/en?keywords=490-11169-1-ND> ; Datasheet <https://search.murata.co.jp/Ceramy/image/img/A01X/G101/ENG/GCM31CR71H225KA55-01.pdf> package: C1206 : 2220nF ___ Source: Digikey <https://www.digikey.de/products/en?keywords=490-4975-1-ND> ; Datasheet <https://search.murata.co.jp/Ceramy/image/img/A01X/G101/ENG/GCM31MR72A224KA37-01.pdf>; CAPACITANCE: 470pF; DIGIKEY: 490-4913-1-ND; TOLERANCE: ±10%; VOLTAGE: 50V
C20 C21 = msrm:GCM?5C*: Multilayer Ceramic Capacitors Chip Multilayer Ceramic Capacitors for Automotive -55°C to 125°C Part Numbering <https://search.murata.co.jp/Ceramy/image/img/A01X/partnumbering_e_02.pdf> package: C0402 : 8.2pF ___ Source: Digikey <https://www.digikey.de/products/en?keywords=490-14426-6-ND> ; Datasheet <https://search.murata.co.jp/Ceramy/image/img/A01X/G101/ENG/GCM1555C1H8R2BA16-01.pdf> 10pF ___ Source: Digikey <https://www.digikey.de/products/en?keywords=490-10668-1-ND> ; Datasheet <https://www.murata.com/-/media/webrenewal/support/library/catalog/products/capacitor/ceramiccapacitor/c03e.ashx?la=en-us&cvid=20200707014404000000> 100pF___ Source: Digikey <https://www.digikey.de/products/en?keywords=490-10669-1-ND> ; Datasheet <https://www.murata.com/-/media/webrenewal/support/library/catalog/products/capacitor/ceramiccapacitor/c03e.ashx?la=en-us&cvid=20200707014404000000> 1000pF ___ Source: Digikey <https://www.digikey.de/products/en?keywords=490-16461-1-ND> ; Datasheet <https://search.murata.co.jp/Ceramy/image/img/A01X/G101/ENG/GCM1555C1H102FA16-01.pdf> 15pF_1% ___ Source: Digikey <https://www.digikey.de/products/en?keywords=490-14350-1-ND> ; Datasheet <https://search.murata.co.jp/Ceramy/image/img/A01X/G101/ENG/GCM1555C1H150FA16-01.pdf> 15pF_5% ___ Source: Digikey <https://www.digikey.de/products/en?keywords=490-11147-1-ND> ; Datasheet <https://www.murata.com/-/media/webrenewal/support/library/catalog/products/capacitor/ceramiccapacitor/c03e.ashx?la=en-us&cvid=20200707014404000000> 18pF ___ Source: Digikey <https://www.digikey.de/products/en?keywords=490-12650-1-ND> ; Datasheet <https://www.murata.com/-/media/webrenewal/support/library/catalog/products/capacitor/ceramiccapacitor/c03e.ashx?la=en-us&cvid=20200707014404000000> 22pF ___ Source: Digikey <https://www.digikey.de/products/en?keywords=490-9648-1-ND> ; Datasheet <https://search.murata.co.jp/Ceramy/image/img/A01X/G101/ENG/GCM1555C1H220JA16-01.pdf> 51pF ___ Source: Digikey <https://www.digikey.de/products/en?keywords=490-5944-1-ND> ; Datasheet <https://search.murata.co.jp/Ceramy/image/img/A01X/G101/ENG/GRM1555C1H510JA01-01.pdf> 680pF ___ Source: Digikey <https://www.digikey.de/products/en?keywords=490-16439-1-ND> ; Datasheet <https://search.murata.co.jp/Ceramy/image/img/A01X/G101/ENG/GCM1555C1H681FA16-01.pdf>; CAPACITANCE: 18pF; DIGIKEY: 490-12650-1-ND; TOLERANCE: ±5%; VOLTAGE: 50V
C23-C30 = msrm:GCM?5C*: Multilayer Ceramic Capacitors Chip Multilayer Ceramic Capacitors for Automotive -55°C to 125°C Part Numbering <https://search.murata.co.jp/Ceramy/image/img/A01X/partnumbering_e_02.pdf> package: C0402 : 8.2pF ___ Source: Digikey <https://www.digikey.de/products/en?keywords=490-14426-6-ND> ; Datasheet <https://search.murata.co.jp/Ceramy/image/img/A01X/G101/ENG/GCM1555C1H8R2BA16-01.pdf> 10pF ___ Source: Digikey <https://www.digikey.de/products/en?keywords=490-10668-1-ND> ; Datasheet <https://www.murata.com/-/media/webrenewal/support/library/catalog/products/capacitor/ceramiccapacitor/c03e.ashx?la=en-us&cvid=20200707014404000000> 100pF___ Source: Digikey <https://www.digikey.de/products/en?keywords=490-10669-1-ND> ; Datasheet <https://www.murata.com/-/media/webrenewal/support/library/catalog/products/capacitor/ceramiccapacitor/c03e.ashx?la=en-us&cvid=20200707014404000000> 1000pF ___ Source: Digikey <https://www.digikey.de/products/en?keywords=490-16461-1-ND> ; Datasheet <https://search.murata.co.jp/Ceramy/image/img/A01X/G101/ENG/GCM1555C1H102FA16-01.pdf> 15pF_1% ___ Source: Digikey <https://www.digikey.de/products/en?keywords=490-14350-1-ND> ; Datasheet <https://search.murata.co.jp/Ceramy/image/img/A01X/G101/ENG/GCM1555C1H150FA16-01.pdf> 15pF_5% ___ Source: Digikey <https://www.digikey.de/products/en?keywords=490-11147-1-ND> ; Datasheet <https://www.murata.com/-/media/webrenewal/support/library/catalog/products/capacitor/ceramiccapacitor/c03e.ashx?la=en-us&cvid=20200707014404000000> 18pF ___ Source: Digikey <https://www.digikey.de/products/en?keywords=490-12650-1-ND> ; Datasheet <https://www.murata.com/-/media/webrenewal/support/library/catalog/products/capacitor/ceramiccapacitor/c03e.ashx?la=en-us&cvid=20200707014404000000> 22pF ___ Source: Digikey <https://www.digikey.de/products/en?keywords=490-9648-1-ND> ; Datasheet <https://search.murata.co.jp/Ceramy/image/img/A01X/G101/ENG/GCM1555C1H220JA16-01.pdf> 51pF ___ Source: Digikey <https://www.digikey.de/products/en?keywords=490-5944-1-ND> ; Datasheet <https://search.murata.co.jp/Ceramy/image/img/A01X/G101/ENG/GRM1555C1H510JA01-01.pdf> 680pF ___ Source: Digikey <https://www.digikey.de/products/en?keywords=490-16439-1-ND> ; Datasheet <https://search.murata.co.jp/Ceramy/image/img/A01X/G101/ENG/GCM1555C1H681FA16-01.pdf>; CAPACITANCE: 10pF; DIGIKEY: 490-10668-1-ND; TOLERANCE: ±5%; VOLTAGE: 50V
C31 C32 = msrm:GCM?R7*: Multilayer Ceramic Capacitors Chip Multilayer Ceramic Capacitors for Automotive –55 to 125°C Sources: Catalogue <https://www.murata.com/~/media/webrenewal/support/library/catalog/products/capacitor/mlcc/c03e.ashx?la=en-us> Part Numbering <https://search.murata.co.jp/Ceramy/image/img/A01X/partnumbering_e_02.pdf> package: C0201 : 470pF ___ Source: Digikey <https://www.digikey.de/products/en?keywords=490-17744-1-ND> ; Datasheet <https://search.murata.co.jp/Ceramy/image/img/A01X/G101/ENG/GCM033R71E471KA03-01.pdf> package: C0402 : 100nF ___ Source: Digikey <https://www.digikey.de/products/en?keywords=490-16433-1-ND> ; Datasheet <https://search.murata.co.jp/Ceramy/image/img/A01X/G101/ENG/GCM155R71C104JA55-01.pdf> 220nF ___ Source: Digikey <https://www.digikey.de/products/en?keywords=490-10671-1-ND> ; Datasheet <https://www.murata.com/-/media/webrenewal/support/library/catalog/products/capacitor/ceramiccapacitor/c03e.ashx?la=en-us&cvid=20200707014404000000> 6.8nF ___ Source: Digikey <https://www.digikey.de/products/en?keywords=490-12655-1-ND> ; Datasheet <https://search.murata.co.jp/Ceramy/image/img/A01X/G101/ENG/GCM155R71C683KA55-01.pdf> 10nF ___ Source: Digikey <https://www.digikey.de/products/en?keywords=490-6043-1-ND> ; Datasheet <https://search.murata.co.jp/Ceramy/image/img/A01X/G101/ENG/GCM155R71E103KA37-01.pdf> 22nF ___ Source: Digikey <https://www.digikey.de/products/en?keywords=490-6044-1-ND> ; Datasheet <https://search.murata.co.jp/Ceramy/image/img/A01X/G101/ENG/GCM155R71E223KA55-01.pdf> 470pF ___ Source: Digikey <https://www.digikey.de/products/en?keywords=490-4913-1-ND> ; Datasheet <https://search.murata.co.jp/Ceramy/image/img/A01X/G101/ENG/GCM155R71H471KA37-01.pdf> package: C0603 : 1µF ___ Source: Digikey <https://www.digikey.de/products/en?keywords=490-5241-1-ND> ; Datasheet <https://www.murata.com/-/media/webrenewal/support/library/catalog/products/capacitor/ceramiccapacitor/c03e.ashx?la=en-us&cvid=20200707014404000000> 470nF ___ Source: Digikey <https://www.digikey.de/products/en?keywords=490-12589-1-ND> ; Datasheet <https://search.murata.co.jp/Ceramy/image/img/A01X/G101/ENG/GCM188R71C474KA55-01.pdf> 10nF ___ Source: Digikey <https://www.digikey.de/products/en?keywords=490-4781-1-ND> ; Datasheet <https://search.murata.co.jp/Ceramy/image/img/A01X/G101/ENG/GCM188R72A103KA37-01.pdf> 22nF ___ Source: Digikey <https://www.digikey.de/products/en?keywords=490-4782-1-ND> ; Datasheet <https://www.murata.com/-/media/webrenewal/support/library/catalog/products/capacitor/ceramiccapacitor/c03e.ashx?la=en-us&cvid=20200707014404000000> package: C0805 : 10µF ___ Source: Digikey <https://www.digikey.de/products/en?keywords=490-14361-1-ND> ; Datasheet <https://search.murata.co.jp/Ceramy/image/img/A01X/G101/ENG/GCM21BR70J106KE22-01.pdf> 2.2µF ___ Source: Digikey <https://www.digikey.de/products/en?keywords=490-4786-1-ND> ; Datasheet <https://search.murata.co.jp/Ceramy/image/img/A01X/G101/ENG/GCM21BR71C225KA64-01.pdf> 470nF ___ Source: Digikey <https://www.digikey.de/products/en?keywords=490-4788-1-ND> ; Datasheet <https://search.murata.co.jp/Ceramy/image/img/A01X/G101/ENG/GCM21BR71H474KA55-01.pdf> 100nF ___ Source: Digikey <https://www.digikey.de/products/en?keywords=490-8051-1-ND> ; Datasheet <https://search.murata.co.jp/Ceramy/image/img/A01X/G101/ENG/GCM21BR72A104KA37-01.pdf> package: C0805K : 220nF ___ Source: Digikey <https://www.digikey.de/products/en?keywords=490-8306-1-ND> ; Datasheet <https://search.murata.co.jp/Ceramy/image/img/A01X/G101/ENG/GRM21AR72A224KAC5-01.pdf> package: C1206 : 10µF ___ Source: Digikey <https://www.digikey.de/products/en?keywords=490-14746-1-ND> ; Datasheet <https://search.murata.co.jp/Ceramy/image/img/A01X/G101/ENG/GCM31CR71C106KA64-01.pdf> 2.2µF ___ Source: Digikey <https://www.digikey.de/products/en?keywords=490-11169-1-ND> ; Datasheet <https://search.murata.co.jp/Ceramy/image/img/A01X/G101/ENG/GCM31CR71H225KA55-01.pdf> package: C1206 : 2220nF ___ Source: Digikey <https://www.digikey.de/products/en?keywords=490-4975-1-ND> ; Datasheet <https://search.murata.co.jp/Ceramy/image/img/A01X/G101/ENG/GCM31MR72A224KA37-01.pdf>; CAPACITANCE: 22nF; DIGIKEY: 490-6044-1-ND; TOLERANCE: ±10%; VOLTAGE: 25V
C33 = msrm:GRM?C8*: CAP CER 10UF 6.3V X6S 0402 package: C0402 : 10µF ___ Source: Digikey <https://www.digikey.de/products/en?keywords=490-13233-1-ND> ; Datasheet <https://search.murata.co.jp/Ceramy/image/img/A01X/G101/ENG/GRM155C80J106ME11-01.pdf> 2.2µF ___ Source: Digikey <https://www.digikey.de/products/en?keywords=490-10012-1-ND> ; Datasheet <https://search.murata.co.jp/Ceramy/image/img/A01X/G101/ENG/GRM155C80J225KE95-01.pdf> 4.7µF ___ Source: Digikey <https://www.digikey.de/products/en?keywords=490-14458-1-ND> ; Datasheet <https://search.murata.co.jp/Ceramy/image/img/A01X/G101/ENG/GRM155C80J475MEAA-01.pdf>; CAPACITANCE: 10uF; DIGIKEY: 490-13233-1-ND; TOLERANCE: ±20%; VOLTAGE: 6.3V
D1-D3 = msrm:QBLP595-: LED 0402 SMD, 2V package: 0402 : Yellow-Green ___ Source: Digikey <https://www.digikey.de/product-detail/en/qt-brightek-qtb/QBLP595-AG/1516-1218-1-ND/6201915> ; Datasheet <http://www.qt-brightek.com/datasheet/QBLP595%20Series.pdf> Blue ___ Source: Digikey <https://www.digikey.de/product-detail/en/qt-brightek-qtb/QBLP595-IB/1516-1215-1-ND/6201912> ; Datasheet <http://www.qt-brightek.com/datasheet/QBLP595%20Series.pdf> Green ___ Source: Digikey <https://www.digikey.de/product-detail/en/qt-brightek-qtb/QBLP595-IG/1516-1216-1-ND/6201913> ; Datasheet <http://www.qt-brightek.com/datasheet/QBLP595%20Series.pdf> Orange ___ Source: Digikey <https://www.digikey.de/product-detail/en/qt-brightek-qtb/QBLP595-O/1516-1220-1-ND/6201917> ; Datasheet <http://www.qt-brightek.com/datasheet/QBLP595%20Series.pdf> Red ___ Source: Digikey <https://www.digikey.de/product-detail/en/qt-brightek-qtb/QBLP595-R/1516-1217-1-ND/6201914> ; Datasheet <http://www.qt-brightek.com/datasheet/QBLP595%20Series.pdf> Yellow ___ Source: Digikey <https://www.digikey.de/product-detail/en/qt-brightek-qtb/QBLP595-Y/1516-1219-1-ND/6201916> ; Datasheet <http://www.qt-brightek.com/datasheet/QBLP595%20Series.pdf>; COLOR: Green; DIGIKEY: 1516-1216-1-ND
IC1 = msrm:CAT24C512?: EEPROM Memory IC 512Kb (64K x 8) I²C 1MHz 400ns Source: Datasheet <http://www.onsemi.com/pub/Collateral/CAT24C512-D.PDF> package: UDFN8 : CAT24C512 ___ Source: Digikey <https://www.digikey.de/products/en?keywords=CAT24C512HU5IGT3OSCT> ; Datasheet <http://www.onsemi.com/pub/Collateral/CAT24C512-D.PDF>; DIGIKEY: CAT24C512HU5IGT3OSCT-ND; LEAD_FINISH: NiPdAu; TEMPERATURE: -40°C ~ 85°C
IC2 = msrm:RP115H*-T1-FE: Linear Voltage Regulator IC 1 Output 1A SOT-89-5 package: SOT-89-5 : H331B ___ Source: Digikey <https://www.digikey.de/products/en?keywords=RP115H331B-T1-FE> ; Datasheet <https://www.n-redc.co.jp/en/pdf/datasheet/rp115-ea.pdf> H331D ___ Source: Digikey <https://www.digikey.de/product-detail/en/ricoh-electronic-devices-co-ltd/RP115H331D-T1-FE/2129-RP115H331D-T1-FECT-ND/11569386> ; Datasheet <https://www.n-redc.co.jp/en/pdf/datasheet/rp115-ea.pdf>; DIGIKEY: RP115H331B-T1-FE-ND; VOLTAGE: 3.3V
L1-L5 = msrm:BLM?EG*1D: Murata's SMD Ferrite Bead BLM18EG Series Productdata: Part Numbering <https://www.murata.com/en-us/products/productdata/8796733767710/S0580E.pdf> package: 0402 : 220 Ohms @ 100MHz ___ Source: Digikey <https://www.digikey.de/products/en?keywords=490-17345-1-ND> ; Datasheet <https://www.murata.com/en-us/products/productdata/8799741607966/QNFA9136.pdf> package: 0603 : 100 Ohms @ 100MHz ___ Source: Digikey <https://www.digikey.de/products/en?keywords=490-5978-1-ND> ; Datasheet <https://www.murata.com/en-us/products/productdata/8796747366430/ENFA0021.pdf> 120 Ohms @ 100MHz___ Source: Digikey <https://www.digikey.de/products/en?keywords=490-3991-1-ND> ; Datasheet <https://www.murata.com/en-us/products/productdata/8796747366430/ENFA0021.pdf> 220 Ohms @ 100MHz ___ Source: Digikey <https://www.digikey.de/products/en?keywords=490-3992-6-ND> ; Datasheet <https://www.murata.com/en-us/products/productdata/8796747366430/ENFA0021.pdf> 220 Ohms @ 100MHz ___ Source: Digikey <https://www.digikey.de/products/en?keywords=490-5979-1-ND> ; Datasheet <https://www.murata.com/en-us/products/productdata/8796747366430/ENFA0021.pdf> 330 Ohms @ 100MHz ___ Source: Digikey <https://www.digikey.de/products/en?keywords=490-5913-1-ND> ; Datasheet <https://www.murata.com/en-us/products/productdata/8796747366430/ENFA0021.pdf> 390 Ohms @ 100MHz ___ Source: Digikey <https://www.digikey.de/products/en?keywords=490-5980-2-ND> ; Datasheet <https://www.murata.com/en-us/products/productdata/8796747366430/ENFA0021.pdf> 470 Ohms @ 100MHz ___ Source: Digikey <https://www.digikey.de/products/en?keywords=490-3993-1-ND> ; Datasheet <https://www.murata.com/en-us/products/productdata/8796747366430/ENFA0021.pdf> 600 Ohms @ 100MHz ___ Source: Digikey <https://www.digikey.de/products/en?keywords=490-3994-1-ND> ; Datasheet <https://www.murata.com/en-us/products/productdata/8796747366430/ENFA0021.pdf>; DC_RES: 280mOhm; DIGIKEY: 490-17345-1-ND; IMPEDANCE-FREQUENCY: 220 Ohms @ 100MHz
R1 R16 R17 = msrm:RT?FRE07*L: SMD RESISTOR ± 1% Tol, Paper/PE taping reel, 50 ppm/°C, 7 inch dia. Reel Datasheet <http://www.yageo.com/documents/recent/PYu-RT_1-to-0.01_RoHS_L_11.pdf> package: 0201 : 0R ___ Source: Digikey <https://www.digikey.de/products/en?keywords=311-0.0MCT-ND> 1k ___ Source: Digikey <https://www.digikey.de/products/en?keywords=RT0201FRE071KL-ND> 10k ___ Source: Digikey <https://www.digikey.de/products/en?keywords=RT0201FRE0710KL-ND> 100 ___ Source: Digikey <https://www.digikey.de/products/en?keywords=RT0201FRE07100RL-ND> 330 ___ Source: Digikey <https://www.digikey.de/products/en?keywords=RT0201FRE07330RL-ND> package: 0402 : 0R ___ Source: Digikey <https://www.digikey.de/products/en?keywords=311-0.0LRCT-ND> 1k ___ Source: Digikey <https://www.digikey.de/products/en?keywords=%20YAG1234CT-ND> 2k2 ___ Source: Digikey <https://www.digikey.de/products/en?keywords=RT0402FRE072K2L-ND> 2k ___ Source: Digikey <https://www.digikey.de/products/en?keywords=YAG3345CT-ND> 4k7 ___ Source: Digikey <https://www.digikey.de/products/en?keywords=YAG3347CT-ND%20> 10k ___ Source: Digikey <https://www.digikey.de/products/en?keywords=YAG1233CT-ND> 12k1 ___ Source: Digikey <https://www.digikey.de/products/en?keywords=RT0402FRE0712K1L-ND> 49R9 ___ Source: Digikey <https://www.digikey.de/products/en?keywords=YAG3346CT-ND> 56k ___ Source: Digikey <https://www.digikey.de/products/en?keywords=RT0402FRE0756K2L-ND> 100k ___ Source: Digikey <https://www.digikey.de/products/en?keywords=YAG2307CT-ND> 100 ___ Source: Digikey <https://www.digikey.de/products/en?keywords=YAG3342CT-ND> 150 ___ Source: Digikey <https://www.digikey.de/product-detail/en/yageo/RT0402FRE07150RL/13-RT0402FRE07150RLCT-ND/12705162> 300 ___ Source: Digikey <https://www.digikey.de/products/en?keywords=RT0402FRE07300RL-ND> package: 0603 : 0R ___ Source: Digikey <https://www.digikey.de/products/en?keywords=311-0.0HRCT-ND> 1k ___ Source: Digikey <https://www.digikey.de/products/en?keywords=YAG2323CT-ND> 10k ___ Source: Digikey <https://www.digikey.de/products/en?keywords=YAG2321CT-ND> 100k ___ Source: Digikey <https://www.digikey.de/products/en?keywords=YAG2319CT-ND> 100 ___ Source: Digikey <https://www.digikey.de/products/en?keywords=YAG2320CT-ND> 300 ___ Source: Digikey <https://www.digikey.de/products/en?keywords=RT0603FRE07300RL-ND> 330 ___ Source: Digikey <https://www.digikey.de/products/en?keywords=YAG5957CT-ND>; DIGIKEY: 311-0.0LRCT-ND; NOTES: Actual Part Number: RC0402FR-070RL; RVALUE: 0R; SPICEPREFIX: R
R2 = msrm:RT?FRE07*L: SMD RESISTOR ± 1% Tol, Paper/PE taping reel, 50 ppm/°C, 7 inch dia. Reel Datasheet <http://www.yageo.com/documents/recent/PYu-RT_1-to-0.01_RoHS_L_11.pdf> package: 0201 : 0R ___ Source: Digikey <https://www.digikey.de/products/en?keywords=311-0.0MCT-ND> 1k ___ Source: Digikey <https://www.digikey.de/products/en?keywords=RT0201FRE071KL-ND> 10k ___ Source: Digikey <https://www.digikey.de/products/en?keywords=RT0201FRE0710KL-ND> 100 ___ Source: Digikey <https://www.digikey.de/products/en?keywords=RT0201FRE07100RL-ND> 330 ___ Source: Digikey <https://www.digikey.de/products/en?keywords=RT0201FRE07330RL-ND> package: 0402 : 0R ___ Source: Digikey <https://www.digikey.de/products/en?keywords=311-0.0LRCT-ND> 1k ___ Source: Digikey <https://www.digikey.de/products/en?keywords=%20YAG1234CT-ND> 2k2 ___ Source: Digikey <https://www.digikey.de/products/en?keywords=RT0402FRE072K2L-ND> 2k ___ Source: Digikey <https://www.digikey.de/products/en?keywords=YAG3345CT-ND> 4k7 ___ Source: Digikey <https://www.digikey.de/products/en?keywords=YAG3347CT-ND%20> 10k ___ Source: Digikey <https://www.digikey.de/products/en?keywords=YAG1233CT-ND> 12k1 ___ Source: Digikey <https://www.digikey.de/products/en?keywords=RT0402FRE0712K1L-ND> 49R9 ___ Source: Digikey <https://www.digikey.de/products/en?keywords=YAG3346CT-ND> 56k ___ Source: Digikey <https://www.digikey.de/products/en?keywords=RT0402FRE0756K2L-ND> 100k ___ Source: Digikey <https://www.digikey.de/products/en?keywords=YAG2307CT-ND> 100 ___ Source: Digikey <https://www.digikey.de/products/en?keywords=YAG3342CT-ND> 150 ___ Source: Digikey <https://www.digikey.de/product-detail/en/yageo/RT0402FRE07150RL/13-RT0402FRE07150RLCT-ND/12705162> 300 ___ Source: Digikey <https://www.digikey.de/products/en?keywords=RT0402FRE07300RL-ND> package: 0603 : 0R ___ Source: Digikey <https://www.digikey.de/products/en?keywords=311-0.0HRCT-ND> 1k ___ Source: Digikey <https://www.digikey.de/products/en?keywords=YAG2323CT-ND> 10k ___ Source: Digikey <https://www.digikey.de/products/en?keywords=YAG2321CT-ND> 100k ___ Source: Digikey <https://www.digikey.de/products/en?keywords=YAG2319CT-ND> 100 ___ Source: Digikey <https://www.digikey.de/products/en?keywords=YAG2320CT-ND> 300 ___ Source: Digikey <https://www.digikey.de/products/en?keywords=RT0603FRE07300RL-ND> 330 ___ Source: Digikey <https://www.digikey.de/products/en?keywords=YAG5957CT-ND>; DIGIKEY: RT0402FRE0712K1L-ND; RVALUE: 12k1; SPICEPREFIX: R
R4 R5 = msrm:RT?FRE07*L: SMD RESISTOR ± 1% Tol, Paper/PE taping reel, 50 ppm/°C, 7 inch dia. Reel Datasheet <http://www.yageo.com/documents/recent/PYu-RT_1-to-0.01_RoHS_L_11.pdf> package: 0201 : 0R ___ Source: Digikey <https://www.digikey.de/products/en?keywords=311-0.0MCT-ND> 1k ___ Source: Digikey <https://www.digikey.de/products/en?keywords=RT0201FRE071KL-ND> 10k ___ Source: Digikey <https://www.digikey.de/products/en?keywords=RT0201FRE0710KL-ND> 100 ___ Source: Digikey <https://www.digikey.de/products/en?keywords=RT0201FRE07100RL-ND> 330 ___ Source: Digikey <https://www.digikey.de/products/en?keywords=RT0201FRE07330RL-ND> package: 0402 : 0R ___ Source: Digikey <https://www.digikey.de/products/en?keywords=311-0.0LRCT-ND> 1k ___ Source: Digikey <https://www.digikey.de/products/en?keywords=%20YAG1234CT-ND> 2k2 ___ Source: Digikey <https://www.digikey.de/products/en?keywords=RT0402FRE072K2L-ND> 2k ___ Source: Digikey <https://www.digikey.de/products/en?keywords=YAG3345CT-ND> 4k7 ___ Source: Digikey <https://www.digikey.de/products/en?keywords=YAG3347CT-ND%20> 10k ___ Source: Digikey <https://www.digikey.de/products/en?keywords=YAG1233CT-ND> 12k1 ___ Source: Digikey <https://www.digikey.de/products/en?keywords=RT0402FRE0712K1L-ND> 49R9 ___ Source: Digikey <https://www.digikey.de/products/en?keywords=YAG3346CT-ND> 56k ___ Source: Digikey <https://www.digikey.de/products/en?keywords=RT0402FRE0756K2L-ND> 100k ___ Source: Digikey <https://www.digikey.de/products/en?keywords=YAG2307CT-ND> 100 ___ Source: Digikey <https://www.digikey.de/products/en?keywords=YAG3342CT-ND> 150 ___ Source: Digikey <https://www.digikey.de/product-detail/en/yageo/RT0402FRE07150RL/13-RT0402FRE07150RLCT-ND/12705162> 300 ___ Source: Digikey <https://www.digikey.de/products/en?keywords=RT0402FRE07300RL-ND> package: 0603 : 0R ___ Source: Digikey <https://www.digikey.de/products/en?keywords=311-0.0HRCT-ND> 1k ___ Source: Digikey <https://www.digikey.de/products/en?keywords=YAG2323CT-ND> 10k ___ Source: Digikey <https://www.digikey.de/products/en?keywords=YAG2321CT-ND> 100k ___ Source: Digikey <https://www.digikey.de/products/en?keywords=YAG2319CT-ND> 100 ___ Source: Digikey <https://www.digikey.de/products/en?keywords=YAG2320CT-ND> 300 ___ Source: Digikey <https://www.digikey.de/products/en?keywords=RT0603FRE07300RL-ND> 330 ___ Source: Digikey <https://www.digikey.de/products/en?keywords=YAG5957CT-ND>; DIGIKEY: YAG3347CT-ND; RVALUE: 4k7; SPICEPREFIX: R
R6 R7 R24-R27 = msrm:RT?FRE07*L: SMD RESISTOR ± 1% Tol, Paper/PE taping reel, 50 ppm/°C, 7 inch dia. Reel Datasheet <http://www.yageo.com/documents/recent/PYu-RT_1-to-0.01_RoHS_L_11.pdf> package: 0201 : 0R ___ Source: Digikey <https://www.digikey.de/products/en?keywords=311-0.0MCT-ND> 1k ___ Source: Digikey <https://www.digikey.de/products/en?keywords=RT0201FRE071KL-ND> 10k ___ Source: Digikey <https://www.digikey.de/products/en?keywords=RT0201FRE0710KL-ND> 100 ___ Source: Digikey <https://www.digikey.de/products/en?keywords=RT0201FRE07100RL-ND> 330 ___ Source: Digikey <https://www.digikey.de/products/en?keywords=RT0201FRE07330RL-ND> package: 0402 : 0R ___ Source: Digikey <https://www.digikey.de/products/en?keywords=311-0.0LRCT-ND> 1k ___ Source: Digikey <https://www.digikey.de/products/en?keywords=%20YAG1234CT-ND> 2k2 ___ Source: Digikey <https://www.digikey.de/products/en?keywords=RT0402FRE072K2L-ND> 2k ___ Source: Digikey <https://www.digikey.de/products/en?keywords=YAG3345CT-ND> 4k7 ___ Source: Digikey <https://www.digikey.de/products/en?keywords=YAG3347CT-ND%20> 10k ___ Source: Digikey <https://www.digikey.de/products/en?keywords=YAG1233CT-ND> 12k1 ___ Source: Digikey <https://www.digikey.de/products/en?keywords=RT0402FRE0712K1L-ND> 49R9 ___ Source: Digikey <https://www.digikey.de/products/en?keywords=YAG3346CT-ND> 56k ___ Source: Digikey <https://www.digikey.de/products/en?keywords=RT0402FRE0756K2L-ND> 100k ___ Source: Digikey <https://www.digikey.de/products/en?keywords=YAG2307CT-ND> 100 ___ Source: Digikey <https://www.digikey.de/products/en?keywords=YAG3342CT-ND> 150 ___ Source: Digikey <https://www.digikey.de/product-detail/en/yageo/RT0402FRE07150RL/13-RT0402FRE07150RLCT-ND/12705162> 300 ___ Source: Digikey <https://www.digikey.de/products/en?keywords=RT0402FRE07300RL-ND> package: 0603 : 0R ___ Source: Digikey <https://www.digikey.de/products/en?keywords=311-0.0HRCT-ND> 1k ___ Source: Digikey <https://www.digikey.de/products/en?keywords=YAG2323CT-ND> 10k ___ Source: Digikey <https://www.digikey.de/products/en?keywords=YAG2321CT-ND> 100k ___ Source: Digikey <https://www.digikey.de/products/en?keywords=YAG2319CT-ND> 100 ___ Source: Digikey <https://www.digikey.de/products/en?keywords=YAG2320CT-ND> 300 ___ Source: Digikey <https://www.digikey.de/products/en?keywords=RT0603FRE07300RL-ND> 330 ___ Source: Digikey <https://www.digikey.de/products/en?keywords=YAG5957CT-ND>; DIGIKEY: YAG1233CT-ND; RVALUE: 10k; SPICEPREFIX: R
R8-R15 = msrm:RT?FRE07*L: SMD RESISTOR ± 1% Tol, Paper/PE taping reel, 50 ppm/°C, 7 inch dia. Reel Datasheet <http://www.yageo.com/documents/recent/PYu-RT_1-to-0.01_RoHS_L_11.pdf> package: 0201 : 0R ___ Source: Digikey <https://www.digikey.de/products/en?keywords=311-0.0MCT-ND> 1k ___ Source: Digikey <https://www.digikey.de/products/en?keywords=RT0201FRE071KL-ND> 10k ___ Source: Digikey <https://www.digikey.de/products/en?keywords=RT0201FRE0710KL-ND> 100 ___ Source: Digikey <https://www.digikey.de/products/en?keywords=RT0201FRE07100RL-ND> 330 ___ Source: Digikey <https://www.digikey.de/products/en?keywords=RT0201FRE07330RL-ND> package: 0402 : 0R ___ Source: Digikey <https://www.digikey.de/products/en?keywords=311-0.0LRCT-ND> 1k ___ Source: Digikey <https://www.digikey.de/products/en?keywords=%20YAG1234CT-ND> 2k2 ___ Source: Digikey <https://www.digikey.de/products/en?keywords=RT0402FRE072K2L-ND> 2k ___ Source: Digikey <https://www.digikey.de/products/en?keywords=YAG3345CT-ND> 4k7 ___ Source: Digikey <https://www.digikey.de/products/en?keywords=YAG3347CT-ND%20> 10k ___ Source: Digikey <https://www.digikey.de/products/en?keywords=YAG1233CT-ND> 12k1 ___ Source: Digikey <https://www.digikey.de/products/en?keywords=RT0402FRE0712K1L-ND> 49R9 ___ Source: Digikey <https://www.digikey.de/products/en?keywords=YAG3346CT-ND> 56k ___ Source: Digikey <https://www.digikey.de/products/en?keywords=RT0402FRE0756K2L-ND> 100k ___ Source: Digikey <https://www.digikey.de/products/en?keywords=YAG2307CT-ND> 100 ___ Source: Digikey <https://www.digikey.de/products/en?keywords=YAG3342CT-ND> 150 ___ Source: Digikey <https://www.digikey.de/product-detail/en/yageo/RT0402FRE07150RL/13-RT0402FRE07150RLCT-ND/12705162> 300 ___ Source: Digikey <https://www.digikey.de/products/en?keywords=RT0402FRE07300RL-ND> package: 0603 : 0R ___ Source: Digikey <https://www.digikey.de/products/en?keywords=311-0.0HRCT-ND> 1k ___ Source: Digikey <https://www.digikey.de/products/en?keywords=YAG2323CT-ND> 10k ___ Source: Digikey <https://www.digikey.de/products/en?keywords=YAG2321CT-ND> 100k ___ Source: Digikey <https://www.digikey.de/products/en?keywords=YAG2319CT-ND> 100 ___ Source: Digikey <https://www.digikey.de/products/en?keywords=YAG2320CT-ND> 300 ___ Source: Digikey <https://www.digikey.de/products/en?keywords=RT0603FRE07300RL-ND> 330 ___ Source: Digikey <https://www.digikey.de/products/en?keywords=YAG5957CT-ND>; DIGIKEY: YAG3346CT-ND; RVALUE: 49R9; SPICEPREFIX: R
R18-R23 = msrm:RT?FRE07*L: SMD RESISTOR ± 1% Tol, Paper/PE taping reel, 50 ppm/°C, 7 inch dia. Reel Datasheet <http://www.yageo.com/documents/recent/PYu-RT_1-to-0.01_RoHS_L_11.pdf> package: 0201 : 0R ___ Source: Digikey <https://www.digikey.de/products/en?keywords=311-0.0MCT-ND> 1k ___ Source: Digikey <https://www.digikey.de/products/en?keywords=RT0201FRE071KL-ND> 10k ___ Source: Digikey <https://www.digikey.de/products/en?keywords=RT0201FRE0710KL-ND> 100 ___ Source: Digikey <https://www.digikey.de/products/en?keywords=RT0201FRE07100RL-ND> 330 ___ Source: Digikey <https://www.digikey.de/products/en?keywords=RT0201FRE07330RL-ND> package: 0402 : 0R ___ Source: Digikey <https://www.digikey.de/products/en?keywords=311-0.0LRCT-ND> 1k ___ Source: Digikey <https://www.digikey.de/products/en?keywords=%20YAG1234CT-ND> 2k2 ___ Source: Digikey <https://www.digikey.de/products/en?keywords=RT0402FRE072K2L-ND> 2k ___ Source: Digikey <https://www.digikey.de/products/en?keywords=YAG3345CT-ND> 4k7 ___ Source: Digikey <https://www.digikey.de/products/en?keywords=YAG3347CT-ND%20> 10k ___ Source: Digikey <https://www.digikey.de/products/en?keywords=YAG1233CT-ND> 12k1 ___ Source: Digikey <https://www.digikey.de/products/en?keywords=RT0402FRE0712K1L-ND> 49R9 ___ Source: Digikey <https://www.digikey.de/products/en?keywords=YAG3346CT-ND> 56k ___ Source: Digikey <https://www.digikey.de/products/en?keywords=RT0402FRE0756K2L-ND> 100k ___ Source: Digikey <https://www.digikey.de/products/en?keywords=YAG2307CT-ND> 100 ___ Source: Digikey <https://www.digikey.de/products/en?keywords=YAG3342CT-ND> 150 ___ Source: Digikey <https://www.digikey.de/product-detail/en/yageo/RT0402FRE07150RL/13-RT0402FRE07150RLCT-ND/12705162> 300 ___ Source: Digikey <https://www.digikey.de/products/en?keywords=RT0402FRE07300RL-ND> package: 0603 : 0R ___ Source: Digikey <https://www.digikey.de/products/en?keywords=311-0.0HRCT-ND> 1k ___ Source: Digikey <https://www.digikey.de/products/en?keywords=YAG2323CT-ND> 10k ___ Source: Digikey <https://www.digikey.de/products/en?keywords=YAG2321CT-ND> 100k ___ Source: Digikey <https://www.digikey.de/products/en?keywords=YAG2319CT-ND> 100 ___ Source: Digikey <https://www.digikey.de/products/en?keywords=YAG2320CT-ND> 300 ___ Source: Digikey <https://www.digikey.de/products/en?keywords=RT0603FRE07300RL-ND> 330 ___ Source: Digikey <https://www.digikey.de/products/en?keywords=YAG5957CT-ND>; DIGIKEY: YAG3342CT-ND; RVALUE: 100; SPICEPREFIX: R
T1 T2 = msrm:749020100: TRANSFORMER LAN 350µH LAN 10/100 Base-T, Power over Ethernet (PoE) Pulse Transformer 1:1 Surface Mount Source: Digikey <https://www.digikey.de/products/de?keywords=732-3268-1-ND> ; Datasheet <https://www.we-online.de/katalog/datasheet/749020100.pdf>; DIGIKEY: 732-3268-1-ND
U1 = msrm:LAN9252: 2/3-Port EtherCAT® Slave Controller with Integrated Ethernet PHYs package: QFN64-T600 / ML : LAN9252 ___ Source: Digikey <https://www.digikey.de/products/en?keywords=LAN9252/ML-ND> ; Datasheet <http://www.microchip.com/mymicrochip/filehandler.aspx?ddocname=en573610> LAN9252I ___ Source: Digikey <https://www.digikey.de/products/en?keywords=LAN9252I/ML-ND> ; Datasheet <http://www.microchip.com/mymicrochip/filehandler.aspx?ddocname=en573610> LAN9252T___ Source: Digikey <https://www.digikey.de/products/en?keywords=LAN9252T/ML-ND> ; Datasheet <http://www.microchip.com/mymicrochip/filehandler.aspx?ddocname=en573610> LAN9252TI ___ Source: Digikey <https://www.digikey.de/products/en?keywords=LAN9252TI/ML-ND> ; Datasheet <http://www.microchip.com/mymicrochip/filehandler.aspx?ddocname=en573610> LAN9252TV ___ Source: Digikey <https://www.digikey.de/products/en?keywords=LAN9252TV/ML-ND> ; Datasheet <http://www.microchip.com/mymicrochip/filehandler.aspx?ddocname=en573610> LAN9252V ___ Source: Digikey <https://www.digikey.de/products/en?keywords=LAN9252V/ML-ND> ; Datasheet <http://www.microchip.com/mymicrochip/filehandler.aspx?ddocname=en573610> package: TQFP64-T570 / PT : LAN9252 ___ Source: Digikey <https://www.digikey.de/products/en?keywords=LAN9252/PT-ND> ; Datasheet <http://www.microchip.com/mymicrochip/filehandler.aspx?ddocname=en573610> LAN9252I ___ Source: Digikey <https://www.digikey.de/products/en?keywords=LAN9252I/PT-ND> ; Datasheet <http://www.microchip.com/mymicrochip/filehandler.aspx?ddocname=en573610> LAN9252T ___ Source: Digikey <https://www.digikey.de/products/en?keywords=LAN9252T/PT-ND> ; Datasheet <http://www.microchip.com/mymicrochip/filehandler.aspx?ddocname=en573610> LAN9252TI ___ Source: Digikey <https://www.digikey.de/products/en?keywords=LAN9252TI/PT-ND> ; Datasheet <http://www.microchip.com/mymicrochip/filehandler.aspx?ddocname=en573610>; DIGIKEY: LAN9252/ML-ND; TAPE_AND_REEL: Tray; TEMP: 0°C to 70°C
X1 = msrm:8743?-04*3: Wire-to-Board 1.50mm (.059") Pitch Header - SMT, Shrouded Source: http://www.molex.com/product/micro/87437.html; DIGIKEY: WM7648CT-ND; MF: MOLEX
X3 = msrm:8743?-05*3: Wire-to-Board 1.50mm (.059") Pitch Header -SMT, Shrouded Source: http://www.molex.com/product/micro/87438.html; COLOR: beige; DIGIKEY: WM7649CT-ND
Y1 = msrm:ECS-*?-TR: SMD CRYSTAL Various frequencies, with GND pins Part Numbering <http://www.ecsxtal.com/store/pdf/partnumber4.pdf> package: ECS-33B : XC2845 ___ Source: Digikey <https://www.digikey.de/products/en?keywords=%20XC2845CT-ND> ; Datasheet <https://ecsxtal.com/store/pdf/ECS-33B.pdf> XC2439 ___ Source: Digikey <https://www.digikey.de/products/en?keywords=XC2439CT-ND> ; Datasheet <https://ecsxtal.com/store/pdf/ECS-33B.pdf> XC2458 ___ Source: Digikey <https://www.digikey.de/products/en?keywords=XC2458CT-ND> ; Datasheet <https://ecsxtal.com/store/pdf/ECS-33B.pdf> XC2479 ___ Source: Digikey <https://www.digikey.de/products/en?keywords=XC2479CT-ND> ; Datasheet <https://ecsxtal.com/store/pdf/ECS-33B.pdf> XC2547 ___ Source: Digikey <https://www.digikey.de/products/en?keywords=XC2547CT-ND> ; Datasheet <https://ecsxtal.com/store/pdf/ECS-33B.pdf> package: ECX2236 : XC3046 ___ Source: Digikey <https://www.digikey.de/products/en?keywords=XC3046CT-ND> ; Datasheet <https://ecsxtal.com/store/pdf/ECX-2236B.pdf> XC3048 ___ Source: Digikey <https://www.digikey.de/products/en?keywords=XC3048CT-ND> ; Datasheet <https://ecsxtal.com/store/pdf/ECX-2236B.pdf> XC3051 ___ Source: Digikey <https://www.digikey.de/products/en?keywords=XC3051CT-ND> ; Datasheet <https://ecsxtal.com/store/pdf/ECX-2236B.pdf> XC3093 ___ Source: Digikey <https://www.digikey.de/products/en?keywords=XC3093CT-ND> ; Datasheet <https://ecsxtal.com/store/pdf/ECX-2236B.pdf> XC3053 ___ Source: Digikey <https://www.digikey.de/products/en?keywords=XC3053CT-ND> ; Datasheet <https://ecsxtal.com/store/pdf/ECX-2236B.pdf> XC3052 ___ Source: Digikey <https://www.digikey.de/products/en?keywords=XC3052CT-ND> ; Datasheet <https://ecsxtal.com/store/pdf/ECX-2236B.pdf> XC3054 ___ Source: Digikey <https://www.digikey.de/products/en?keywords=XC3054CT-ND> ; Datasheet <https://ecsxtal.com/store/pdf/ECX-2236B.pdf> XC3057 ___ Source: Digikey <https://www.digikey.de/products/en?keywords=XC3057CT-ND> ; Datasheet <https://ecsxtal.com/store/pdf/ECX-2236B.pdf> XC3058 ___ Source: Digikey <https://www.digikey.de/products/en?keywords=XC3058CT-ND> ; Datasheet <https://ecsxtal.com/store/pdf/ECX-2236B.pdf> XC3060 ___ Source: Digikey <https://www.digikey.de/products/en?keywords=XC3060CT-ND> ; Datasheet <https://ecsxtal.com/store/pdf/ECX-2236B.pdf> XC3059 ___ Source: Digikey <https://www.digikey.de/products/en?keywords=XC3059CT-ND> ; Datasheet <https://ecsxtal.com/store/pdf/ECX-2236B.pdf>; DIGIKEY: XC3051CT-ND; F: 25MHz; F_TOLERANCE: ±10ppm; L_CAPACITANCE: 18pF

## Net classes
0 default: width 0.152 mm, drill 0.2 mm, clearance 0.076 mm
1 power: width 0.229 mm, drill 0.2 mm, clearance 0.152 mm